# EAGLE schematic oresat-backplane (EAGLE 9.1.3)

## Sheet 1 of 20: Slot 1
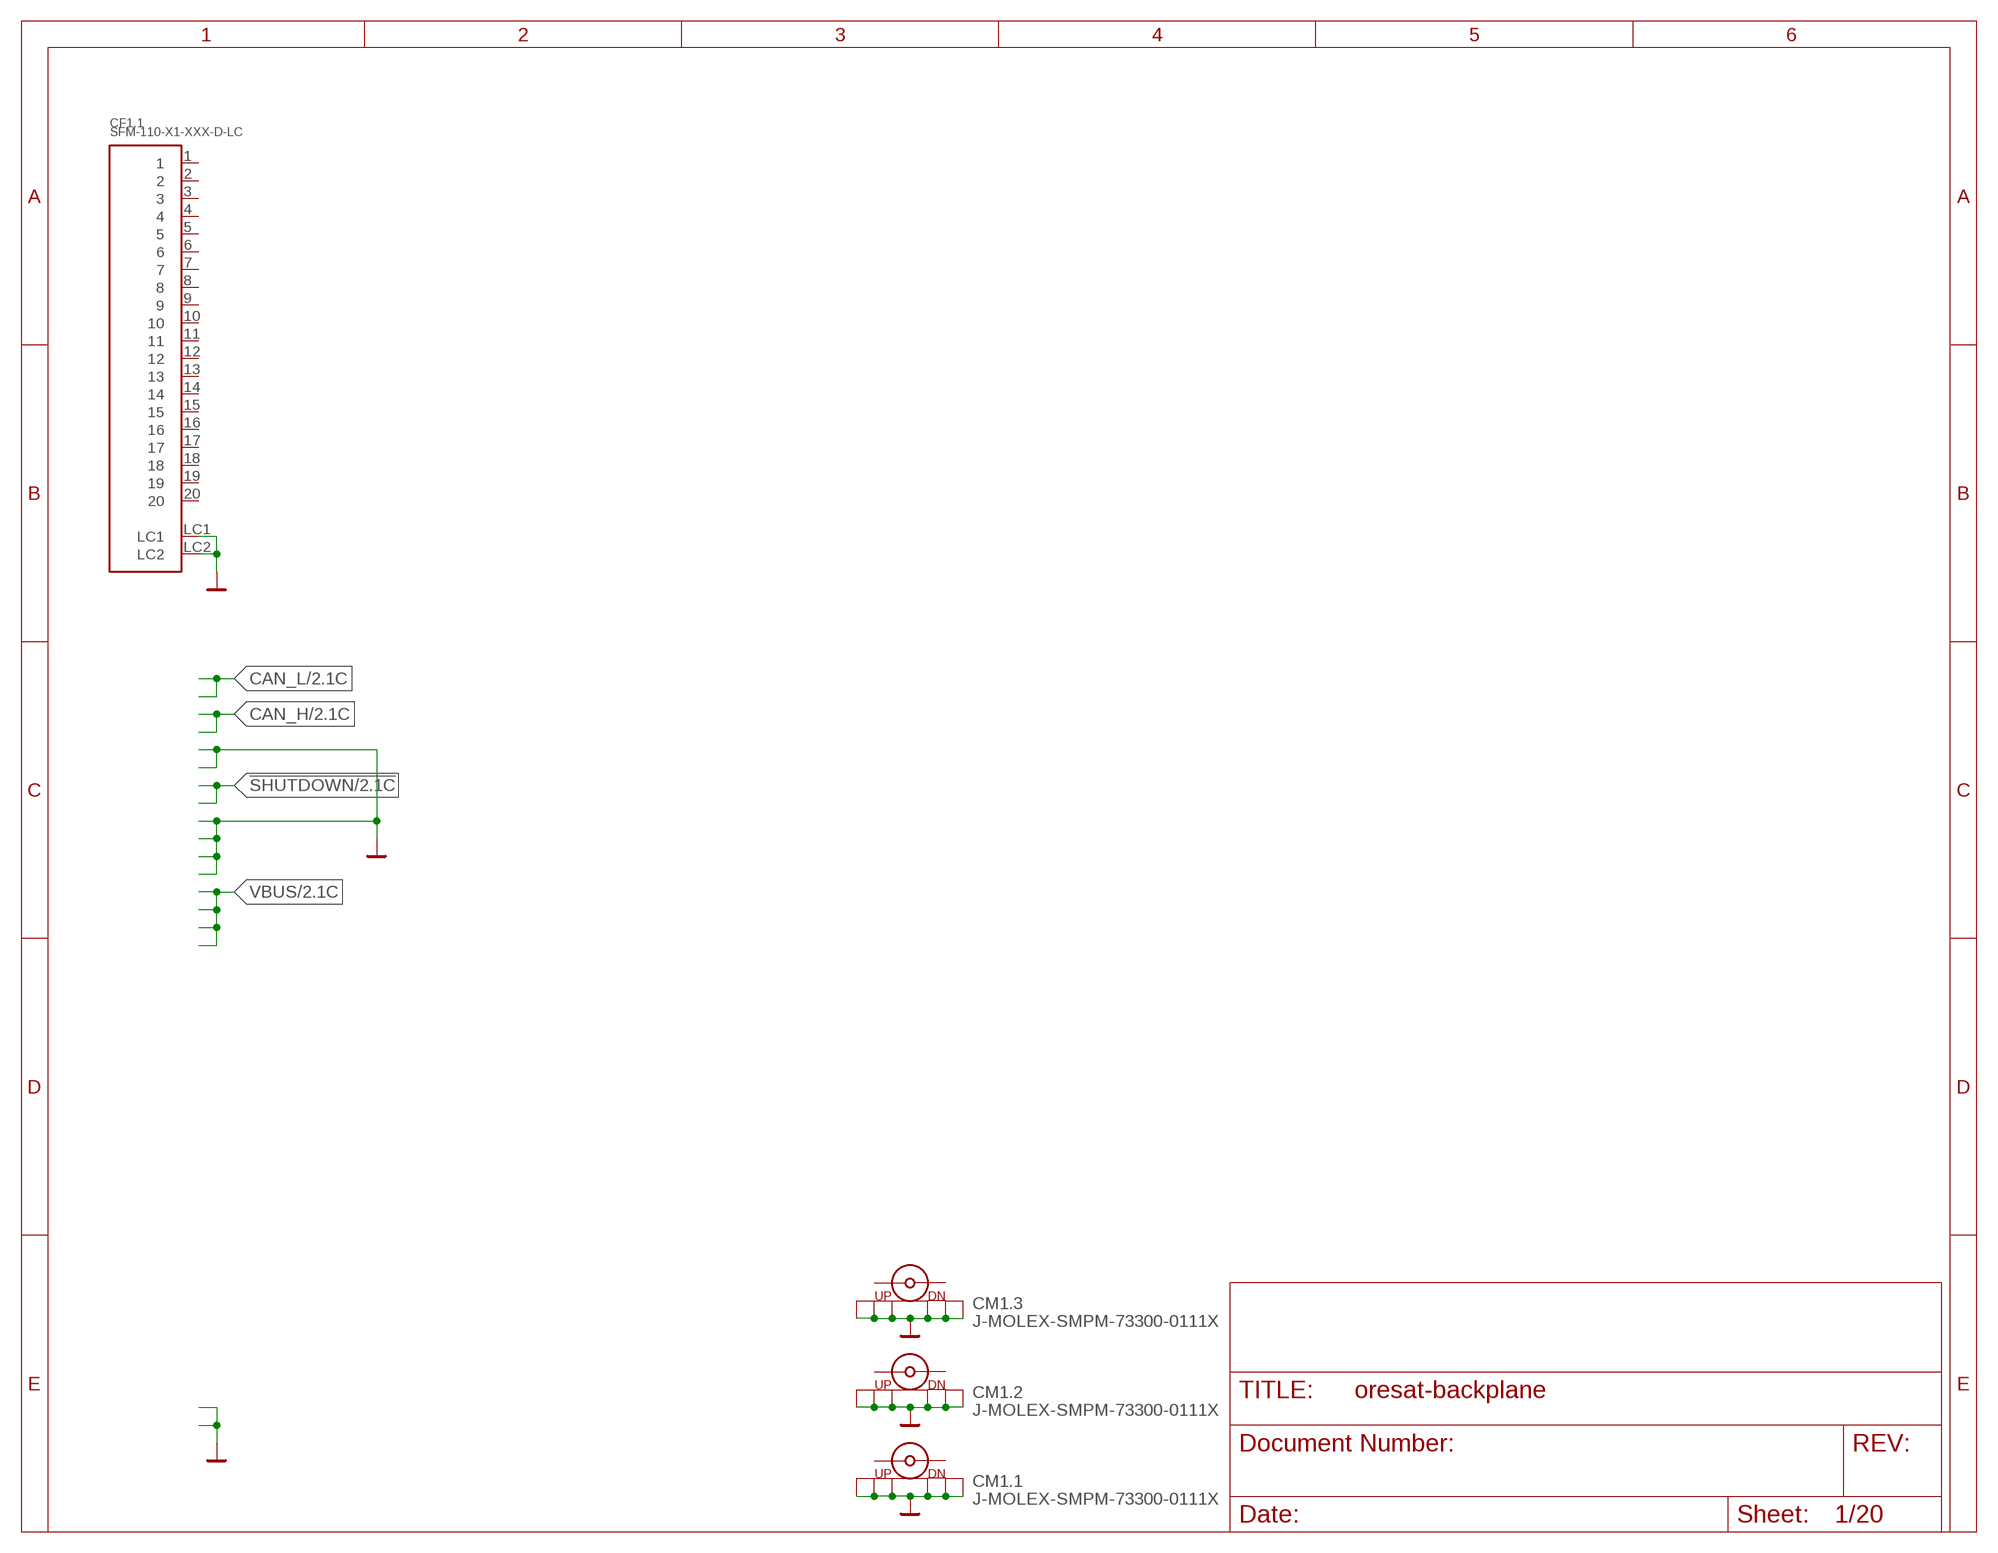
[diagram p0: schematic, sheet 1]

### Parts
CF1.1  SFM-110-X1-XXX-D-LC  [SFM-110-X1-XXX-D-LC]
CM1.1  J-MOLEX-SMPM-73300-0111X  [J-MOLEX-SMPM-73300-0111X]
CM1.2  J-MOLEX-SMPM-73300-0111X  [J-MOLEX-SMPM-73300-0111X]
CM1.3  J-MOLEX-SMPM-73300-0111X  [J-MOLEX-SMPM-73300-0111X]

### Nets
GND: CF1.1.LC1 CF1.1.LC2 CM1.1.P$1(SHIELD) CM1.1.P$2(SHIELD1) CM1.1.P$3(SHIELD2) CM1.1.P$4(SHIELD3) CM1.1.P$5(SHIELD5) CM1.1.P$6(SHIELD4) CM1.2.P$1(SHIELD) CM1.2.P$2(SHIELD1) CM1.2.P$3(SHIELD2) CM1.2.P$4(SHIELD3) CM1.2.P$5(SHIELD5) CM1.2.P$6(SHIELD4) CM1.3.P$1(SHIELD) CM1.3.P$2(SHIELD1) CM1.3.P$3(SHIELD2) CM1.3.P$4(SHIELD3) CM1.3.P$5(SHIELD5) CM1.3.P$6(SHIELD4) ; also sheet 2,3,4,5,6,7,8,9,10,11,12,13,14,15,16,17,18,19,20
Unconnected: CF1.1.1 CF1.1.2 CF1.1.3 CF1.1.4 CF1.1.5 CF1.1.6 CF1.1.7 CF1.1.8 CF1.1.9 CF1.1.10 CF1.1.11 CF1.1.12 CF1.1.13 CF1.1.14 CF1.1.15 CF1.1.16 CF1.1.17 CF1.1.18 CF1.1.19 CF1.1.20 CM1.1.RF-DOWN CM1.1.RF-UP CM1.2.RF-DOWN CM1.2.RF-UP CM1.3.RF-DOWN CM1.3.RF-UP

## Sheet 2 of 20: Slot 2
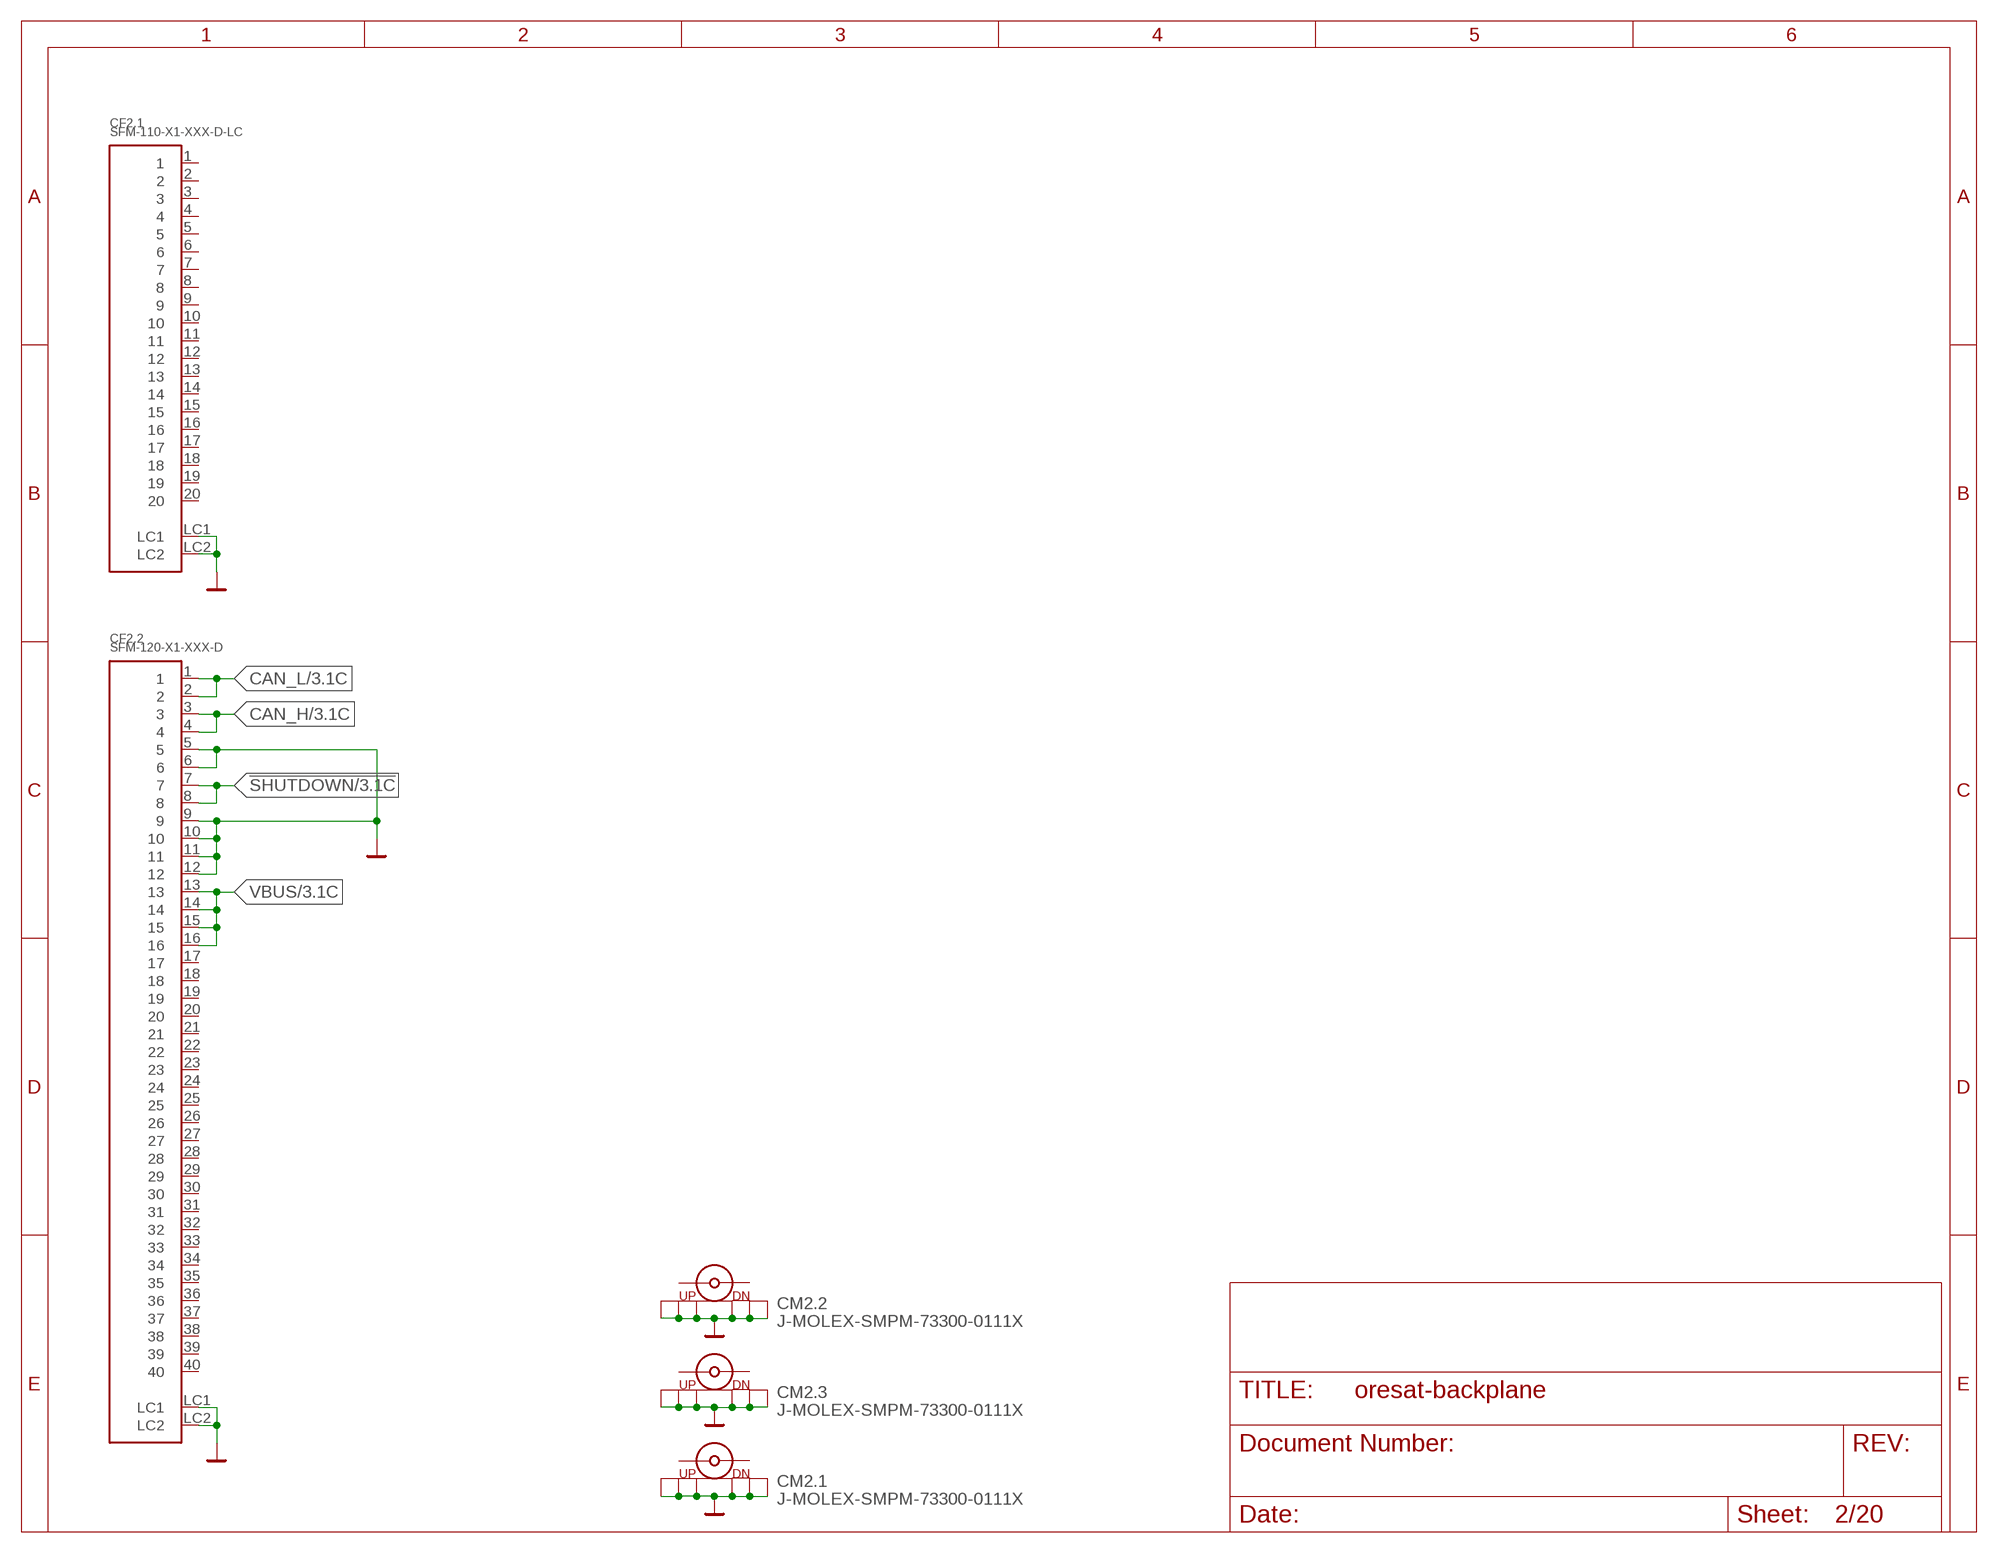
[diagram p1: schematic, sheet 2]

### Parts
CF2.1  SFM-110-X1-XXX-D-LC  [SFM-110-X1-XXX-D-LC]
CF2.2  SFM-120-X1-XXX-D  [SFM-120-X1-XXX-D]
CM2.1  J-MOLEX-SMPM-73300-0111X  [J-MOLEX-SMPM-73300-0111X]
CM2.2  J-MOLEX-SMPM-73300-0111X  [J-MOLEX-SMPM-73300-0111X]
CM2.3  J-MOLEX-SMPM-73300-0111X  [J-MOLEX-SMPM-73300-0111X]

### Nets
!SHUTDOWN: CF2.2.7 CF2.2.8 ; also sheet 1,3,4,5,6,7,8,9,10,11,12,13,14,15,16,17,18,19,20
CAN_H: CF2.2.3 CF2.2.4 ; also sheet 1,3,4,5,6,7,8,9,10,11,12,13,14,15,16,17,18,19,20
CAN_L: CF2.2.1 CF2.2.2 ; also sheet 1,3,4,5,6,7,8,9,10,11,12,13,14,15,16,17,18,19,20
GND: CF2.1.LC1 CF2.1.LC2 CF2.2.5 CF2.2.6 CF2.2.9 CF2.2.10 CF2.2.11 CF2.2.12 CF2.2.LC1 CF2.2.LC2 CM2.1.P$1(SHIELD) CM2.1.P$2(SHIELD1) CM2.1.P$3(SHIELD2) CM2.1.P$4(SHIELD3) CM2.1.P$5(SHIELD5) CM2.1.P$6(SHIELD4) CM2.2.P$1(SHIELD) CM2.2.P$2(SHIELD1) CM2.2.P$3(SHIELD2) CM2.2.P$4(SHIELD3) CM2.2.P$5(SHIELD5) CM2.2.P$6(SHIELD4) CM2.3.P$1(SHIELD) CM2.3.P$2(SHIELD1) CM2.3.P$3(SHIELD2) CM2.3.P$4(SHIELD3) CM2.3.P$5(SHIELD5) CM2.3.P$6(SHIELD4) ; also sheet 1,3,4,5,6,7,8,9,10,11,12,13,14,15,16,17,18,19,20
VBUS: CF2.2.13 CF2.2.14 CF2.2.15 CF2.2.16 ; also sheet 1,3,4,5,6,7,8,9,10,11,12,13,14,15,16,17,18,19,20
Unconnected: CF2.1.1 CF2.1.2 CF2.1.3 CF2.1.4 CF2.1.5 CF2.1.6 CF2.1.7 CF2.1.8 CF2.1.9 CF2.1.10 CF2.1.11 CF2.1.12 CF2.1.13 CF2.1.14 CF2.1.15 CF2.1.16 CF2.1.17 CF2.1.18 CF2.1.19 CF2.1.20 CF2.2.17 CF2.2.18 CF2.2.19 CF2.2.20 CF2.2.21 CF2.2.22 CF2.2.23 CF2.2.24 CF2.2.25 CF2.2.26 CF2.2.27 CF2.2.28 CF2.2.29 CF2.2.30 CF2.2.31 CF2.2.32 CF2.2.33 CF2.2.34 CF2.2.35 CF2.2.36 CF2.2.37 CF2.2.38 CF2.2.39 CF2.2.40 CM2.1.RF-DOWN CM2.1.RF-UP CM2.2.RF-DOWN CM2.2.RF-UP CM2.3.RF-DOWN CM2.3.RF-UP

## Sheet 3 of 20: Slot 3
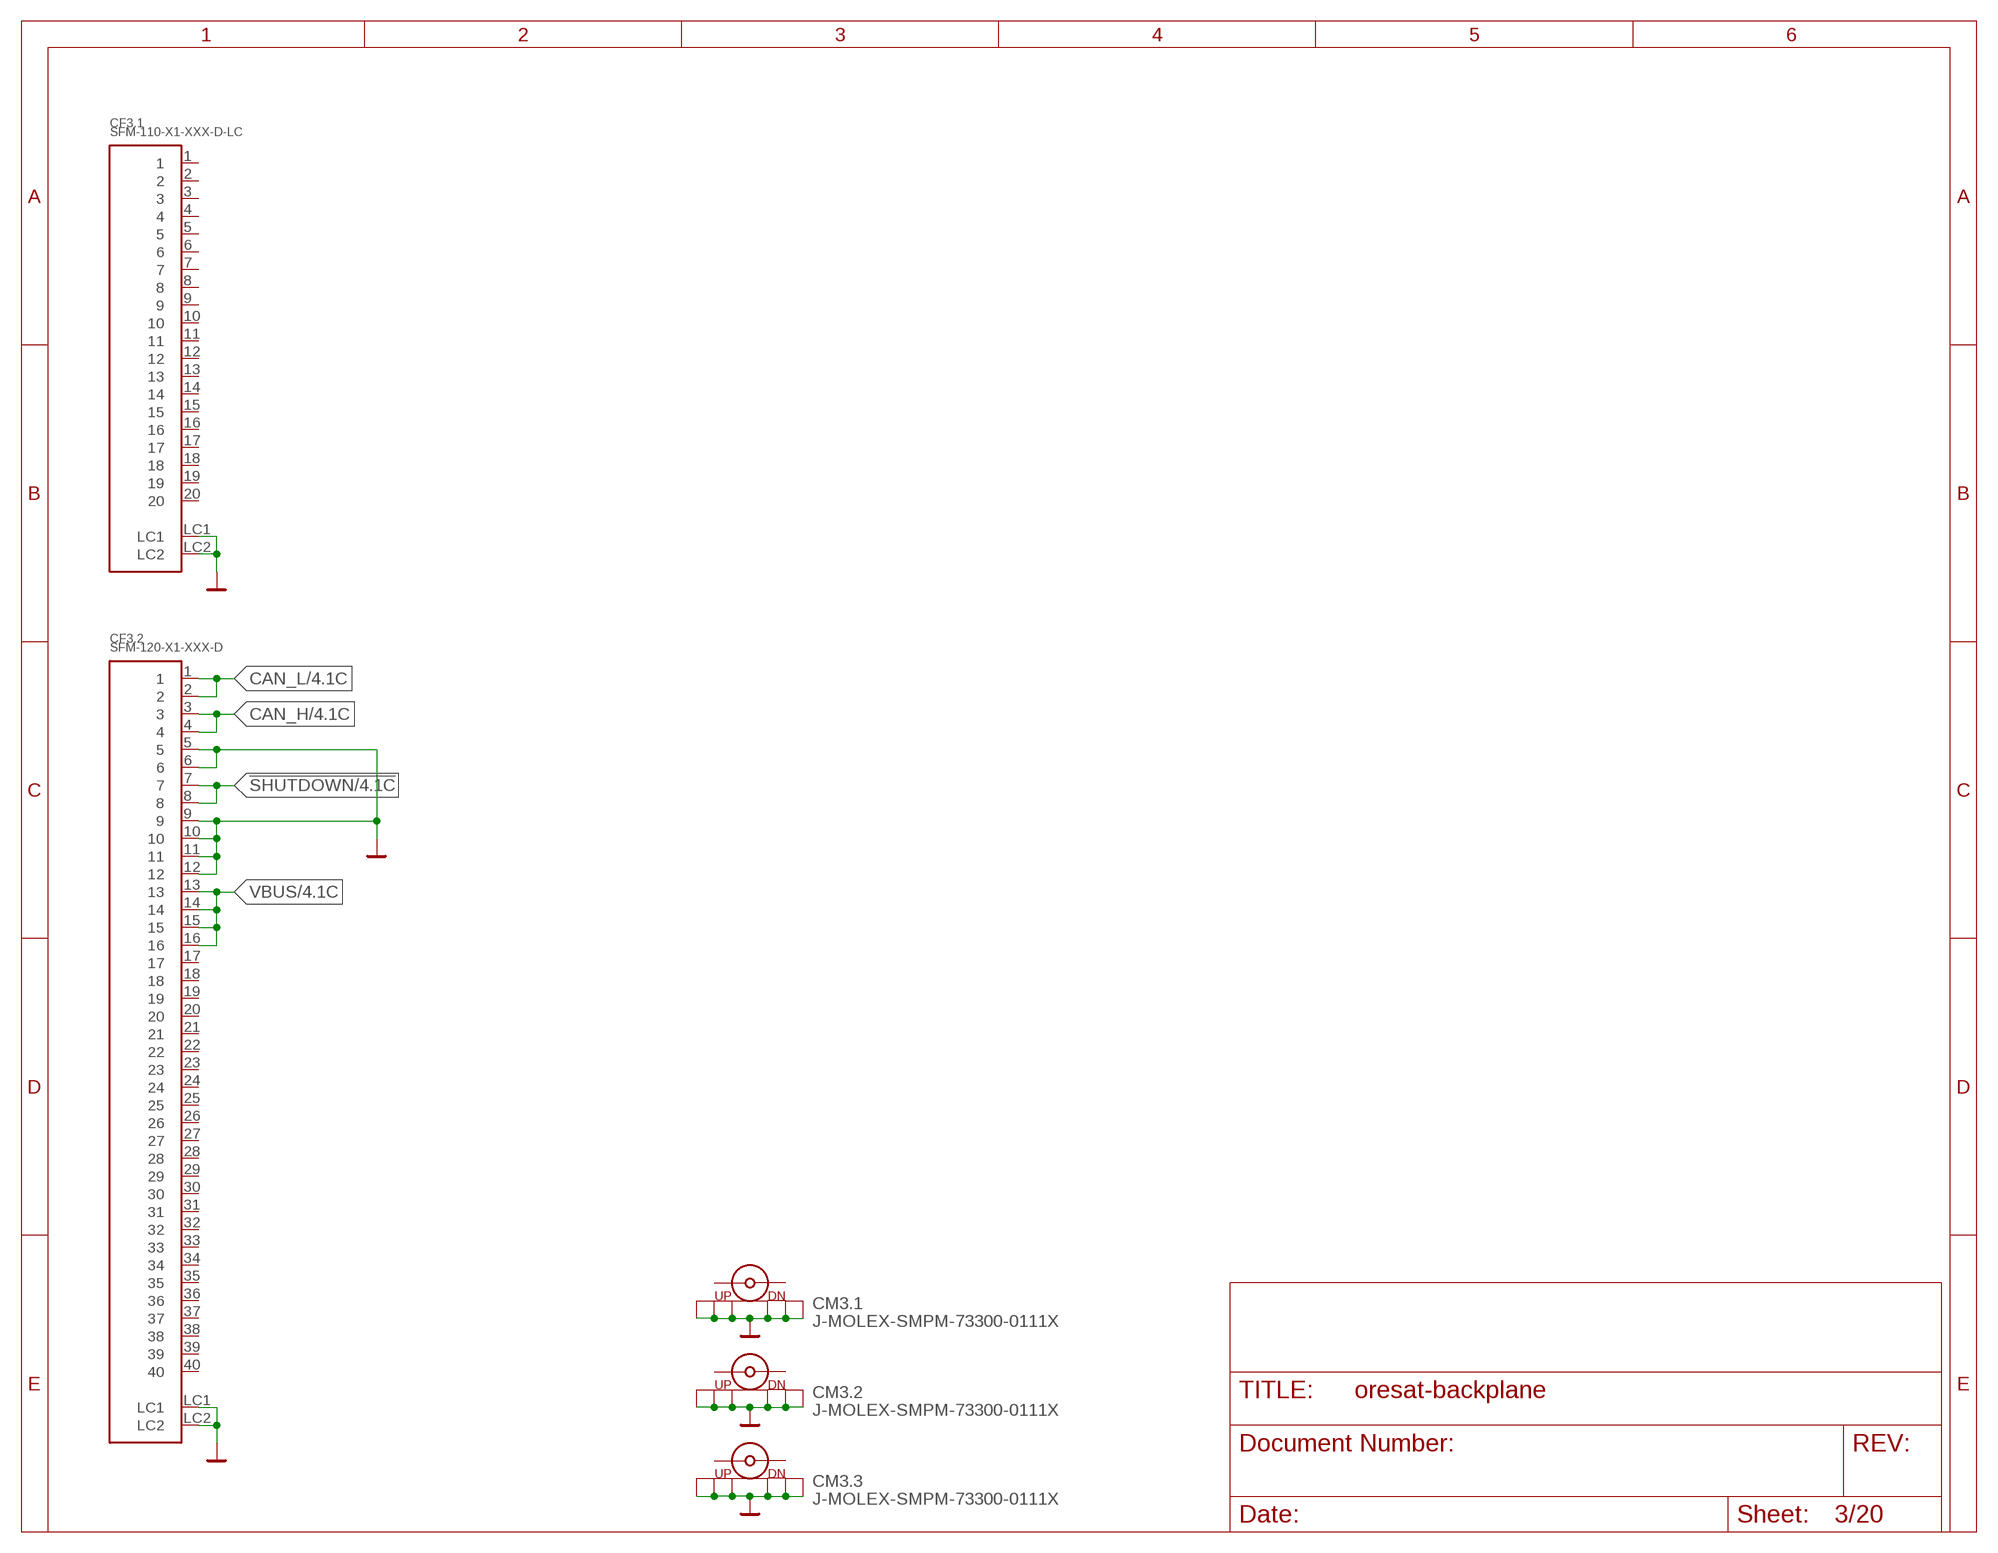
[diagram p2: schematic, sheet 3]

### Parts
CF3.1  SFM-110-X1-XXX-D-LC  [SFM-110-X1-XXX-D-LC]
CF3.2  SFM-120-X1-XXX-D  [SFM-120-X1-XXX-D]
CM3.1  J-MOLEX-SMPM-73300-0111X  [J-MOLEX-SMPM-73300-0111X]
CM3.2  J-MOLEX-SMPM-73300-0111X  [J-MOLEX-SMPM-73300-0111X]
CM3.3  J-MOLEX-SMPM-73300-0111X  [J-MOLEX-SMPM-73300-0111X]

### Nets
!SHUTDOWN: CF3.2.7 CF3.2.8 ; also sheet 1,2,4,5,6,7,8,9,10,11,12,13,14,15,16,17,18,19,20
CAN_H: CF3.2.3 CF3.2.4 ; also sheet 1,2,4,5,6,7,8,9,10,11,12,13,14,15,16,17,18,19,20
CAN_L: CF3.2.1 CF3.2.2 ; also sheet 1,2,4,5,6,7,8,9,10,11,12,13,14,15,16,17,18,19,20
GND: CF3.1.LC1 CF3.1.LC2 CF3.2.5 CF3.2.6 CF3.2.9 CF3.2.10 CF3.2.11 CF3.2.12 CF3.2.LC1 CF3.2.LC2 CM3.1.P$1(SHIELD) CM3.1.P$2(SHIELD1) CM3.1.P$3(SHIELD2) CM3.1.P$4(SHIELD3) CM3.1.P$5(SHIELD5) CM3.1.P$6(SHIELD4) CM3.2.P$1(SHIELD) CM3.2.P$2(SHIELD1) CM3.2.P$3(SHIELD2) CM3.2.P$4(SHIELD3) CM3.2.P$5(SHIELD5) CM3.2.P$6(SHIELD4) CM3.3.P$1(SHIELD) CM3.3.P$2(SHIELD1) CM3.3.P$3(SHIELD2) CM3.3.P$4(SHIELD3) CM3.3.P$5(SHIELD5) CM3.3.P$6(SHIELD4) ; also sheet 1,2,4,5,6,7,8,9,10,11,12,13,14,15,16,17,18,19,20
VBUS: CF3.2.13 CF3.2.14 CF3.2.15 CF3.2.16 ; also sheet 1,2,4,5,6,7,8,9,10,11,12,13,14,15,16,17,18,19,20
Unconnected: CF3.1.1 CF3.1.2 CF3.1.3 CF3.1.4 CF3.1.5 CF3.1.6 CF3.1.7 CF3.1.8 CF3.1.9 CF3.1.10 CF3.1.11 CF3.1.12 CF3.1.13 CF3.1.14 CF3.1.15 CF3.1.16 CF3.1.17 CF3.1.18 CF3.1.19 CF3.1.20 CF3.2.17 CF3.2.18 CF3.2.19 CF3.2.20 CF3.2.21 CF3.2.22 CF3.2.23 CF3.2.24 CF3.2.25 CF3.2.26 CF3.2.27 CF3.2.28 CF3.2.29 CF3.2.30 CF3.2.31 CF3.2.32 CF3.2.33 CF3.2.34 CF3.2.35 CF3.2.36 CF3.2.37 CF3.2.38 CF3.2.39 CF3.2.40 CM3.1.RF-DOWN CM3.1.RF-UP CM3.2.RF-DOWN CM3.2.RF-UP CM3.3.RF-DOWN CM3.3.RF-UP

## Sheet 4 of 20: Slot 4
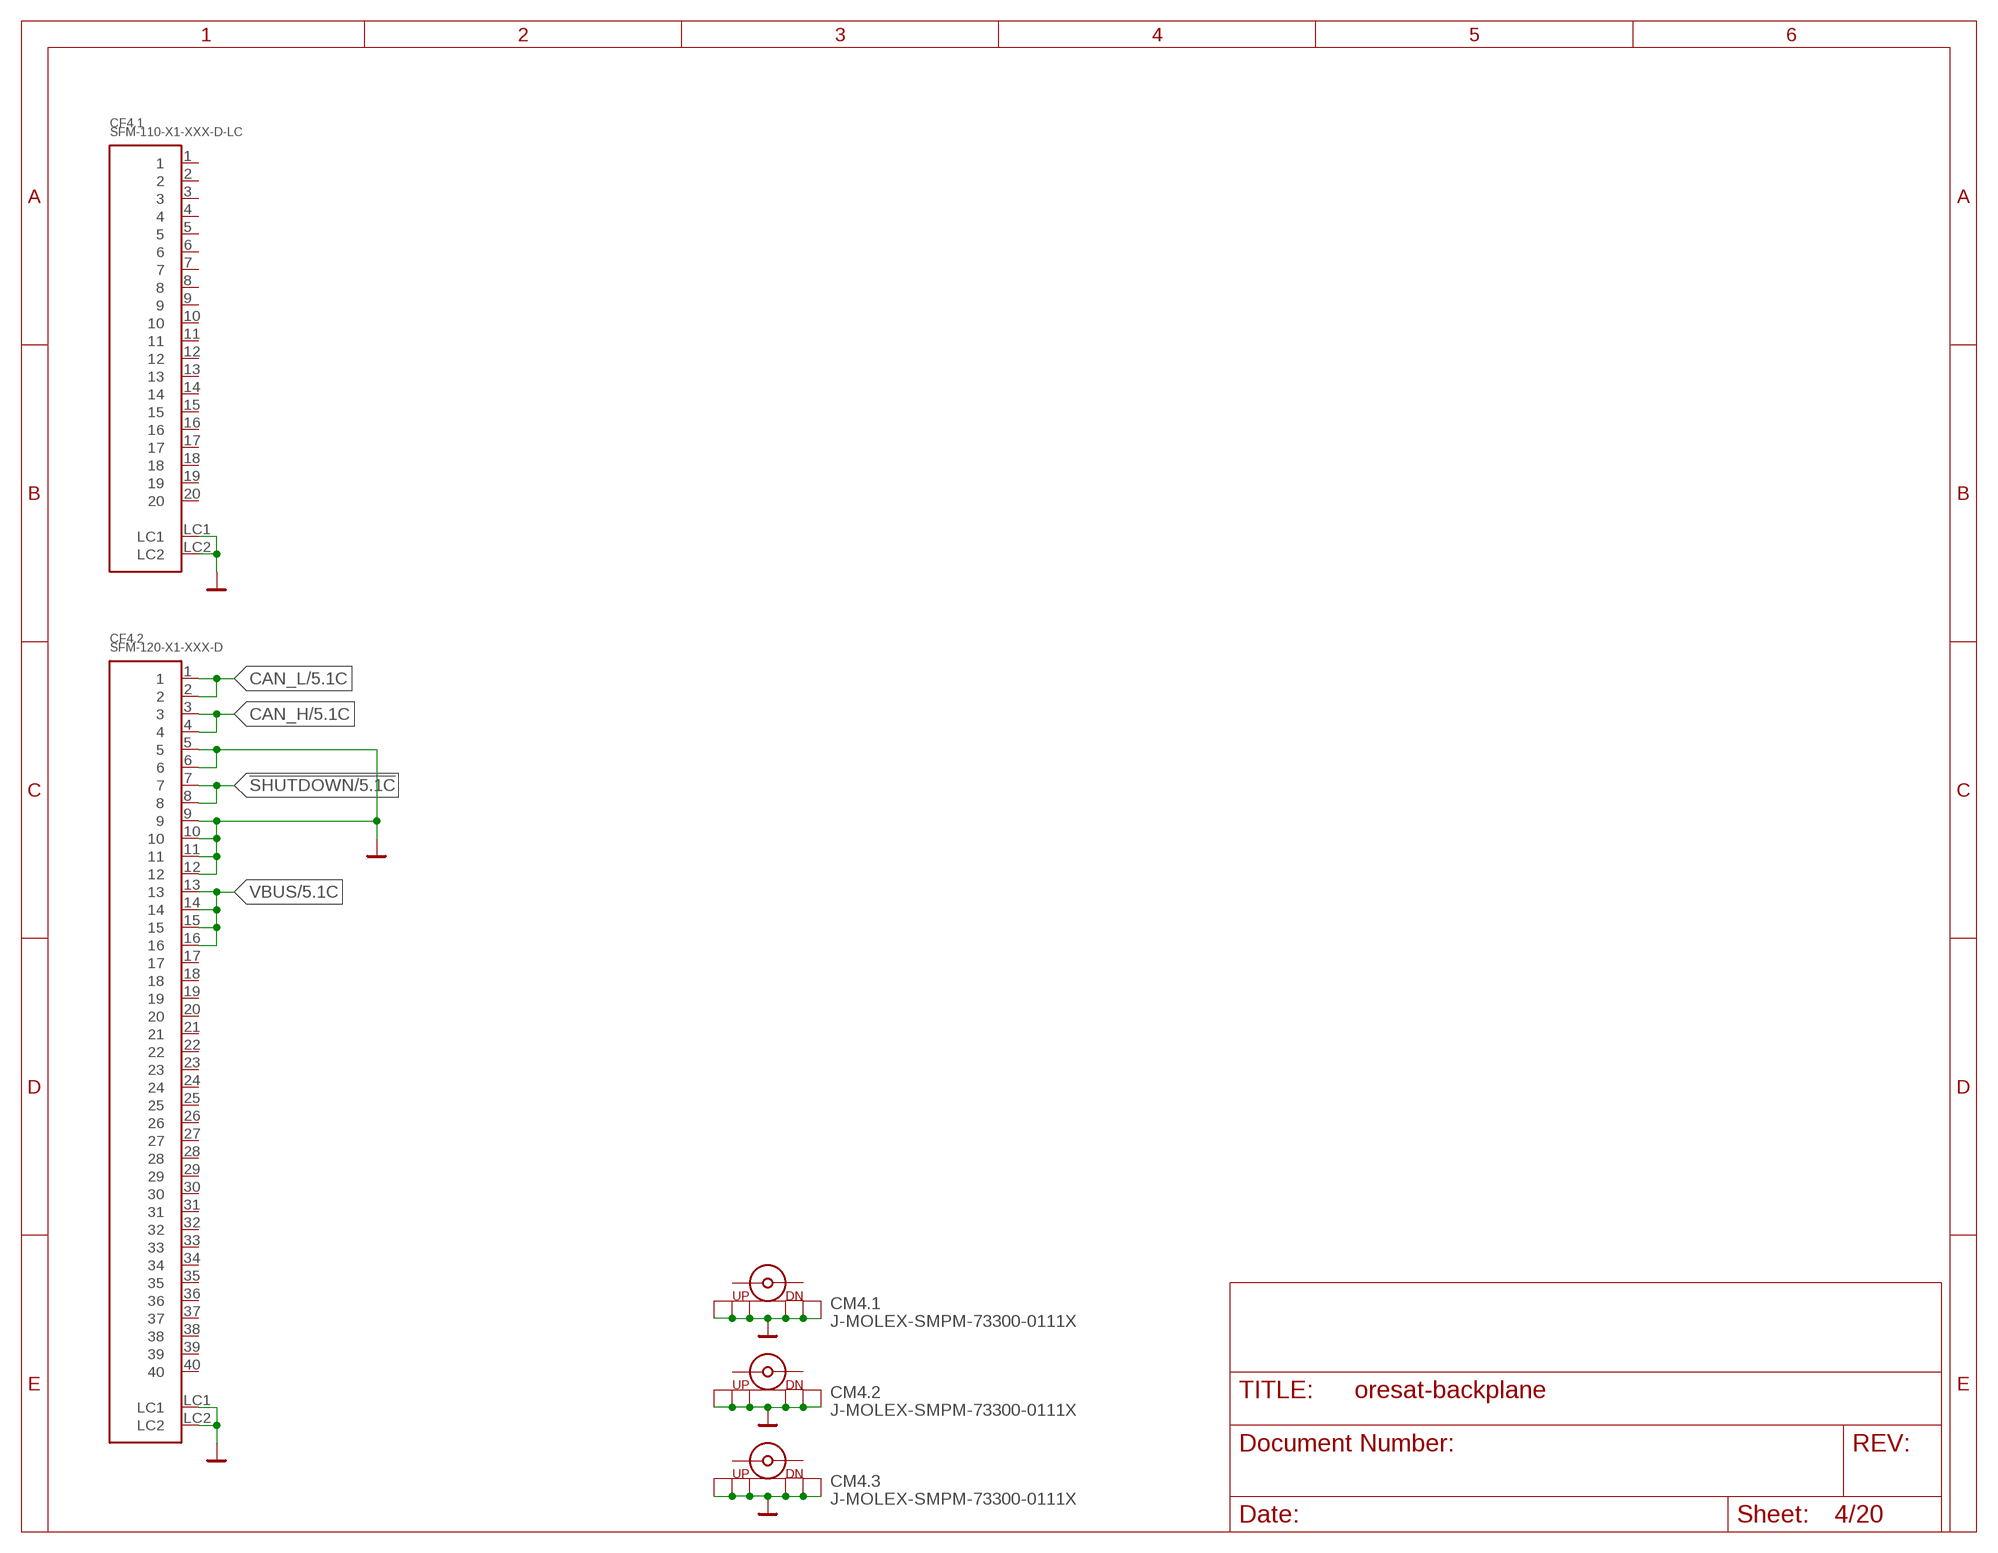
[diagram p3: schematic, sheet 4]

### Parts
CF4.1  SFM-110-X1-XXX-D-LC  [SFM-110-X1-XXX-D-LC]
CF4.2  SFM-120-X1-XXX-D  [SFM-120-X1-XXX-D]
CM4.1  J-MOLEX-SMPM-73300-0111X  [J-MOLEX-SMPM-73300-0111X]
CM4.2  J-MOLEX-SMPM-73300-0111X  [J-MOLEX-SMPM-73300-0111X]
CM4.3  J-MOLEX-SMPM-73300-0111X  [J-MOLEX-SMPM-73300-0111X]

### Nets
!SHUTDOWN: CF4.2.7 CF4.2.8 ; also sheet 1,2,3,5,6,7,8,9,10,11,12,13,14,15,16,17,18,19,20
CAN_H: CF4.2.3 CF4.2.4 ; also sheet 1,2,3,5,6,7,8,9,10,11,12,13,14,15,16,17,18,19,20
CAN_L: CF4.2.1 CF4.2.2 ; also sheet 1,2,3,5,6,7,8,9,10,11,12,13,14,15,16,17,18,19,20
GND: CF4.1.LC1 CF4.1.LC2 CF4.2.5 CF4.2.6 CF4.2.9 CF4.2.10 CF4.2.11 CF4.2.12 CF4.2.LC1 CF4.2.LC2 CM4.1.P$1(SHIELD) CM4.1.P$2(SHIELD1) CM4.1.P$3(SHIELD2) CM4.1.P$4(SHIELD3) CM4.1.P$5(SHIELD5) CM4.1.P$6(SHIELD4) CM4.2.P$1(SHIELD) CM4.2.P$2(SHIELD1) CM4.2.P$3(SHIELD2) CM4.2.P$4(SHIELD3) CM4.2.P$5(SHIELD5) CM4.2.P$6(SHIELD4) CM4.3.P$1(SHIELD) CM4.3.P$2(SHIELD1) CM4.3.P$3(SHIELD2) CM4.3.P$4(SHIELD3) CM4.3.P$5(SHIELD5) CM4.3.P$6(SHIELD4) ; also sheet 1,2,3,5,6,7,8,9,10,11,12,13,14,15,16,17,18,19,20
VBUS: CF4.2.13 CF4.2.14 CF4.2.15 CF4.2.16 ; also sheet 1,2,3,5,6,7,8,9,10,11,12,13,14,15,16,17,18,19,20
Unconnected: CF4.1.1 CF4.1.2 CF4.1.3 CF4.1.4 CF4.1.5 CF4.1.6 CF4.1.7 CF4.1.8 CF4.1.9 CF4.1.10 CF4.1.11 CF4.1.12 CF4.1.13 CF4.1.14 CF4.1.15 CF4.1.16 CF4.1.17 CF4.1.18 CF4.1.19 CF4.1.20 CF4.2.17 CF4.2.18 CF4.2.19 CF4.2.20 CF4.2.21 CF4.2.22 CF4.2.23 CF4.2.24 CF4.2.25 CF4.2.26 CF4.2.27 CF4.2.28 CF4.2.29 CF4.2.30 CF4.2.31 CF4.2.32 CF4.2.33 CF4.2.34 CF4.2.35 CF4.2.36 CF4.2.37 CF4.2.38 CF4.2.39 CF4.2.40 CM4.1.RF-DOWN CM4.1.RF-UP CM4.2.RF-DOWN CM4.2.RF-UP CM4.3.RF-DOWN CM4.3.RF-UP

## Sheet 5 of 20: Slot 5
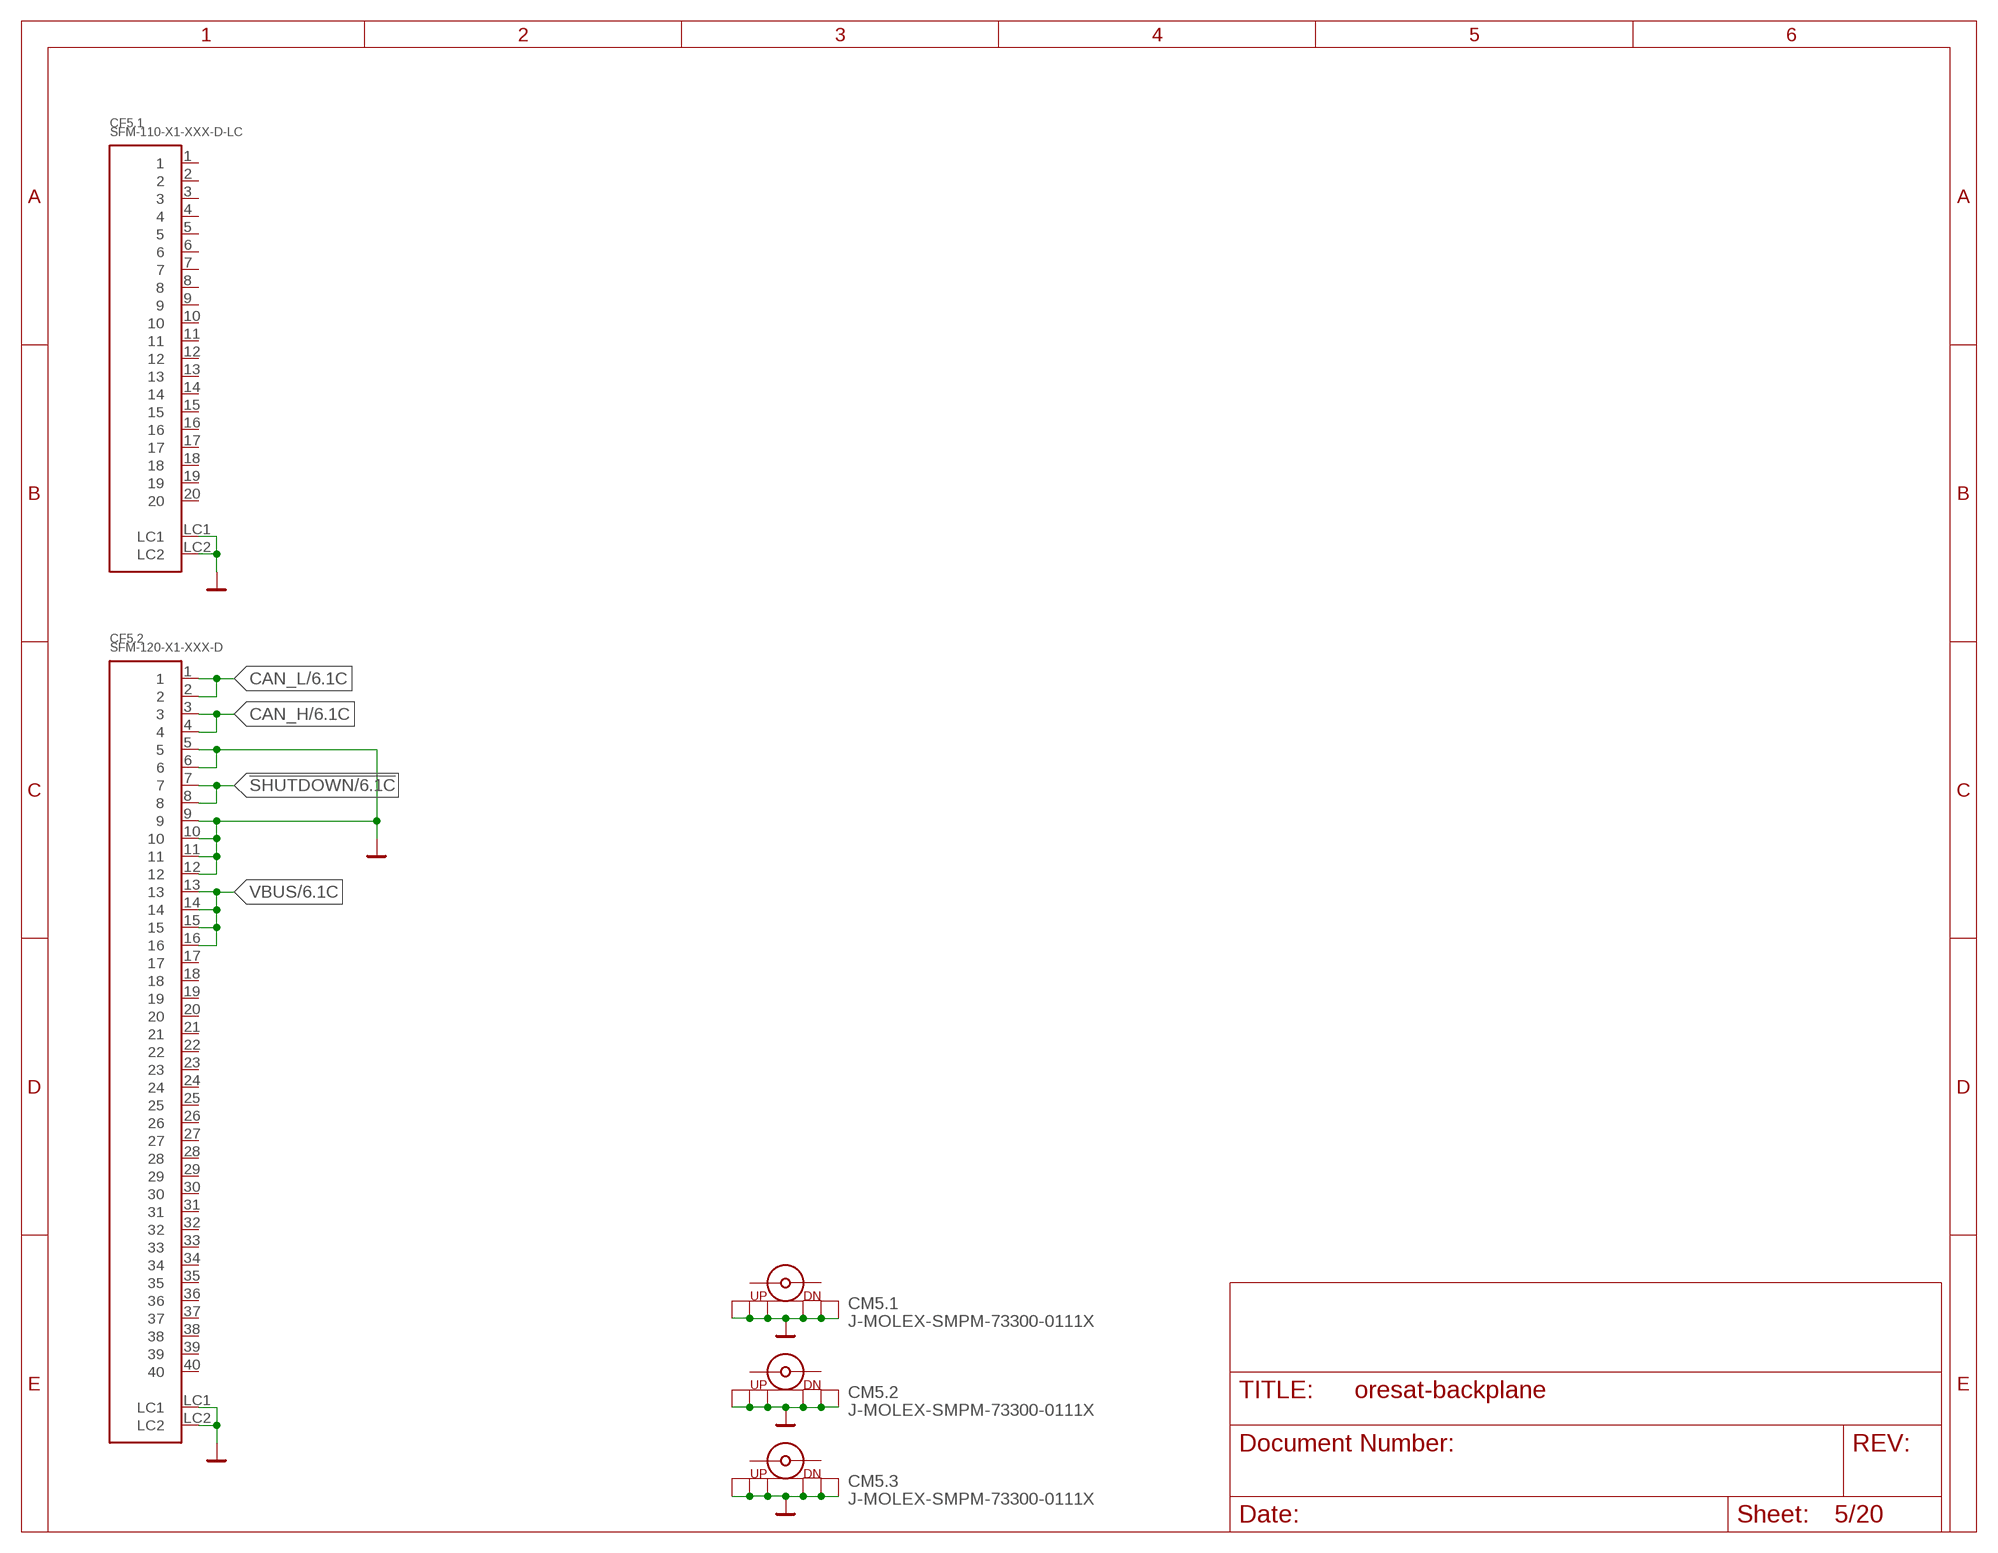
[diagram p4: schematic, sheet 5]

### Parts
CF5.1  SFM-110-X1-XXX-D-LC  [SFM-110-X1-XXX-D-LC]
CF5.2  SFM-120-X1-XXX-D  [SFM-120-X1-XXX-D]
CM5.1  J-MOLEX-SMPM-73300-0111X  [J-MOLEX-SMPM-73300-0111X]
CM5.2  J-MOLEX-SMPM-73300-0111X  [J-MOLEX-SMPM-73300-0111X]
CM5.3  J-MOLEX-SMPM-73300-0111X  [J-MOLEX-SMPM-73300-0111X]

### Nets
!SHUTDOWN: CF5.2.7 CF5.2.8 ; also sheet 1,2,3,4,6,7,8,9,10,11,12,13,14,15,16,17,18,19,20
CAN_H: CF5.2.3 CF5.2.4 ; also sheet 1,2,3,4,6,7,8,9,10,11,12,13,14,15,16,17,18,19,20
CAN_L: CF5.2.1 CF5.2.2 ; also sheet 1,2,3,4,6,7,8,9,10,11,12,13,14,15,16,17,18,19,20
GND: CF5.1.LC1 CF5.1.LC2 CF5.2.5 CF5.2.6 CF5.2.9 CF5.2.10 CF5.2.11 CF5.2.12 CF5.2.LC1 CF5.2.LC2 CM5.1.P$1(SHIELD) CM5.1.P$2(SHIELD1) CM5.1.P$3(SHIELD2) CM5.1.P$4(SHIELD3) CM5.1.P$5(SHIELD5) CM5.1.P$6(SHIELD4) CM5.2.P$1(SHIELD) CM5.2.P$2(SHIELD1) CM5.2.P$3(SHIELD2) CM5.2.P$4(SHIELD3) CM5.2.P$5(SHIELD5) CM5.2.P$6(SHIELD4) CM5.3.P$1(SHIELD) CM5.3.P$2(SHIELD1) CM5.3.P$3(SHIELD2) CM5.3.P$4(SHIELD3) CM5.3.P$5(SHIELD5) CM5.3.P$6(SHIELD4) ; also sheet 1,2,3,4,6,7,8,9,10,11,12,13,14,15,16,17,18,19,20
VBUS: CF5.2.13 CF5.2.14 CF5.2.15 CF5.2.16 ; also sheet 1,2,3,4,6,7,8,9,10,11,12,13,14,15,16,17,18,19,20
Unconnected: CF5.1.1 CF5.1.2 CF5.1.3 CF5.1.4 CF5.1.5 CF5.1.6 CF5.1.7 CF5.1.8 CF5.1.9 CF5.1.10 CF5.1.11 CF5.1.12 CF5.1.13 CF5.1.14 CF5.1.15 CF5.1.16 CF5.1.17 CF5.1.18 CF5.1.19 CF5.1.20 CF5.2.17 CF5.2.18 CF5.2.19 CF5.2.20 CF5.2.21 CF5.2.22 CF5.2.23 CF5.2.24 CF5.2.25 CF5.2.26 CF5.2.27 CF5.2.28 CF5.2.29 CF5.2.30 CF5.2.31 CF5.2.32 CF5.2.33 CF5.2.34 CF5.2.35 CF5.2.36 CF5.2.37 CF5.2.38 CF5.2.39 CF5.2.40 CM5.1.RF-DOWN CM5.1.RF-UP CM5.2.RF-DOWN CM5.2.RF-UP CM5.3.RF-DOWN CM5.3.RF-UP

## Sheet 6 of 20: Slot 6
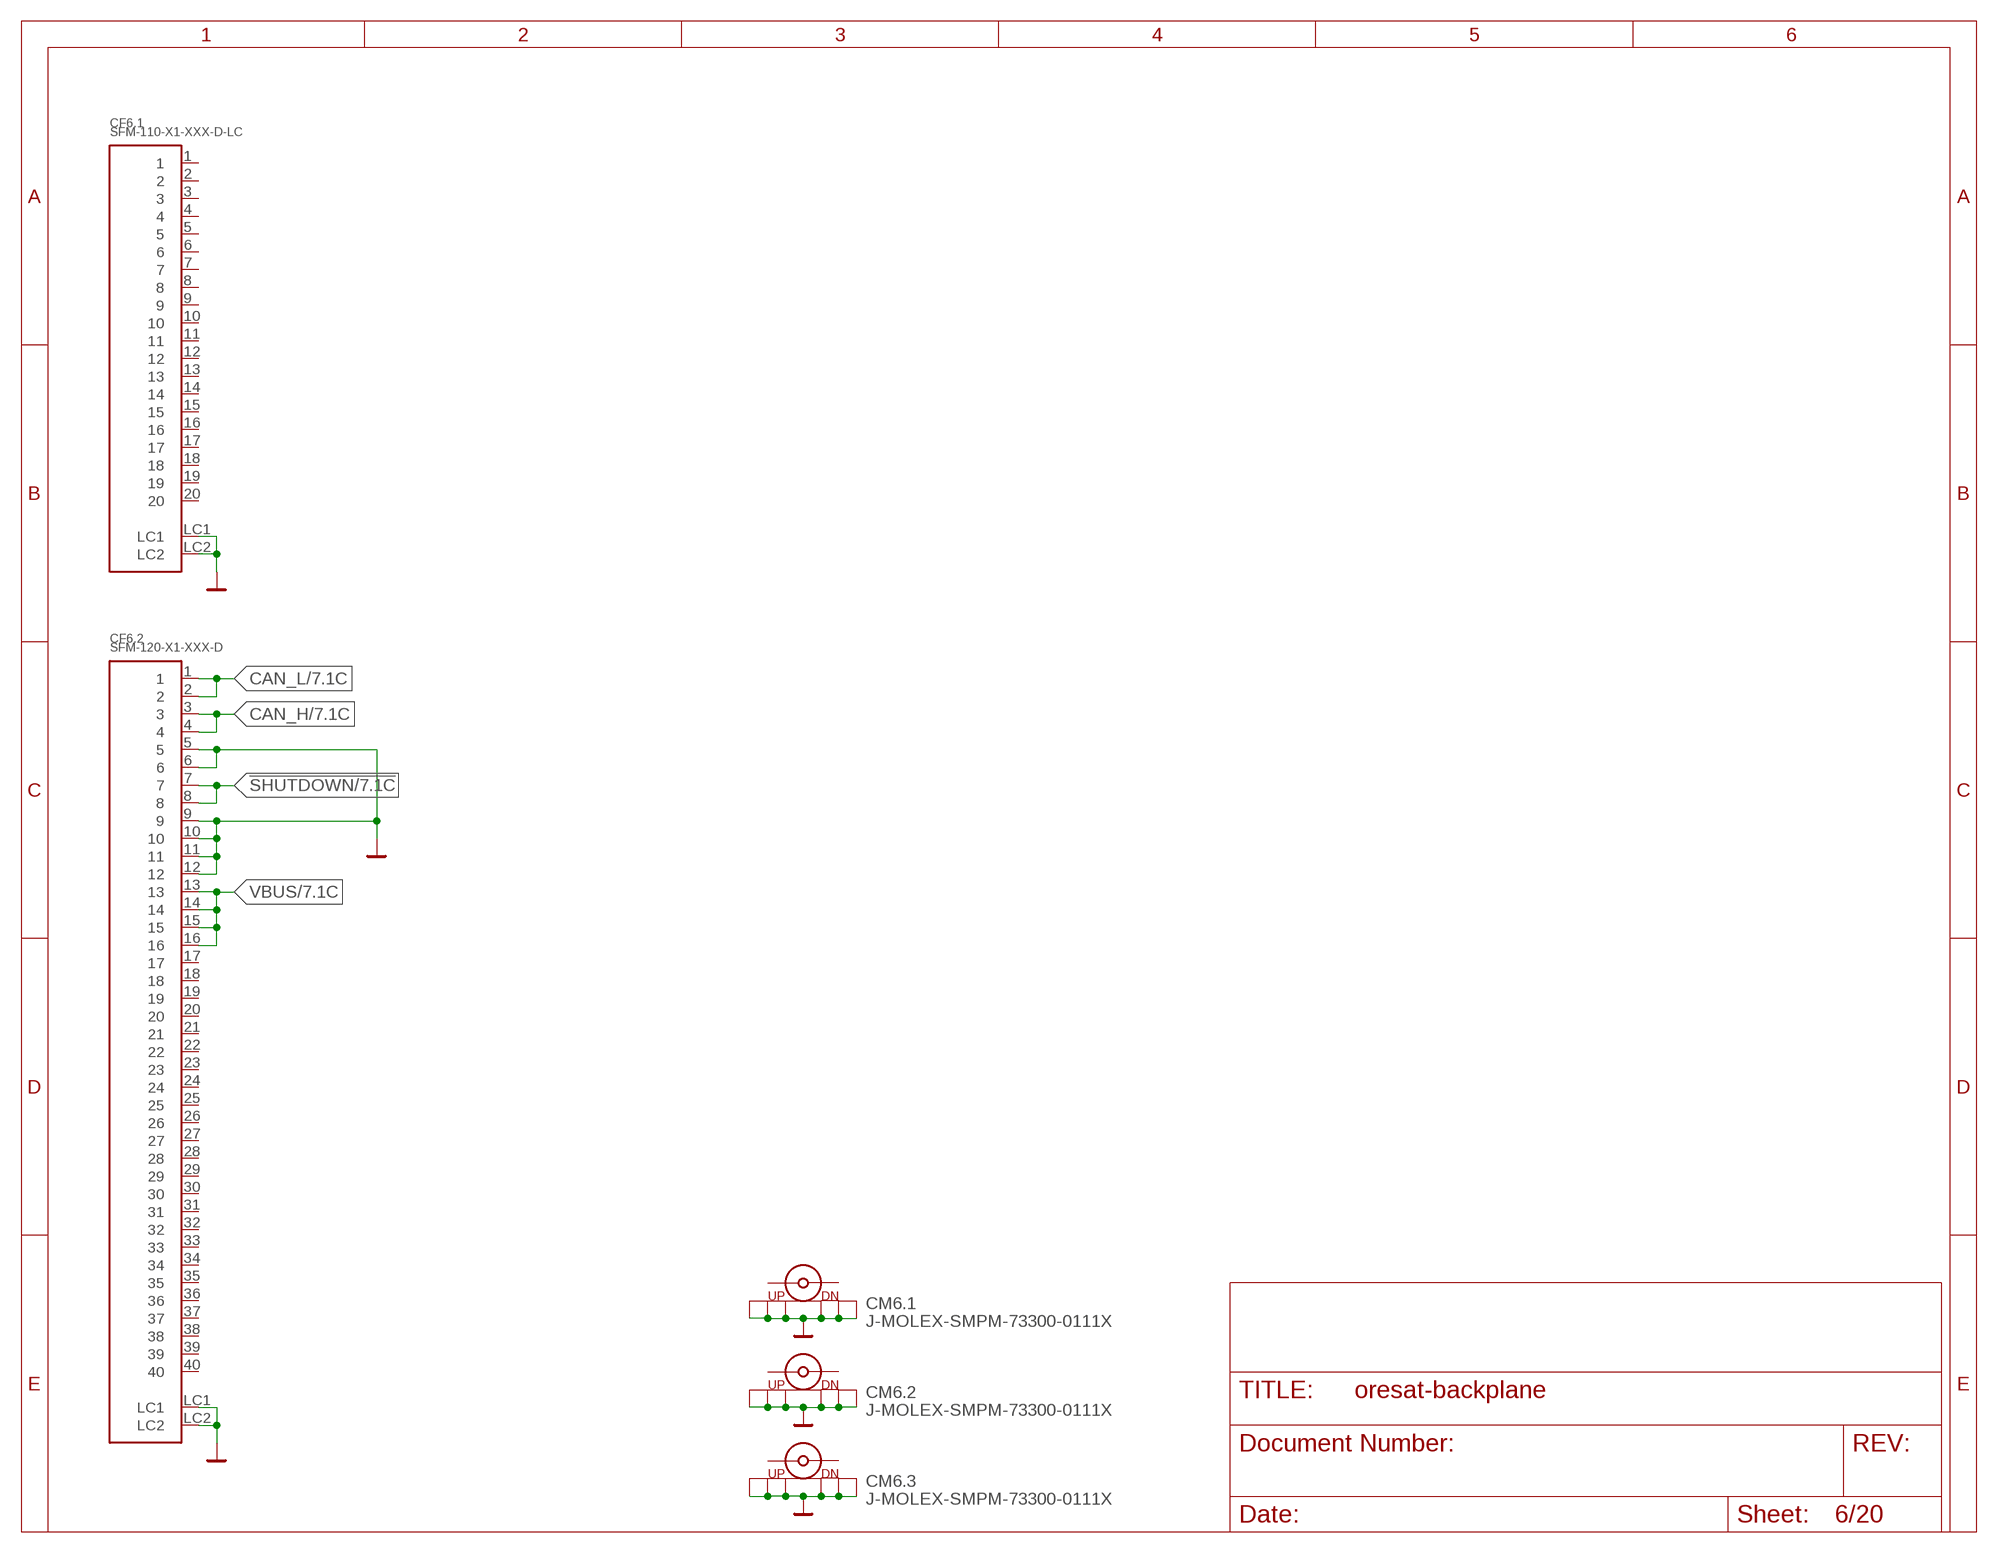
[diagram p5: schematic, sheet 6]

### Parts
CF6.1  SFM-110-X1-XXX-D-LC  [SFM-110-X1-XXX-D-LC]
CF6.2  SFM-120-X1-XXX-D  [SFM-120-X1-XXX-D]
CM6.1  J-MOLEX-SMPM-73300-0111X  [J-MOLEX-SMPM-73300-0111X]
CM6.2  J-MOLEX-SMPM-73300-0111X  [J-MOLEX-SMPM-73300-0111X]
CM6.3  J-MOLEX-SMPM-73300-0111X  [J-MOLEX-SMPM-73300-0111X]

### Nets
!SHUTDOWN: CF6.2.7 CF6.2.8 ; also sheet 1,2,3,4,5,7,8,9,10,11,12,13,14,15,16,17,18,19,20
CAN_H: CF6.2.3 CF6.2.4 ; also sheet 1,2,3,4,5,7,8,9,10,11,12,13,14,15,16,17,18,19,20
CAN_L: CF6.2.1 CF6.2.2 ; also sheet 1,2,3,4,5,7,8,9,10,11,12,13,14,15,16,17,18,19,20
GND: CF6.1.LC1 CF6.1.LC2 CF6.2.5 CF6.2.6 CF6.2.9 CF6.2.10 CF6.2.11 CF6.2.12 CF6.2.LC1 CF6.2.LC2 CM6.1.P$1(SHIELD) CM6.1.P$2(SHIELD1) CM6.1.P$3(SHIELD2) CM6.1.P$4(SHIELD3) CM6.1.P$5(SHIELD5) CM6.1.P$6(SHIELD4) CM6.2.P$1(SHIELD) CM6.2.P$2(SHIELD1) CM6.2.P$3(SHIELD2) CM6.2.P$4(SHIELD3) CM6.2.P$5(SHIELD5) CM6.2.P$6(SHIELD4) CM6.3.P$1(SHIELD) CM6.3.P$2(SHIELD1) CM6.3.P$3(SHIELD2) CM6.3.P$4(SHIELD3) CM6.3.P$5(SHIELD5) CM6.3.P$6(SHIELD4) ; also sheet 1,2,3,4,5,7,8,9,10,11,12,13,14,15,16,17,18,19,20
VBUS: CF6.2.13 CF6.2.14 CF6.2.15 CF6.2.16 ; also sheet 1,2,3,4,5,7,8,9,10,11,12,13,14,15,16,17,18,19,20
Unconnected: CF6.1.1 CF6.1.2 CF6.1.3 CF6.1.4 CF6.1.5 CF6.1.6 CF6.1.7 CF6.1.8 CF6.1.9 CF6.1.10 CF6.1.11 CF6.1.12 CF6.1.13 CF6.1.14 CF6.1.15 CF6.1.16 CF6.1.17 CF6.1.18 CF6.1.19 CF6.1.20 CF6.2.17 CF6.2.18 CF6.2.19 CF6.2.20 CF6.2.21 CF6.2.22 CF6.2.23 CF6.2.24 CF6.2.25 CF6.2.26 CF6.2.27 CF6.2.28 CF6.2.29 CF6.2.30 CF6.2.31 CF6.2.32 CF6.2.33 CF6.2.34 CF6.2.35 CF6.2.36 CF6.2.37 CF6.2.38 CF6.2.39 CF6.2.40 CM6.1.RF-DOWN CM6.1.RF-UP CM6.2.RF-DOWN CM6.2.RF-UP CM6.3.RF-DOWN CM6.3.RF-UP

## Sheet 7 of 20: Slot 7
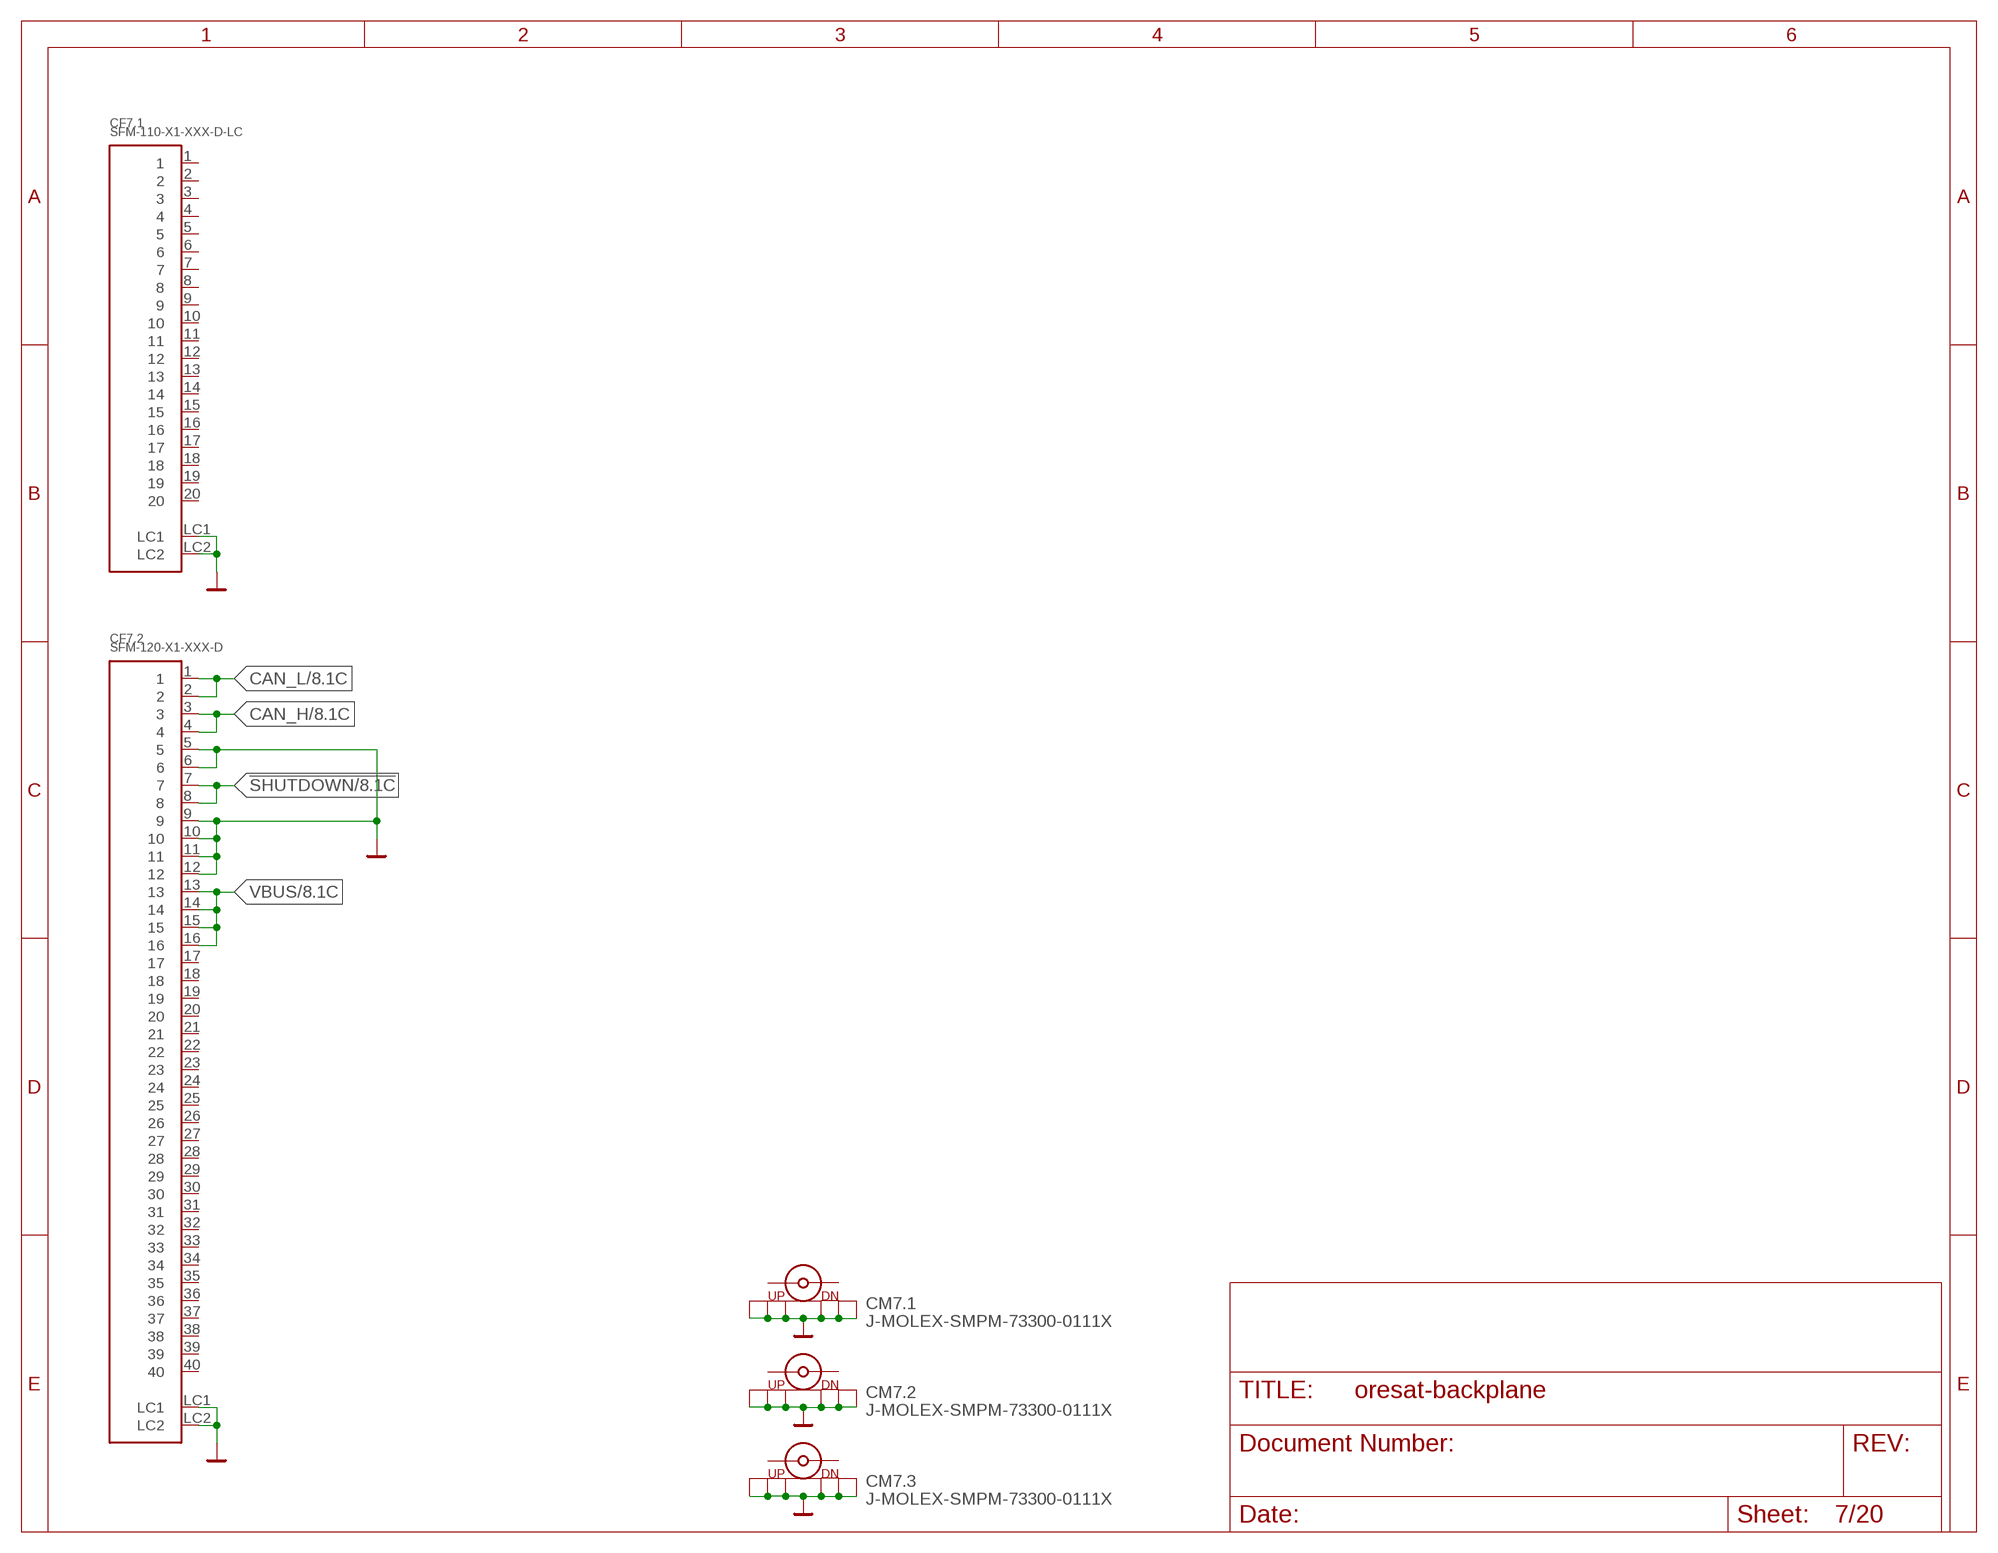
[diagram p6: schematic, sheet 7]

### Parts
CF7.1  SFM-110-X1-XXX-D-LC  [SFM-110-X1-XXX-D-LC]
CF7.2  SFM-120-X1-XXX-D  [SFM-120-X1-XXX-D]
CM7.1  J-MOLEX-SMPM-73300-0111X  [J-MOLEX-SMPM-73300-0111X]
CM7.2  J-MOLEX-SMPM-73300-0111X  [J-MOLEX-SMPM-73300-0111X]
CM7.3  J-MOLEX-SMPM-73300-0111X  [J-MOLEX-SMPM-73300-0111X]

### Nets
!SHUTDOWN: CF7.2.7 CF7.2.8 ; also sheet 1,2,3,4,5,6,8,9,10,11,12,13,14,15,16,17,18,19,20
CAN_H: CF7.2.3 CF7.2.4 ; also sheet 1,2,3,4,5,6,8,9,10,11,12,13,14,15,16,17,18,19,20
CAN_L: CF7.2.1 CF7.2.2 ; also sheet 1,2,3,4,5,6,8,9,10,11,12,13,14,15,16,17,18,19,20
GND: CF7.1.LC1 CF7.1.LC2 CF7.2.5 CF7.2.6 CF7.2.9 CF7.2.10 CF7.2.11 CF7.2.12 CF7.2.LC1 CF7.2.LC2 CM7.1.P$1(SHIELD) CM7.1.P$2(SHIELD1) CM7.1.P$3(SHIELD2) CM7.1.P$4(SHIELD3) CM7.1.P$5(SHIELD5) CM7.1.P$6(SHIELD4) CM7.2.P$1(SHIELD) CM7.2.P$2(SHIELD1) CM7.2.P$3(SHIELD2) CM7.2.P$4(SHIELD3) CM7.2.P$5(SHIELD5) CM7.2.P$6(SHIELD4) CM7.3.P$1(SHIELD) CM7.3.P$2(SHIELD1) CM7.3.P$3(SHIELD2) CM7.3.P$4(SHIELD3) CM7.3.P$5(SHIELD5) CM7.3.P$6(SHIELD4) ; also sheet 1,2,3,4,5,6,8,9,10,11,12,13,14,15,16,17,18,19,20
VBUS: CF7.2.13 CF7.2.14 CF7.2.15 CF7.2.16 ; also sheet 1,2,3,4,5,6,8,9,10,11,12,13,14,15,16,17,18,19,20
Unconnected: CF7.1.1 CF7.1.2 CF7.1.3 CF7.1.4 CF7.1.5 CF7.1.6 CF7.1.7 CF7.1.8 CF7.1.9 CF7.1.10 CF7.1.11 CF7.1.12 CF7.1.13 CF7.1.14 CF7.1.15 CF7.1.16 CF7.1.17 CF7.1.18 CF7.1.19 CF7.1.20 CF7.2.17 CF7.2.18 CF7.2.19 CF7.2.20 CF7.2.21 CF7.2.22 CF7.2.23 CF7.2.24 CF7.2.25 CF7.2.26 CF7.2.27 CF7.2.28 CF7.2.29 CF7.2.30 CF7.2.31 CF7.2.32 CF7.2.33 CF7.2.34 CF7.2.35 CF7.2.36 CF7.2.37 CF7.2.38 CF7.2.39 CF7.2.40 CM7.1.RF-DOWN CM7.1.RF-UP CM7.2.RF-DOWN CM7.2.RF-UP CM7.3.RF-DOWN CM7.3.RF-UP

## Sheet 8 of 20: Slot 8
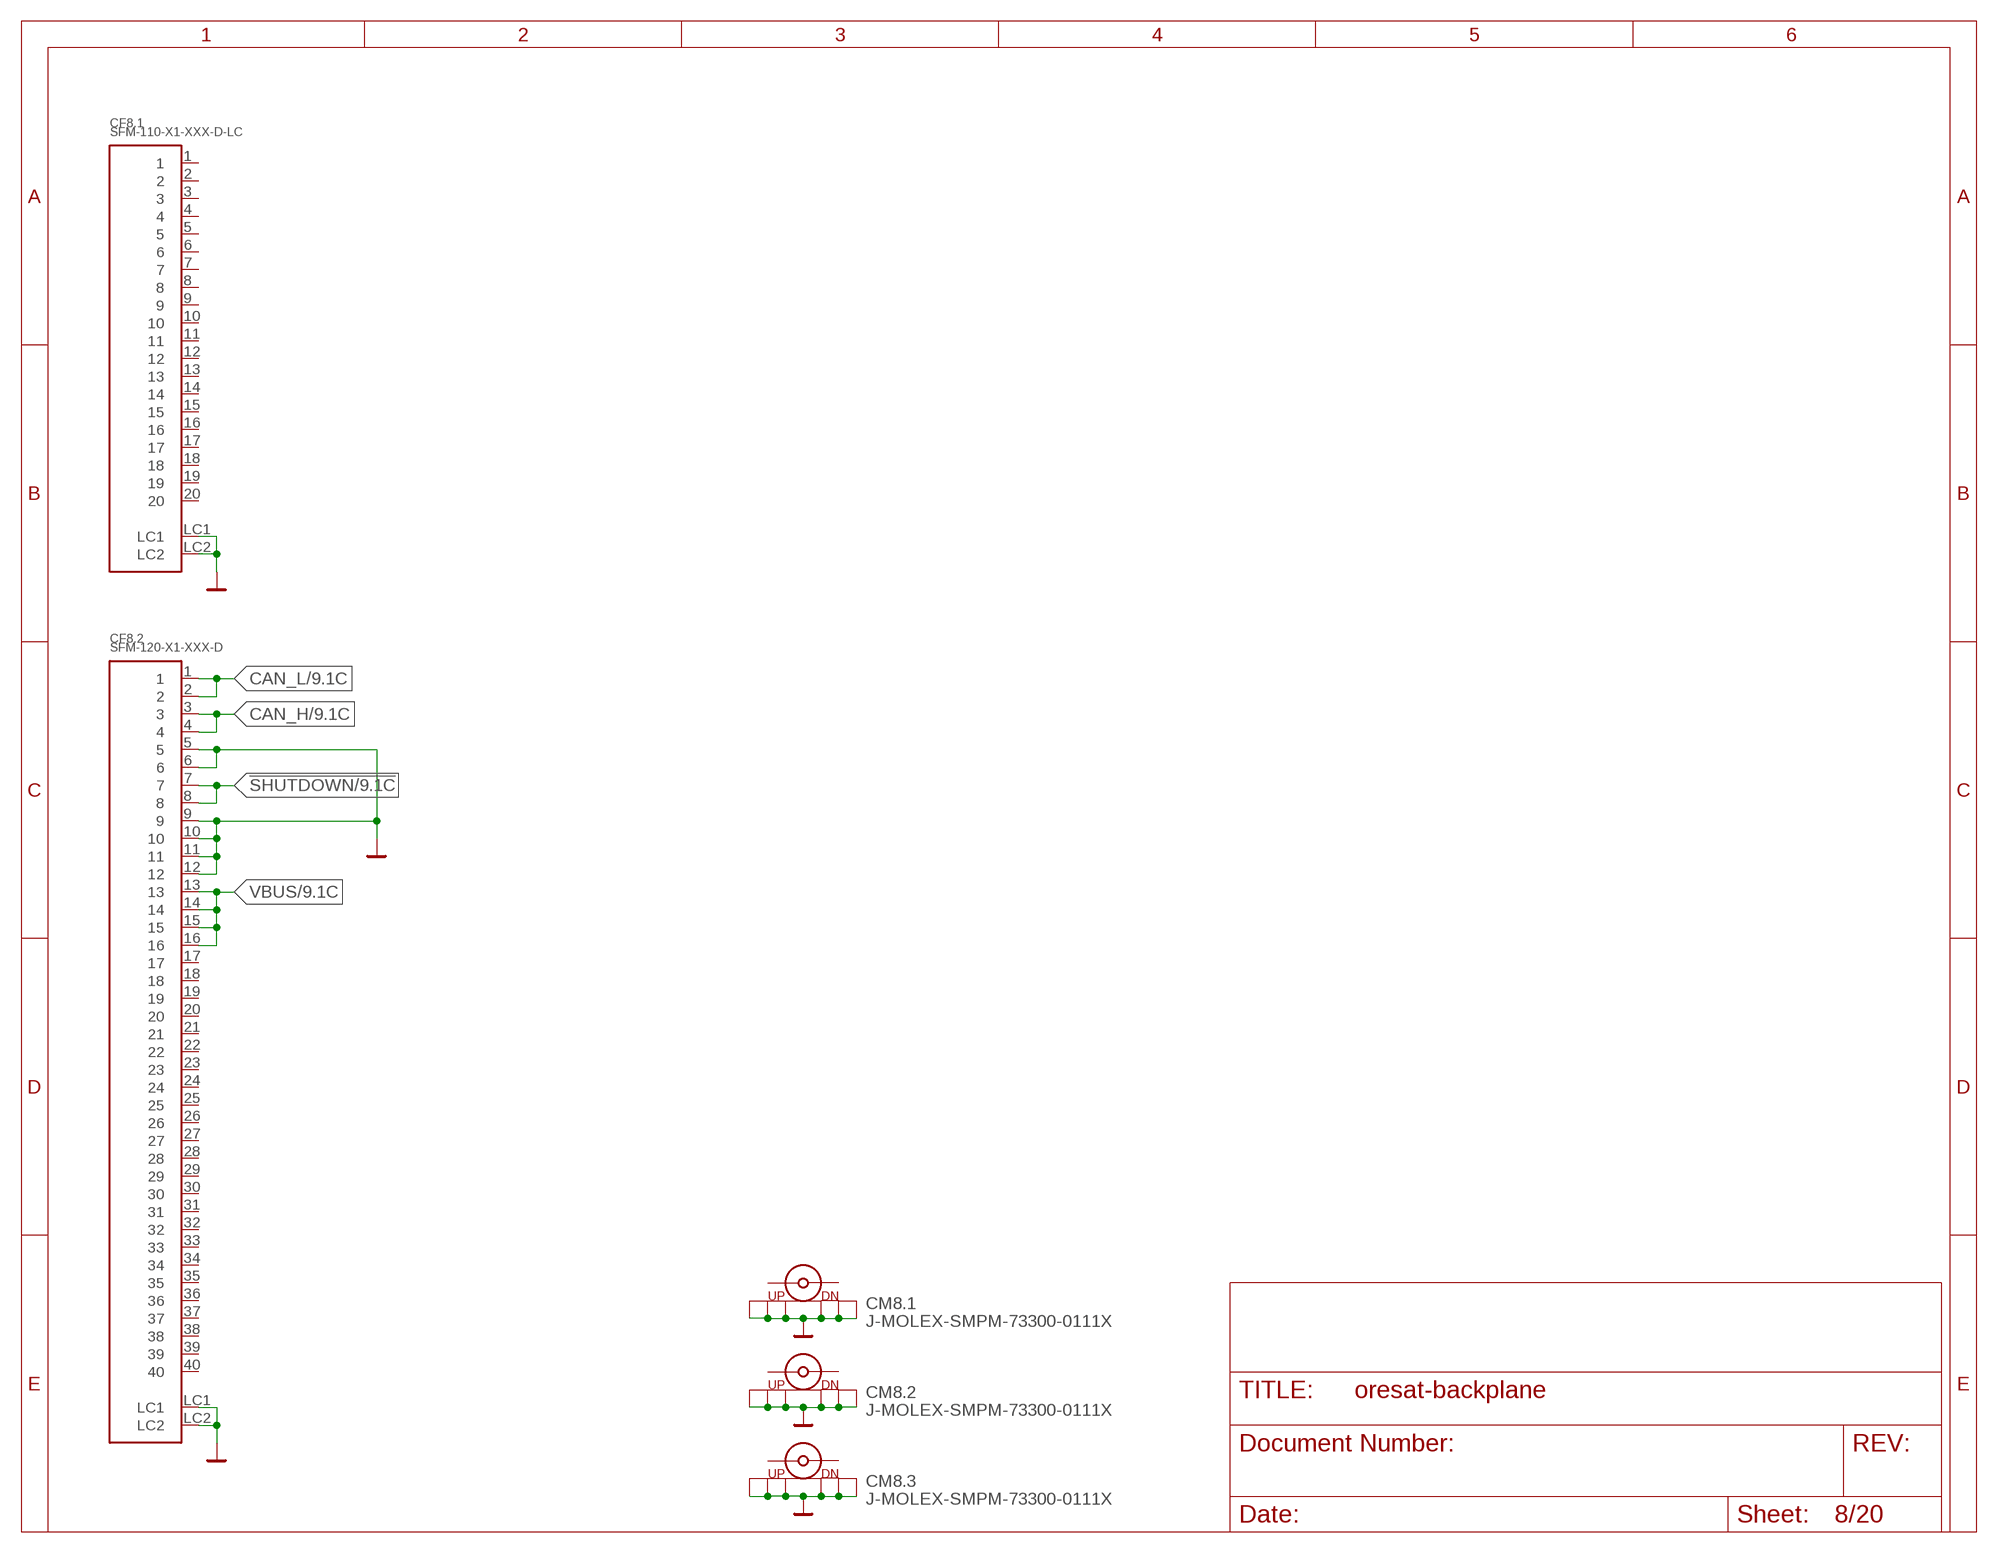
[diagram p7: schematic, sheet 8]

### Parts
CF8.1  SFM-110-X1-XXX-D-LC  [SFM-110-X1-XXX-D-LC]
CF8.2  SFM-120-X1-XXX-D  [SFM-120-X1-XXX-D]
CM8.1  J-MOLEX-SMPM-73300-0111X  [J-MOLEX-SMPM-73300-0111X]
CM8.2  J-MOLEX-SMPM-73300-0111X  [J-MOLEX-SMPM-73300-0111X]
CM8.3  J-MOLEX-SMPM-73300-0111X  [J-MOLEX-SMPM-73300-0111X]

### Nets
!SHUTDOWN: CF8.2.7 CF8.2.8 ; also sheet 1,2,3,4,5,6,7,9,10,11,12,13,14,15,16,17,18,19,20
CAN_H: CF8.2.3 CF8.2.4 ; also sheet 1,2,3,4,5,6,7,9,10,11,12,13,14,15,16,17,18,19,20
CAN_L: CF8.2.1 CF8.2.2 ; also sheet 1,2,3,4,5,6,7,9,10,11,12,13,14,15,16,17,18,19,20
GND: CF8.1.LC1 CF8.1.LC2 CF8.2.5 CF8.2.6 CF8.2.9 CF8.2.10 CF8.2.11 CF8.2.12 CF8.2.LC1 CF8.2.LC2 CM8.1.P$1(SHIELD) CM8.1.P$2(SHIELD1) CM8.1.P$3(SHIELD2) CM8.1.P$4(SHIELD3) CM8.1.P$5(SHIELD5) CM8.1.P$6(SHIELD4) CM8.2.P$1(SHIELD) CM8.2.P$2(SHIELD1) CM8.2.P$3(SHIELD2) CM8.2.P$4(SHIELD3) CM8.2.P$5(SHIELD5) CM8.2.P$6(SHIELD4) CM8.3.P$1(SHIELD) CM8.3.P$2(SHIELD1) CM8.3.P$3(SHIELD2) CM8.3.P$4(SHIELD3) CM8.3.P$5(SHIELD5) CM8.3.P$6(SHIELD4) ; also sheet 1,2,3,4,5,6,7,9,10,11,12,13,14,15,16,17,18,19,20
VBUS: CF8.2.13 CF8.2.14 CF8.2.15 CF8.2.16 ; also sheet 1,2,3,4,5,6,7,9,10,11,12,13,14,15,16,17,18,19,20
Unconnected: CF8.1.1 CF8.1.2 CF8.1.3 CF8.1.4 CF8.1.5 CF8.1.6 CF8.1.7 CF8.1.8 CF8.1.9 CF8.1.10 CF8.1.11 CF8.1.12 CF8.1.13 CF8.1.14 CF8.1.15 CF8.1.16 CF8.1.17 CF8.1.18 CF8.1.19 CF8.1.20 CF8.2.17 CF8.2.18 CF8.2.19 CF8.2.20 CF8.2.21 CF8.2.22 CF8.2.23 CF8.2.24 CF8.2.25 CF8.2.26 CF8.2.27 CF8.2.28 CF8.2.29 CF8.2.30 CF8.2.31 CF8.2.32 CF8.2.33 CF8.2.34 CF8.2.35 CF8.2.36 CF8.2.37 CF8.2.38 CF8.2.39 CF8.2.40 CM8.1.RF-DOWN CM8.1.RF-UP CM8.2.RF-DOWN CM8.2.RF-UP CM8.3.RF-DOWN CM8.3.RF-UP

## Sheet 9 of 20: Slot 9
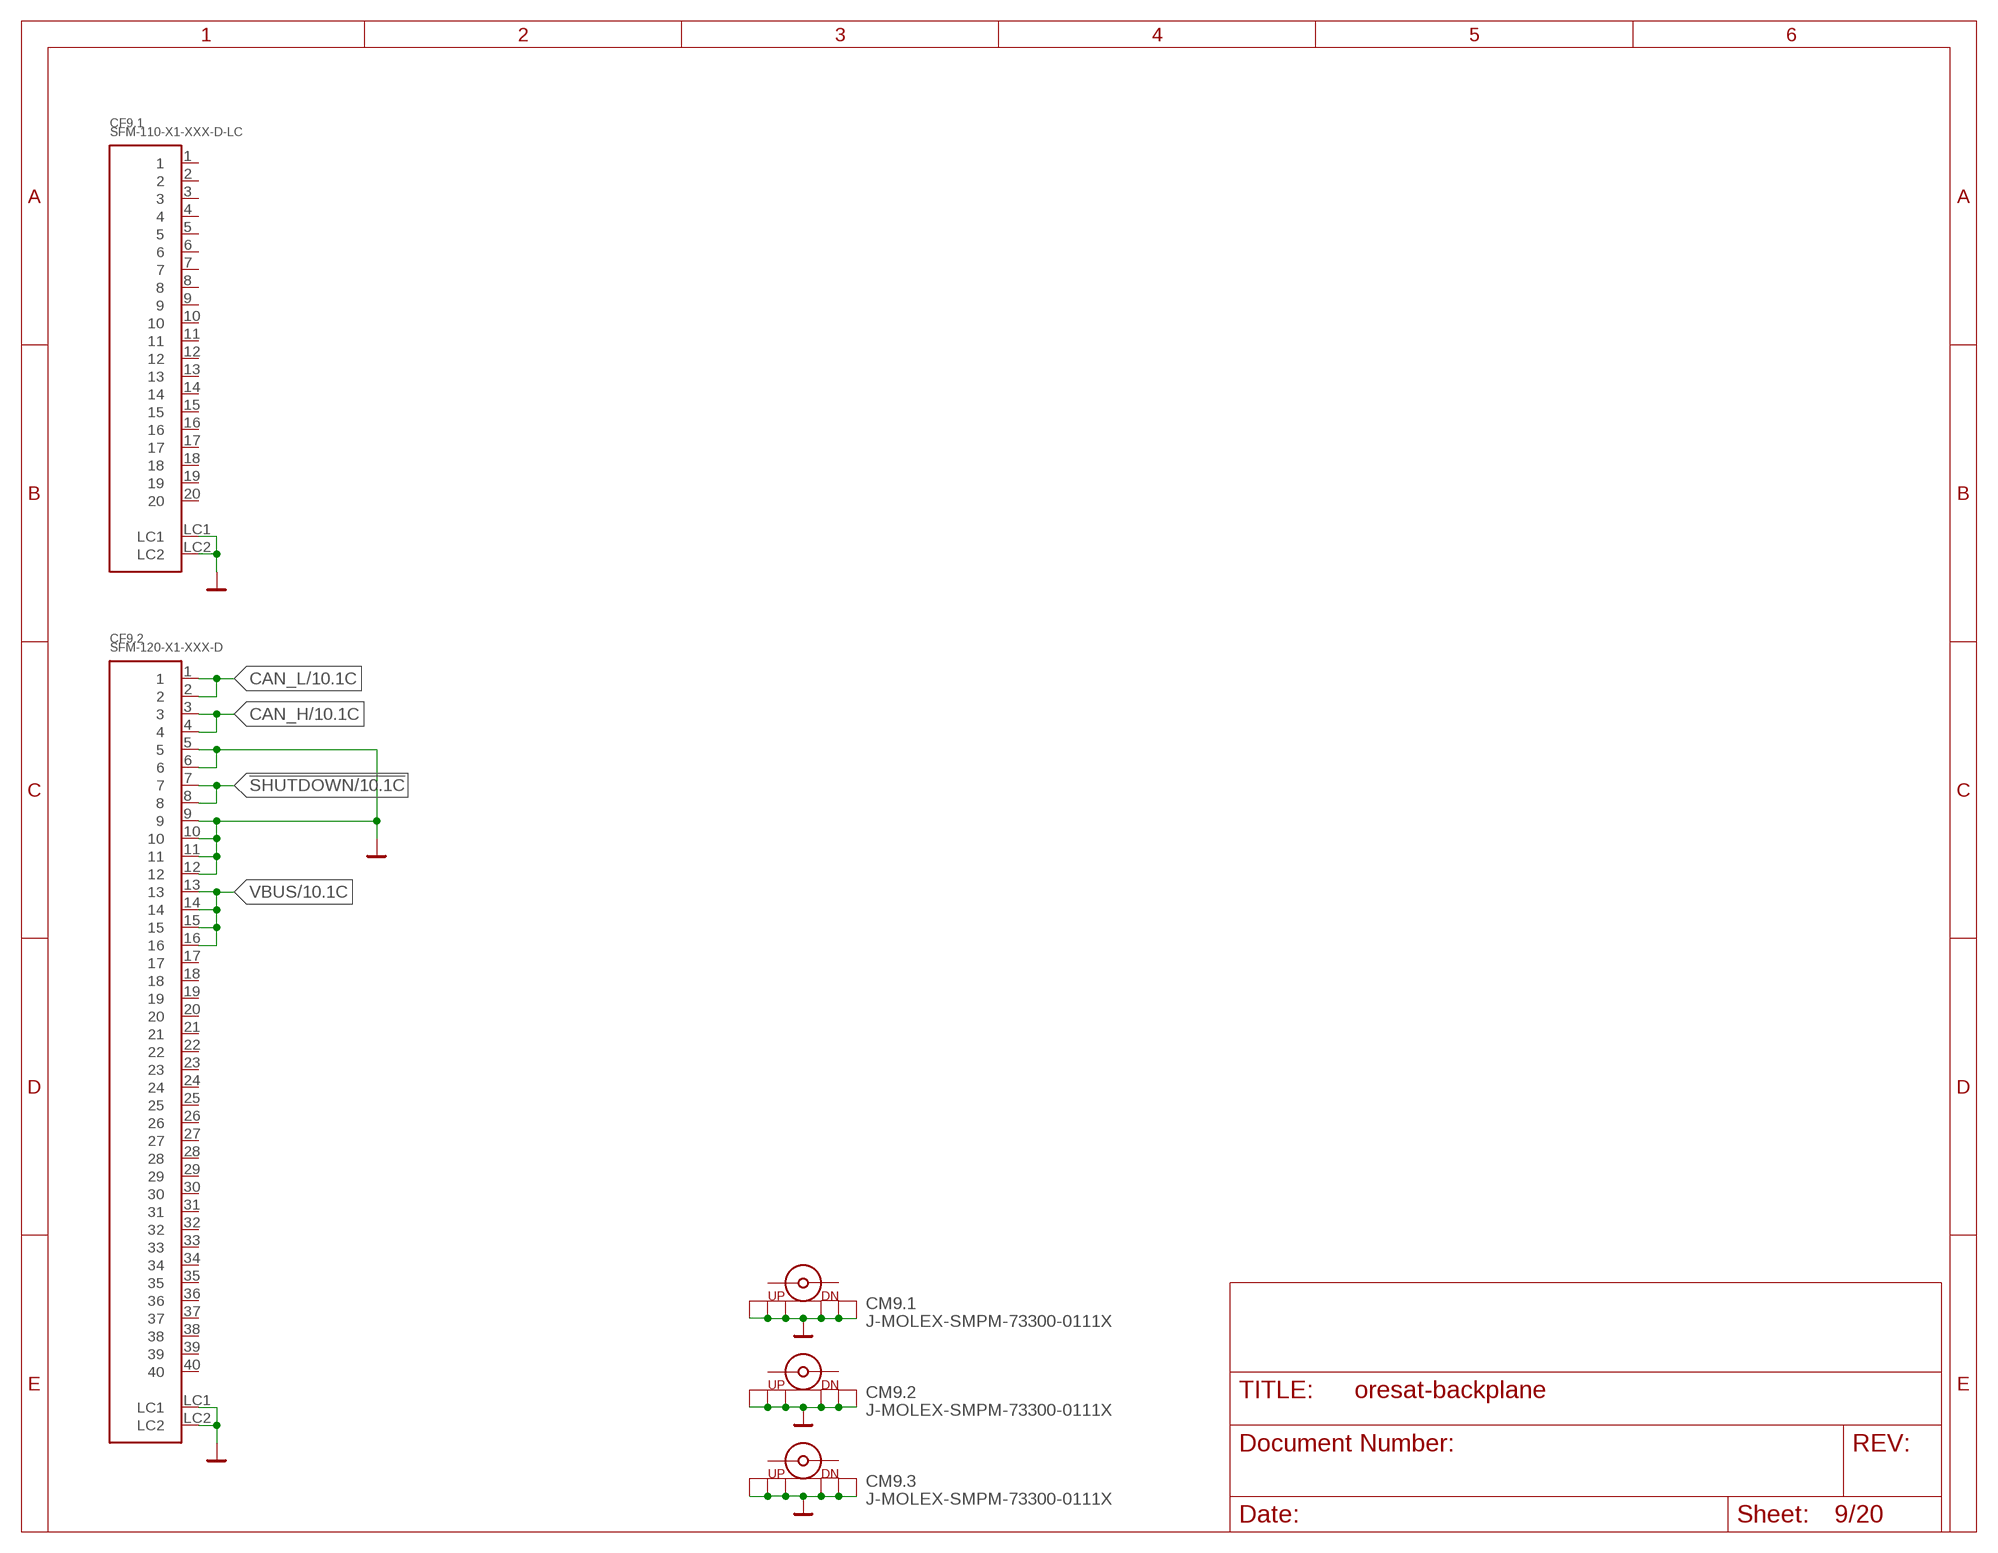
[diagram p8: schematic, sheet 9]

### Parts
CF9.1  SFM-110-X1-XXX-D-LC  [SFM-110-X1-XXX-D-LC]
CF9.2  SFM-120-X1-XXX-D  [SFM-120-X1-XXX-D]
CM9.1  J-MOLEX-SMPM-73300-0111X  [J-MOLEX-SMPM-73300-0111X]
CM9.2  J-MOLEX-SMPM-73300-0111X  [J-MOLEX-SMPM-73300-0111X]
CM9.3  J-MOLEX-SMPM-73300-0111X  [J-MOLEX-SMPM-73300-0111X]

### Nets
!SHUTDOWN: CF9.2.7 CF9.2.8 ; also sheet 1,2,3,4,5,6,7,8,10,11,12,13,14,15,16,17,18,19,20
CAN_H: CF9.2.3 CF9.2.4 ; also sheet 1,2,3,4,5,6,7,8,10,11,12,13,14,15,16,17,18,19,20
CAN_L: CF9.2.1 CF9.2.2 ; also sheet 1,2,3,4,5,6,7,8,10,11,12,13,14,15,16,17,18,19,20
GND: CF9.1.LC1 CF9.1.LC2 CF9.2.5 CF9.2.6 CF9.2.9 CF9.2.10 CF9.2.11 CF9.2.12 CF9.2.LC1 CF9.2.LC2 CM9.1.P$1(SHIELD) CM9.1.P$2(SHIELD1) CM9.1.P$3(SHIELD2) CM9.1.P$4(SHIELD3) CM9.1.P$5(SHIELD5) CM9.1.P$6(SHIELD4) CM9.2.P$1(SHIELD) CM9.2.P$2(SHIELD1) CM9.2.P$3(SHIELD2) CM9.2.P$4(SHIELD3) CM9.2.P$5(SHIELD5) CM9.2.P$6(SHIELD4) CM9.3.P$1(SHIELD) CM9.3.P$2(SHIELD1) CM9.3.P$3(SHIELD2) CM9.3.P$4(SHIELD3) CM9.3.P$5(SHIELD5) CM9.3.P$6(SHIELD4) ; also sheet 1,2,3,4,5,6,7,8,10,11,12,13,14,15,16,17,18,19,20
VBUS: CF9.2.13 CF9.2.14 CF9.2.15 CF9.2.16 ; also sheet 1,2,3,4,5,6,7,8,10,11,12,13,14,15,16,17,18,19,20
Unconnected: CF9.1.1 CF9.1.2 CF9.1.3 CF9.1.4 CF9.1.5 CF9.1.6 CF9.1.7 CF9.1.8 CF9.1.9 CF9.1.10 CF9.1.11 CF9.1.12 CF9.1.13 CF9.1.14 CF9.1.15 CF9.1.16 CF9.1.17 CF9.1.18 CF9.1.19 CF9.1.20 CF9.2.17 CF9.2.18 CF9.2.19 CF9.2.20 CF9.2.21 CF9.2.22 CF9.2.23 CF9.2.24 CF9.2.25 CF9.2.26 CF9.2.27 CF9.2.28 CF9.2.29 CF9.2.30 CF9.2.31 CF9.2.32 CF9.2.33 CF9.2.34 CF9.2.35 CF9.2.36 CF9.2.37 CF9.2.38 CF9.2.39 CF9.2.40 CM9.1.RF-DOWN CM9.1.RF-UP CM9.2.RF-DOWN CM9.2.RF-UP CM9.3.RF-DOWN CM9.3.RF-UP

## Sheet 10 of 20: Slot 10
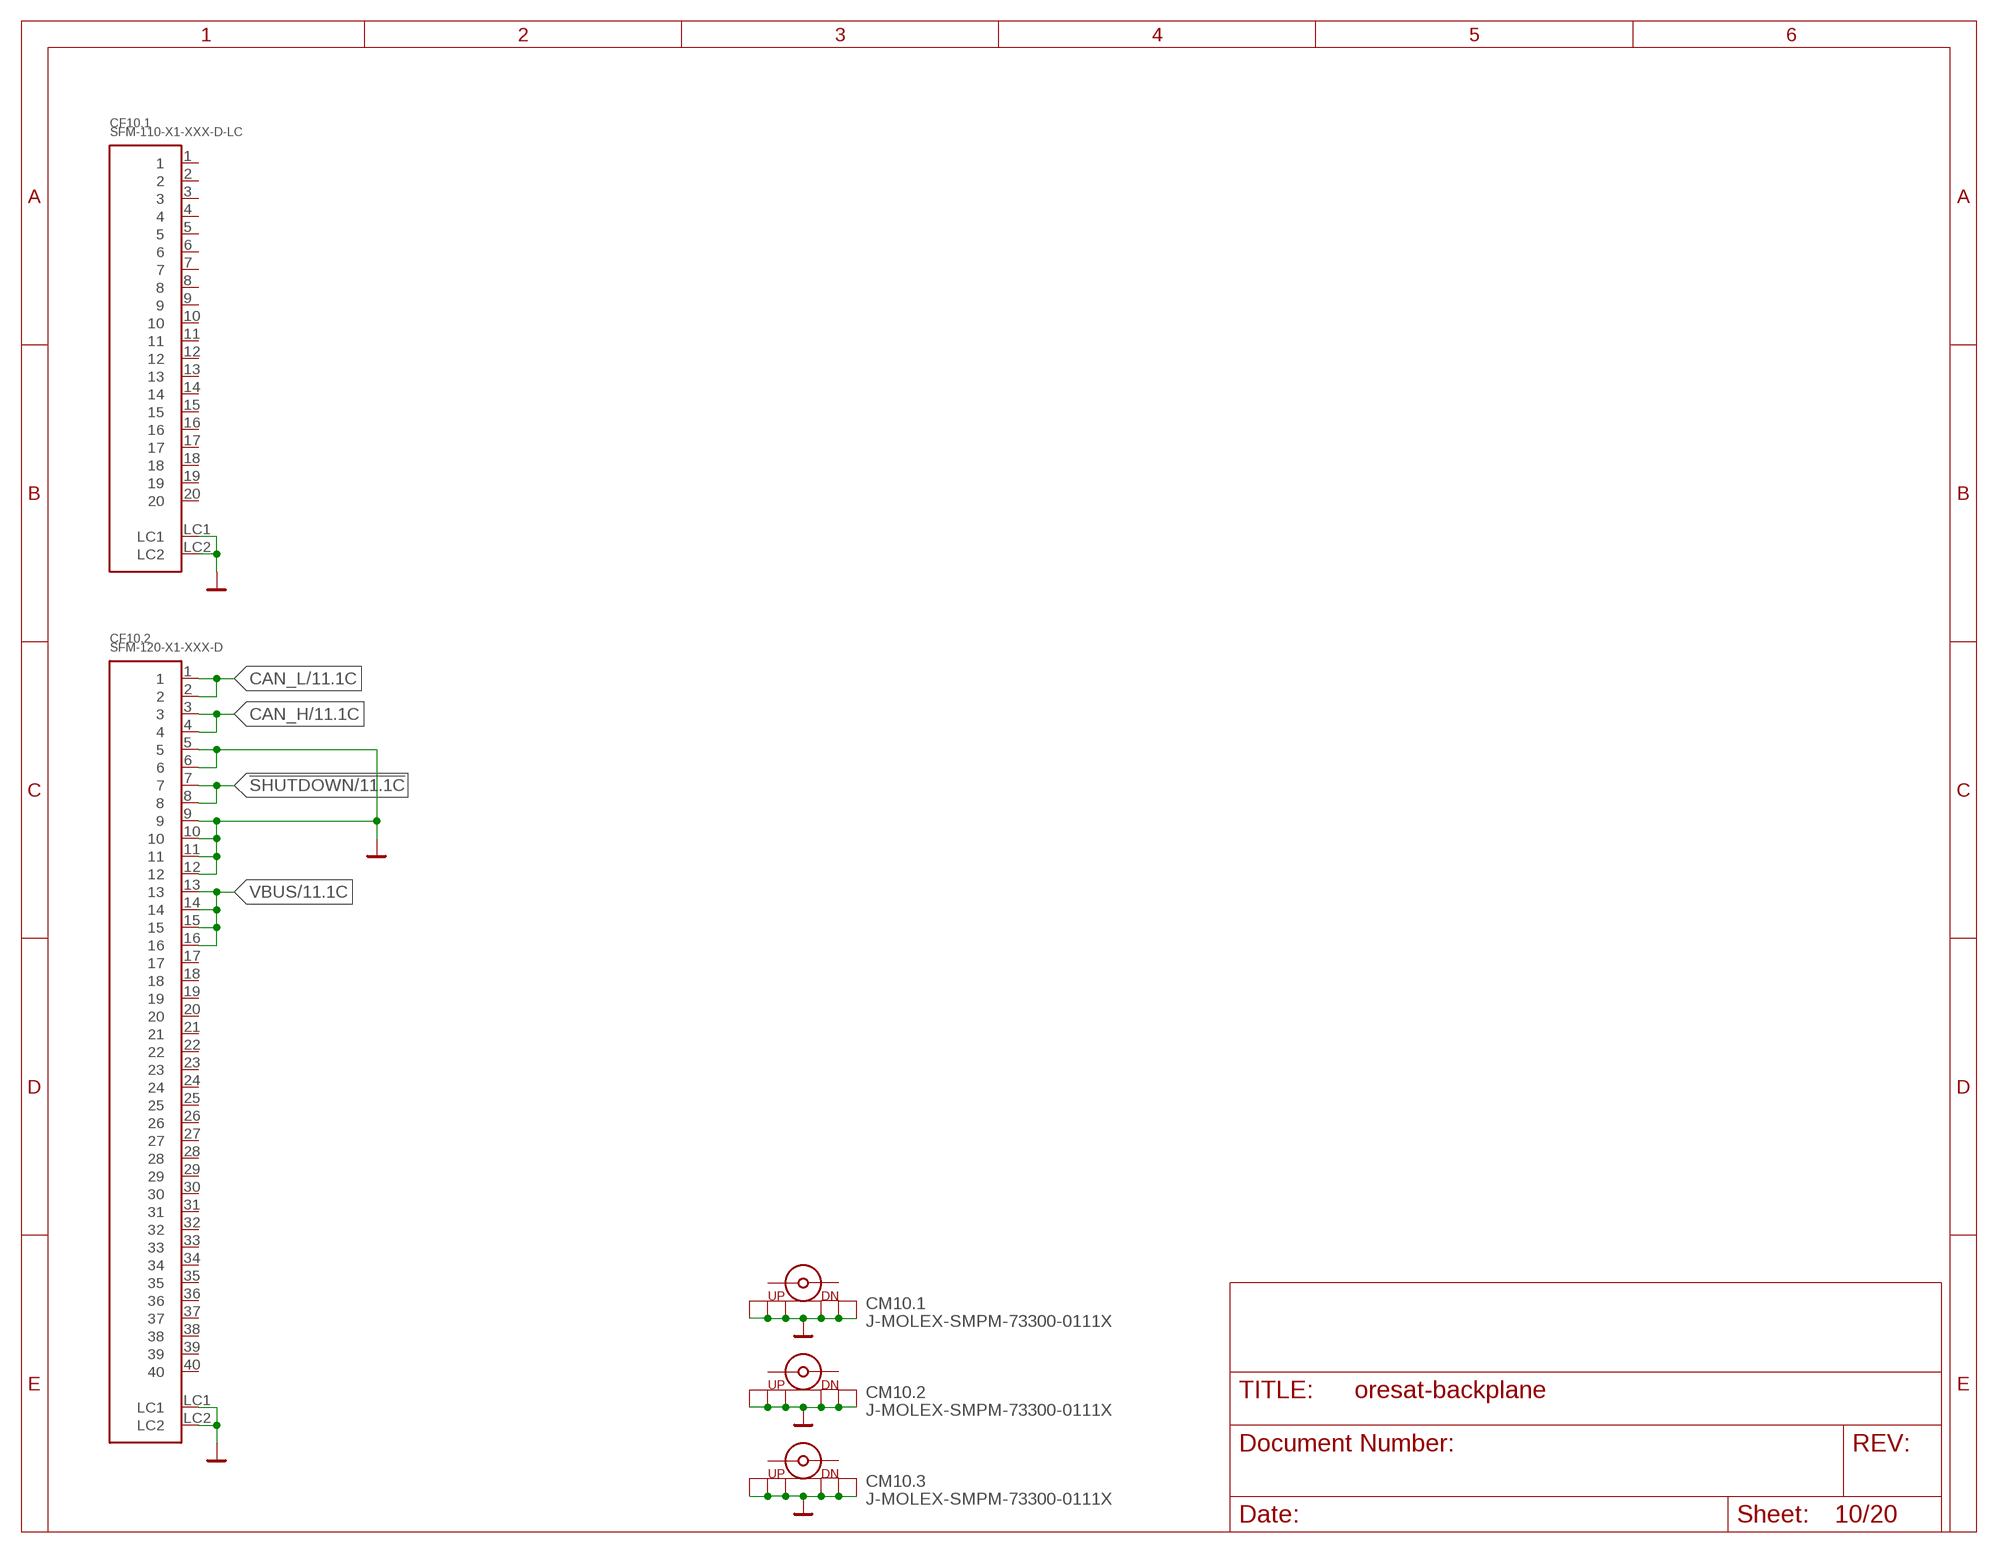
[diagram p9: schematic, sheet 10]

### Parts
CF10.1  SFM-110-X1-XXX-D-LC  [SFM-110-X1-XXX-D-LC]
CF10.2  SFM-120-X1-XXX-D  [SFM-120-X1-XXX-D]
CM10.1  J-MOLEX-SMPM-73300-0111X  [J-MOLEX-SMPM-73300-0111X]
CM10.2  J-MOLEX-SMPM-73300-0111X  [J-MOLEX-SMPM-73300-0111X]
CM10.3  J-MOLEX-SMPM-73300-0111X  [J-MOLEX-SMPM-73300-0111X]

### Nets
!SHUTDOWN: CF10.2.7 CF10.2.8 ; also sheet 1,2,3,4,5,6,7,8,9,11,12,13,14,15,16,17,18,19,20
CAN_H: CF10.2.3 CF10.2.4 ; also sheet 1,2,3,4,5,6,7,8,9,11,12,13,14,15,16,17,18,19,20
CAN_L: CF10.2.1 CF10.2.2 ; also sheet 1,2,3,4,5,6,7,8,9,11,12,13,14,15,16,17,18,19,20
GND: CF10.1.LC1 CF10.1.LC2 CF10.2.5 CF10.2.6 CF10.2.9 CF10.2.10 CF10.2.11 CF10.2.12 CF10.2.LC1 CF10.2.LC2 CM10.1.P$1(SHIELD) CM10.1.P$2(SHIELD1) CM10.1.P$3(SHIELD2) CM10.1.P$4(SHIELD3) CM10.1.P$5(SHIELD5) CM10.1.P$6(SHIELD4) CM10.2.P$1(SHIELD) CM10.2.P$2(SHIELD1) CM10.2.P$3(SHIELD2) CM10.2.P$4(SHIELD3) CM10.2.P$5(SHIELD5) CM10.2.P$6(SHIELD4) CM10.3.P$1(SHIELD) CM10.3.P$2(SHIELD1) CM10.3.P$3(SHIELD2) CM10.3.P$4(SHIELD3) CM10.3.P$5(SHIELD5) CM10.3.P$6(SHIELD4) ; also sheet 1,2,3,4,5,6,7,8,9,11,12,13,14,15,16,17,18,19,20
VBUS: CF10.2.13 CF10.2.14 CF10.2.15 CF10.2.16 ; also sheet 1,2,3,4,5,6,7,8,9,11,12,13,14,15,16,17,18,19,20
Unconnected: CF10.1.1 CF10.1.2 CF10.1.3 CF10.1.4 CF10.1.5 CF10.1.6 CF10.1.7 CF10.1.8 CF10.1.9 CF10.1.10 CF10.1.11 CF10.1.12 CF10.1.13 CF10.1.14 CF10.1.15 CF10.1.16 CF10.1.17 CF10.1.18 CF10.1.19 CF10.1.20 CF10.2.17 CF10.2.18 CF10.2.19 CF10.2.20 CF10.2.21 CF10.2.22 CF10.2.23 CF10.2.24 CF10.2.25 CF10.2.26 CF10.2.27 CF10.2.28 CF10.2.29 CF10.2.30 CF10.2.31 CF10.2.32 CF10.2.33 CF10.2.34 CF10.2.35 CF10.2.36 CF10.2.37 CF10.2.38 CF10.2.39 CF10.2.40 CM10.1.RF-DOWN CM10.1.RF-UP CM10.2.RF-DOWN CM10.2.RF-UP CM10.3.RF-DOWN CM10.3.RF-UP

## Sheet 11 of 20: Slot 11
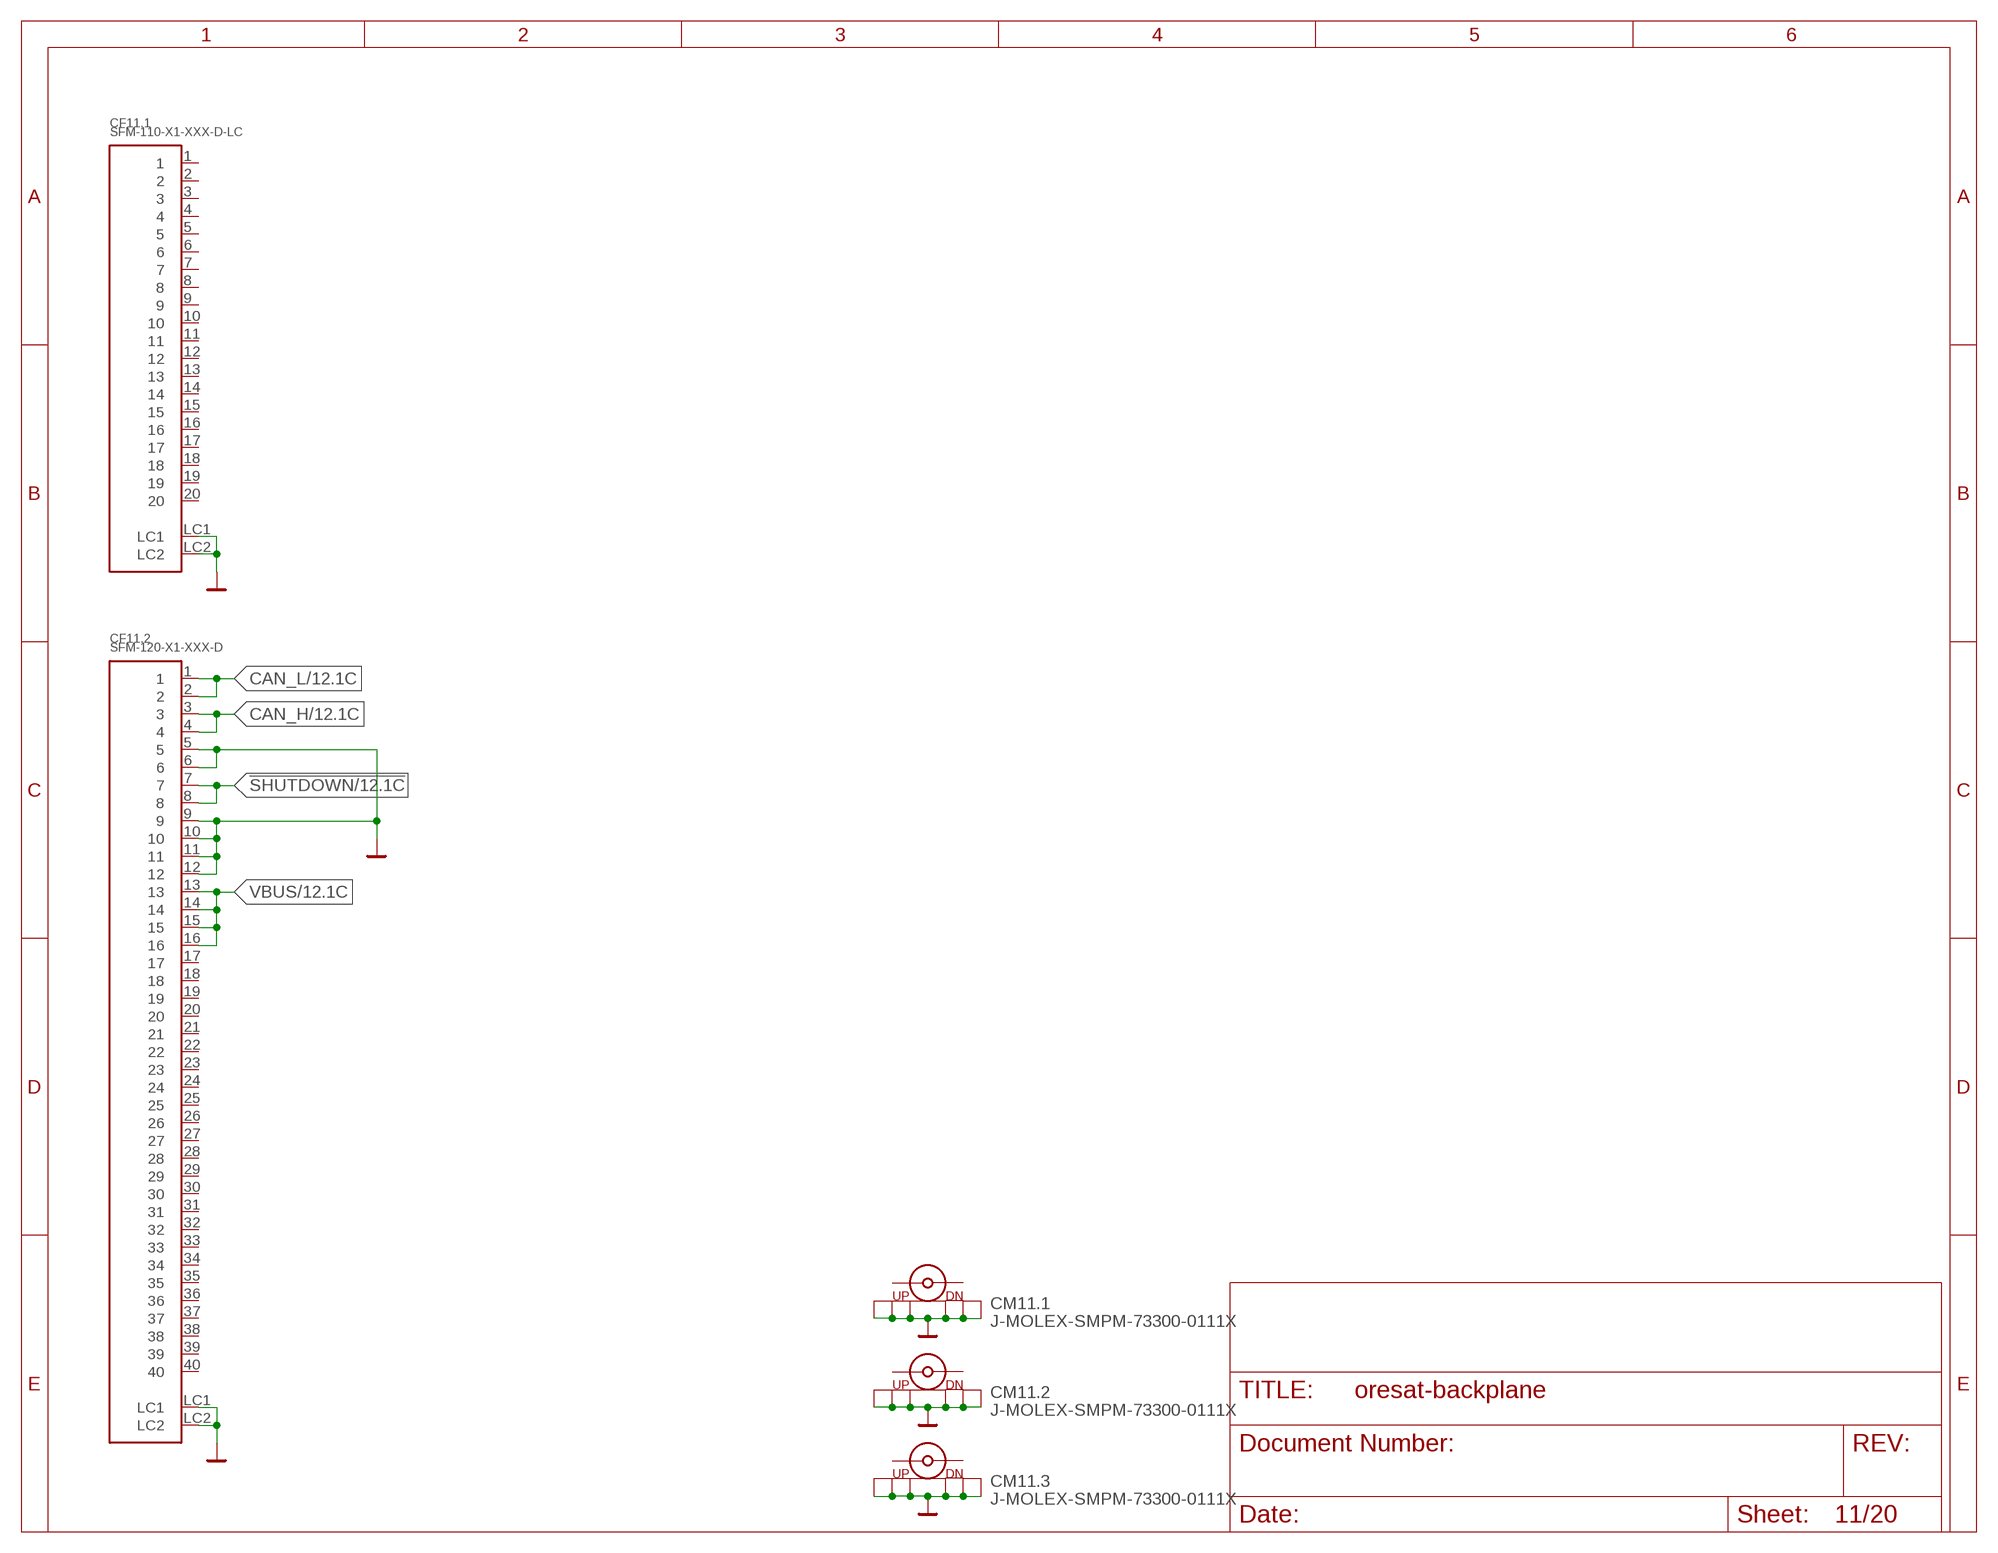
[diagram p10: schematic, sheet 11]

### Parts
CF11.1  SFM-110-X1-XXX-D-LC  [SFM-110-X1-XXX-D-LC]
CF11.2  SFM-120-X1-XXX-D  [SFM-120-X1-XXX-D]
CM11.1  J-MOLEX-SMPM-73300-0111X  [J-MOLEX-SMPM-73300-0111X]
CM11.2  J-MOLEX-SMPM-73300-0111X  [J-MOLEX-SMPM-73300-0111X]
CM11.3  J-MOLEX-SMPM-73300-0111X  [J-MOLEX-SMPM-73300-0111X]

### Nets
!SHUTDOWN: CF11.2.7 CF11.2.8 ; also sheet 1,2,3,4,5,6,7,8,9,10,12,13,14,15,16,17,18,19,20
CAN_H: CF11.2.3 CF11.2.4 ; also sheet 1,2,3,4,5,6,7,8,9,10,12,13,14,15,16,17,18,19,20
CAN_L: CF11.2.1 CF11.2.2 ; also sheet 1,2,3,4,5,6,7,8,9,10,12,13,14,15,16,17,18,19,20
GND: CF11.1.LC1 CF11.1.LC2 CF11.2.5 CF11.2.6 CF11.2.9 CF11.2.10 CF11.2.11 CF11.2.12 CF11.2.LC1 CF11.2.LC2 CM11.1.P$1(SHIELD) CM11.1.P$2(SHIELD1) CM11.1.P$3(SHIELD2) CM11.1.P$4(SHIELD3) CM11.1.P$5(SHIELD5) CM11.1.P$6(SHIELD4) CM11.2.P$1(SHIELD) CM11.2.P$2(SHIELD1) CM11.2.P$3(SHIELD2) CM11.2.P$4(SHIELD3) CM11.2.P$5(SHIELD5) CM11.2.P$6(SHIELD4) CM11.3.P$1(SHIELD) CM11.3.P$2(SHIELD1) CM11.3.P$3(SHIELD2) CM11.3.P$4(SHIELD3) CM11.3.P$5(SHIELD5) CM11.3.P$6(SHIELD4) ; also sheet 1,2,3,4,5,6,7,8,9,10,12,13,14,15,16,17,18,19,20
VBUS: CF11.2.13 CF11.2.14 CF11.2.15 CF11.2.16 ; also sheet 1,2,3,4,5,6,7,8,9,10,12,13,14,15,16,17,18,19,20
Unconnected: CF11.1.1 CF11.1.2 CF11.1.3 CF11.1.4 CF11.1.5 CF11.1.6 CF11.1.7 CF11.1.8 CF11.1.9 CF11.1.10 CF11.1.11 CF11.1.12 CF11.1.13 CF11.1.14 CF11.1.15 CF11.1.16 CF11.1.17 CF11.1.18 CF11.1.19 CF11.1.20 CF11.2.17 CF11.2.18 CF11.2.19 CF11.2.20 CF11.2.21 CF11.2.22 CF11.2.23 CF11.2.24 CF11.2.25 CF11.2.26 CF11.2.27 CF11.2.28 CF11.2.29 CF11.2.30 CF11.2.31 CF11.2.32 CF11.2.33 CF11.2.34 CF11.2.35 CF11.2.36 CF11.2.37 CF11.2.38 CF11.2.39 CF11.2.40 CM11.1.RF-DOWN CM11.1.RF-UP CM11.2.RF-DOWN CM11.2.RF-UP CM11.3.RF-DOWN CM11.3.RF-UP

## Sheet 12 of 20: Slot 12
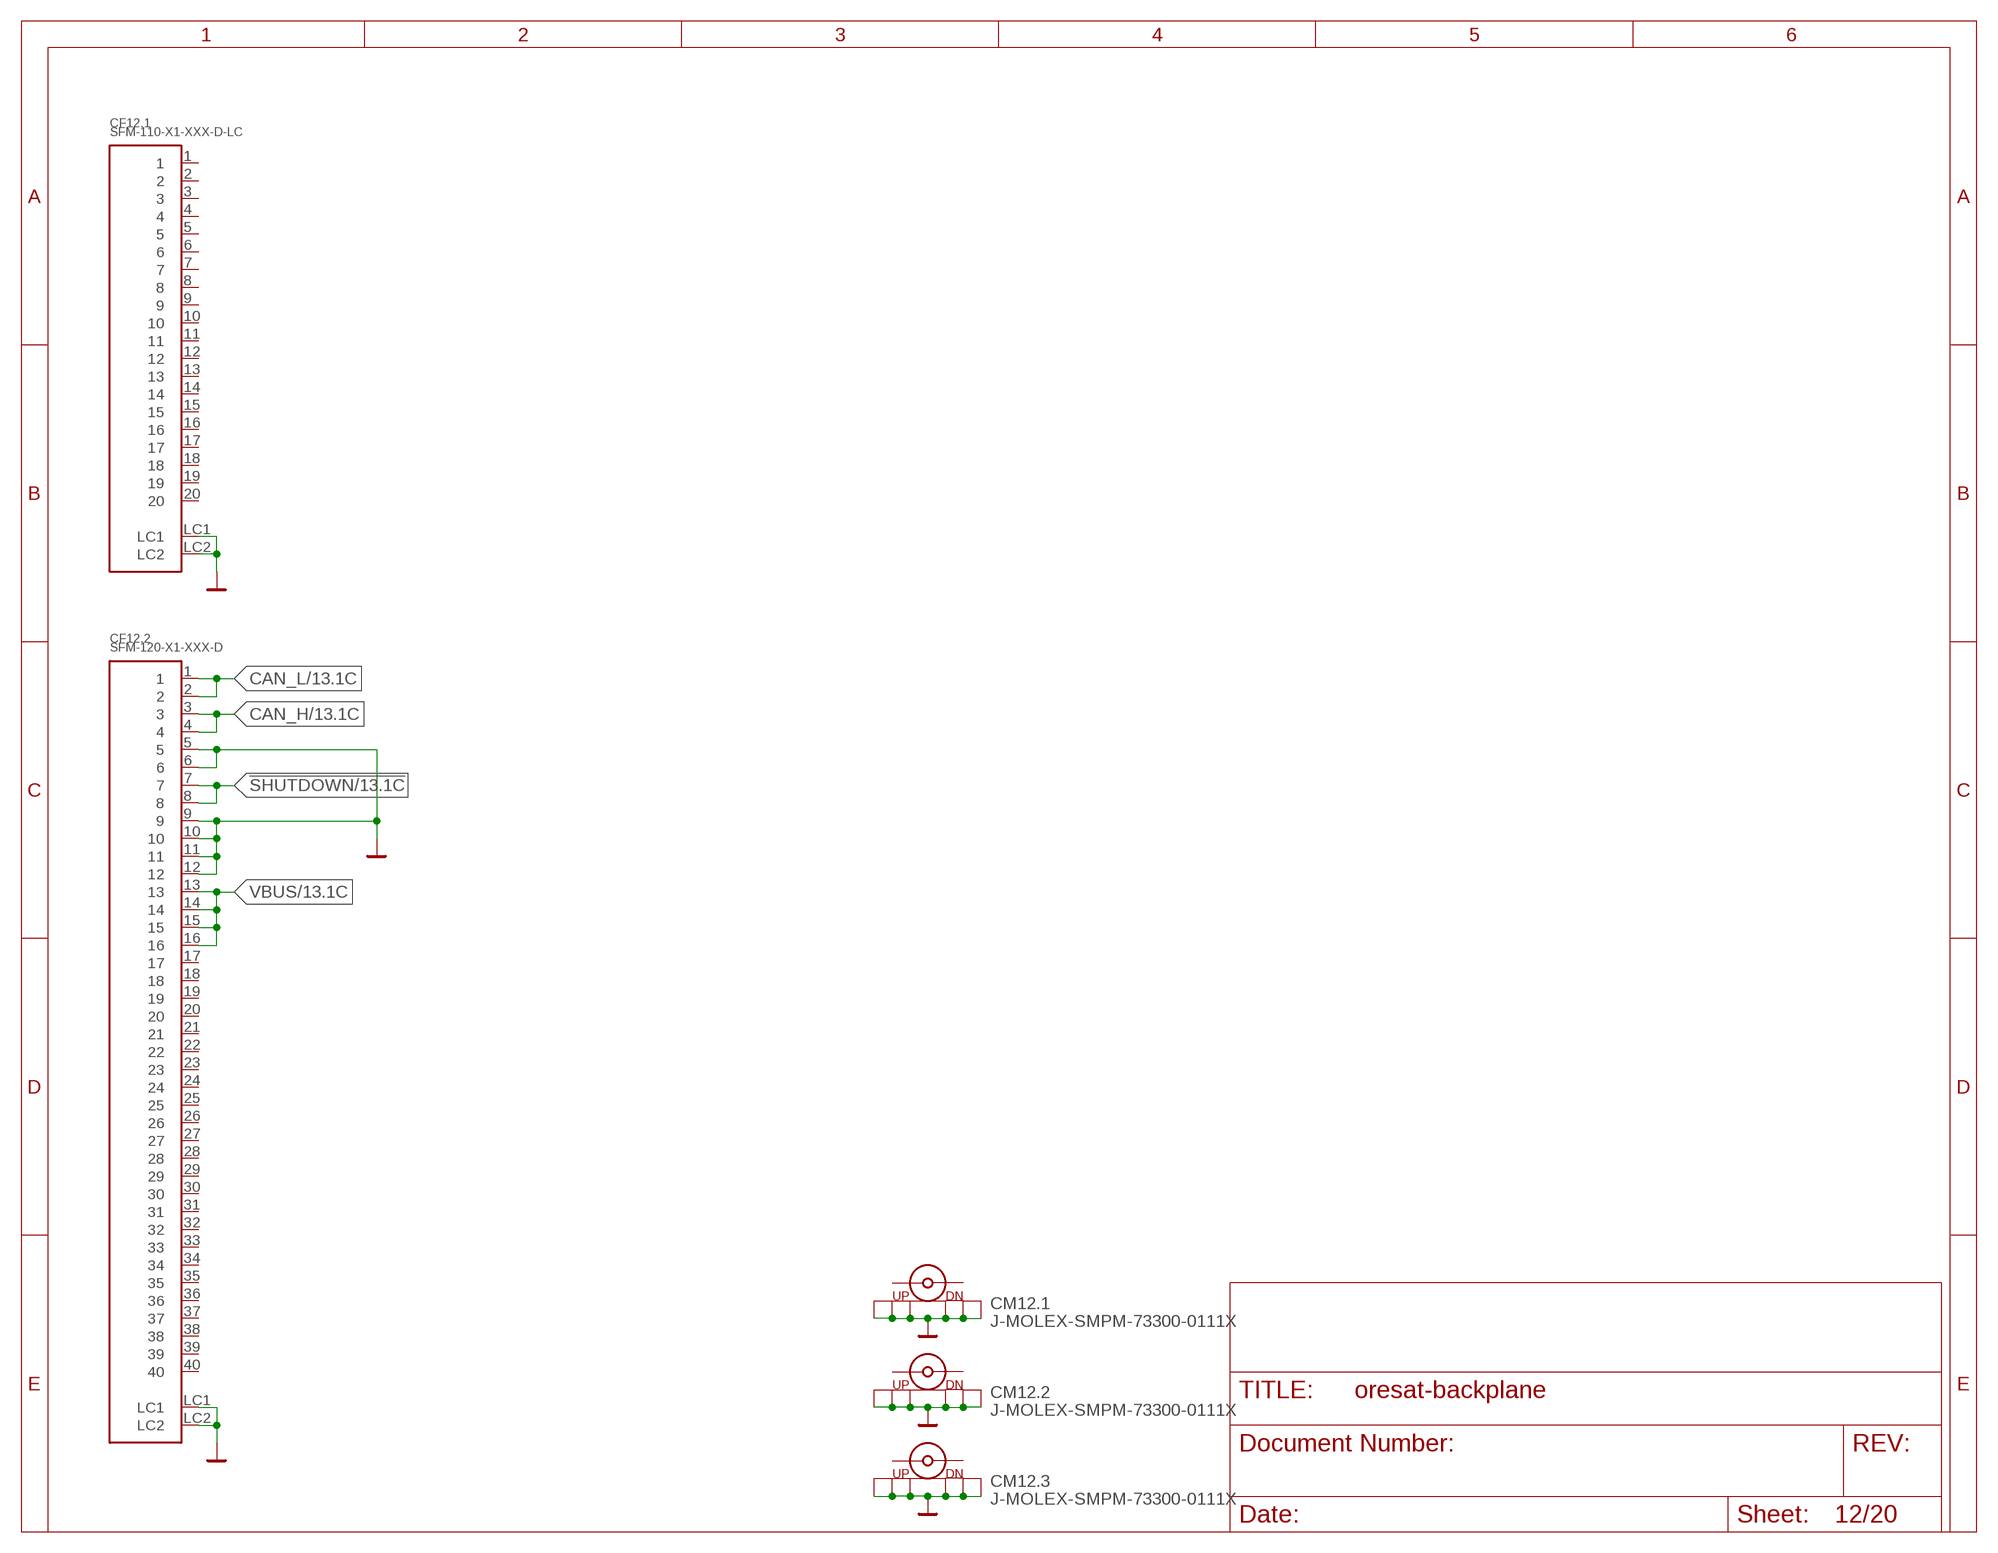
[diagram p11: schematic, sheet 12]

### Parts
CF12.1  SFM-110-X1-XXX-D-LC  [SFM-110-X1-XXX-D-LC]
CF12.2  SFM-120-X1-XXX-D  [SFM-120-X1-XXX-D]
CM12.1  J-MOLEX-SMPM-73300-0111X  [J-MOLEX-SMPM-73300-0111X]
CM12.2  J-MOLEX-SMPM-73300-0111X  [J-MOLEX-SMPM-73300-0111X]
CM12.3  J-MOLEX-SMPM-73300-0111X  [J-MOLEX-SMPM-73300-0111X]

### Nets
!SHUTDOWN: CF12.2.7 CF12.2.8 ; also sheet 1,2,3,4,5,6,7,8,9,10,11,13,14,15,16,17,18,19,20
CAN_H: CF12.2.3 CF12.2.4 ; also sheet 1,2,3,4,5,6,7,8,9,10,11,13,14,15,16,17,18,19,20
CAN_L: CF12.2.1 CF12.2.2 ; also sheet 1,2,3,4,5,6,7,8,9,10,11,13,14,15,16,17,18,19,20
GND: CF12.1.LC1 CF12.1.LC2 CF12.2.5 CF12.2.6 CF12.2.9 CF12.2.10 CF12.2.11 CF12.2.12 CF12.2.LC1 CF12.2.LC2 CM12.1.P$1(SHIELD) CM12.1.P$2(SHIELD1) CM12.1.P$3(SHIELD2) CM12.1.P$4(SHIELD3) CM12.1.P$5(SHIELD5) CM12.1.P$6(SHIELD4) CM12.2.P$1(SHIELD) CM12.2.P$2(SHIELD1) CM12.2.P$3(SHIELD2) CM12.2.P$4(SHIELD3) CM12.2.P$5(SHIELD5) CM12.2.P$6(SHIELD4) CM12.3.P$1(SHIELD) CM12.3.P$2(SHIELD1) CM12.3.P$3(SHIELD2) CM12.3.P$4(SHIELD3) CM12.3.P$5(SHIELD5) CM12.3.P$6(SHIELD4) ; also sheet 1,2,3,4,5,6,7,8,9,10,11,13,14,15,16,17,18,19,20
VBUS: CF12.2.13 CF12.2.14 CF12.2.15 CF12.2.16 ; also sheet 1,2,3,4,5,6,7,8,9,10,11,13,14,15,16,17,18,19,20
Unconnected: CF12.1.1 CF12.1.2 CF12.1.3 CF12.1.4 CF12.1.5 CF12.1.6 CF12.1.7 CF12.1.8 CF12.1.9 CF12.1.10 CF12.1.11 CF12.1.12 CF12.1.13 CF12.1.14 CF12.1.15 CF12.1.16 CF12.1.17 CF12.1.18 CF12.1.19 CF12.1.20 CF12.2.17 CF12.2.18 CF12.2.19 CF12.2.20 CF12.2.21 CF12.2.22 CF12.2.23 CF12.2.24 CF12.2.25 CF12.2.26 CF12.2.27 CF12.2.28 CF12.2.29 CF12.2.30 CF12.2.31 CF12.2.32 CF12.2.33 CF12.2.34 CF12.2.35 CF12.2.36 CF12.2.37 CF12.2.38 CF12.2.39 CF12.2.40 CM12.1.RF-DOWN CM12.1.RF-UP CM12.2.RF-DOWN CM12.2.RF-UP CM12.3.RF-DOWN CM12.3.RF-UP

## Sheet 13 of 20: Slot 13
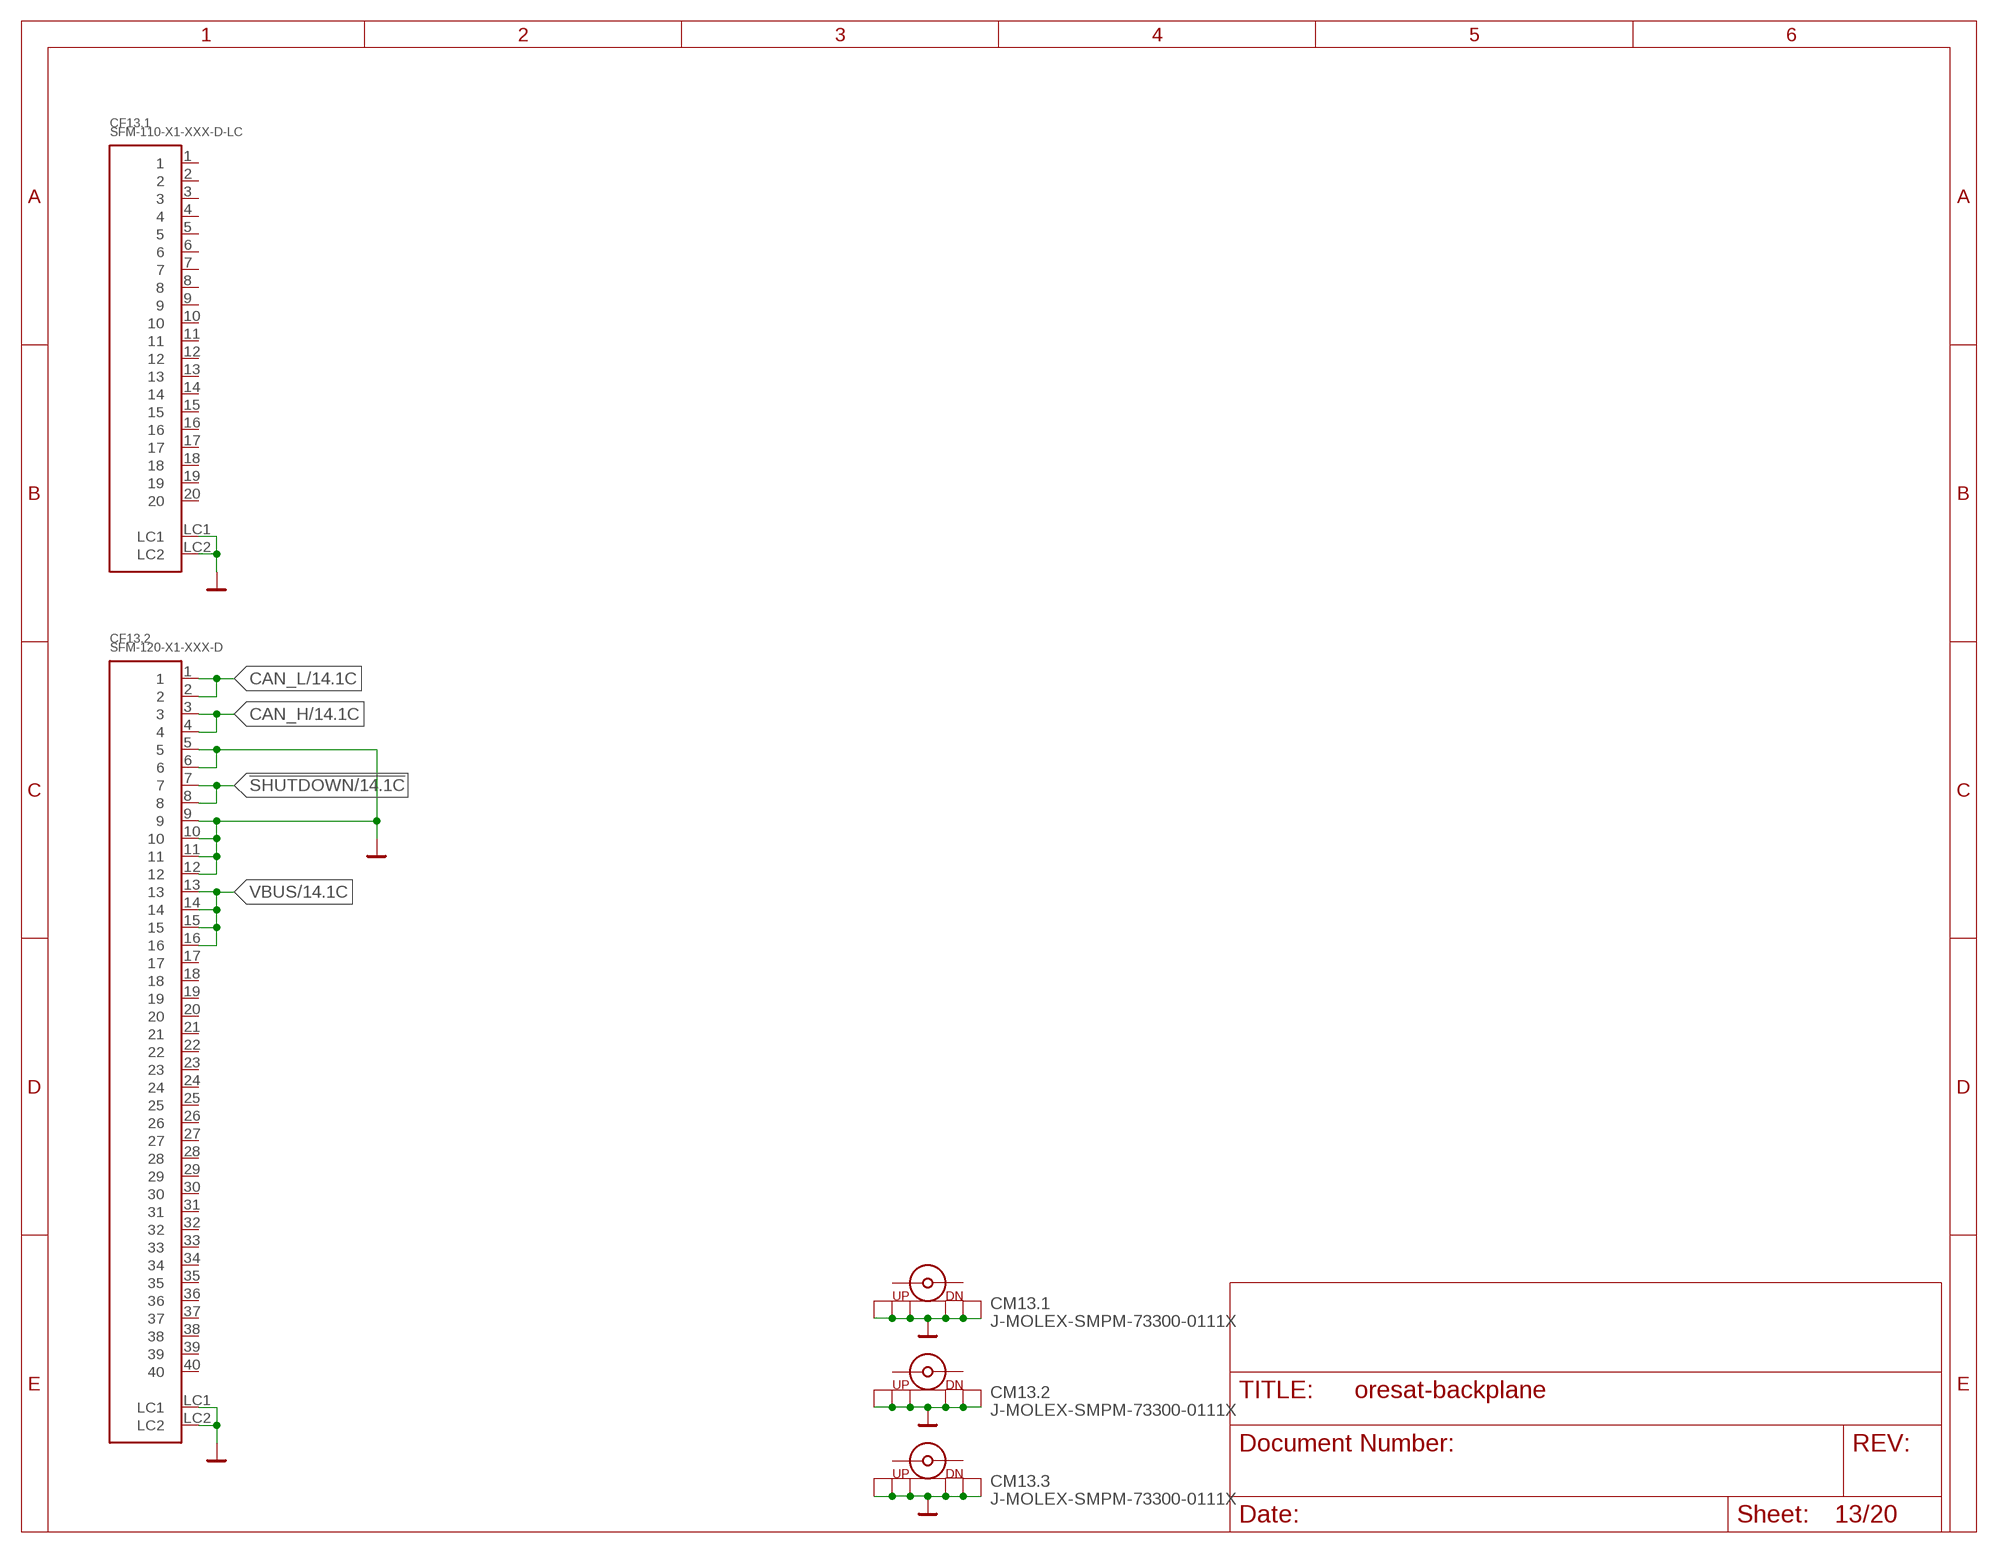
[diagram p12: schematic, sheet 13]

### Parts
CF13.1  SFM-110-X1-XXX-D-LC  [SFM-110-X1-XXX-D-LC]
CF13.2  SFM-120-X1-XXX-D  [SFM-120-X1-XXX-D]
CM13.1  J-MOLEX-SMPM-73300-0111X  [J-MOLEX-SMPM-73300-0111X]
CM13.2  J-MOLEX-SMPM-73300-0111X  [J-MOLEX-SMPM-73300-0111X]
CM13.3  J-MOLEX-SMPM-73300-0111X  [J-MOLEX-SMPM-73300-0111X]

### Nets
!SHUTDOWN: CF13.2.7 CF13.2.8 ; also sheet 1,2,3,4,5,6,7,8,9,10,11,12,14,15,16,17,18,19,20
CAN_H: CF13.2.3 CF13.2.4 ; also sheet 1,2,3,4,5,6,7,8,9,10,11,12,14,15,16,17,18,19,20
CAN_L: CF13.2.1 CF13.2.2 ; also sheet 1,2,3,4,5,6,7,8,9,10,11,12,14,15,16,17,18,19,20
GND: CF13.1.LC1 CF13.1.LC2 CF13.2.5 CF13.2.6 CF13.2.9 CF13.2.10 CF13.2.11 CF13.2.12 CF13.2.LC1 CF13.2.LC2 CM13.1.P$1(SHIELD) CM13.1.P$2(SHIELD1) CM13.1.P$3(SHIELD2) CM13.1.P$4(SHIELD3) CM13.1.P$5(SHIELD5) CM13.1.P$6(SHIELD4) CM13.2.P$1(SHIELD) CM13.2.P$2(SHIELD1) CM13.2.P$3(SHIELD2) CM13.2.P$4(SHIELD3) CM13.2.P$5(SHIELD5) CM13.2.P$6(SHIELD4) CM13.3.P$1(SHIELD) CM13.3.P$2(SHIELD1) CM13.3.P$3(SHIELD2) CM13.3.P$4(SHIELD3) CM13.3.P$5(SHIELD5) CM13.3.P$6(SHIELD4) ; also sheet 1,2,3,4,5,6,7,8,9,10,11,12,14,15,16,17,18,19,20
VBUS: CF13.2.13 CF13.2.14 CF13.2.15 CF13.2.16 ; also sheet 1,2,3,4,5,6,7,8,9,10,11,12,14,15,16,17,18,19,20
Unconnected: CF13.1.1 CF13.1.2 CF13.1.3 CF13.1.4 CF13.1.5 CF13.1.6 CF13.1.7 CF13.1.8 CF13.1.9 CF13.1.10 CF13.1.11 CF13.1.12 CF13.1.13 CF13.1.14 CF13.1.15 CF13.1.16 CF13.1.17 CF13.1.18 CF13.1.19 CF13.1.20 CF13.2.17 CF13.2.18 CF13.2.19 CF13.2.20 CF13.2.21 CF13.2.22 CF13.2.23 CF13.2.24 CF13.2.25 CF13.2.26 CF13.2.27 CF13.2.28 CF13.2.29 CF13.2.30 CF13.2.31 CF13.2.32 CF13.2.33 CF13.2.34 CF13.2.35 CF13.2.36 CF13.2.37 CF13.2.38 CF13.2.39 CF13.2.40 CM13.1.RF-DOWN CM13.1.RF-UP CM13.2.RF-DOWN CM13.2.RF-UP CM13.3.RF-DOWN CM13.3.RF-UP

## Sheet 14 of 20: Slot 14
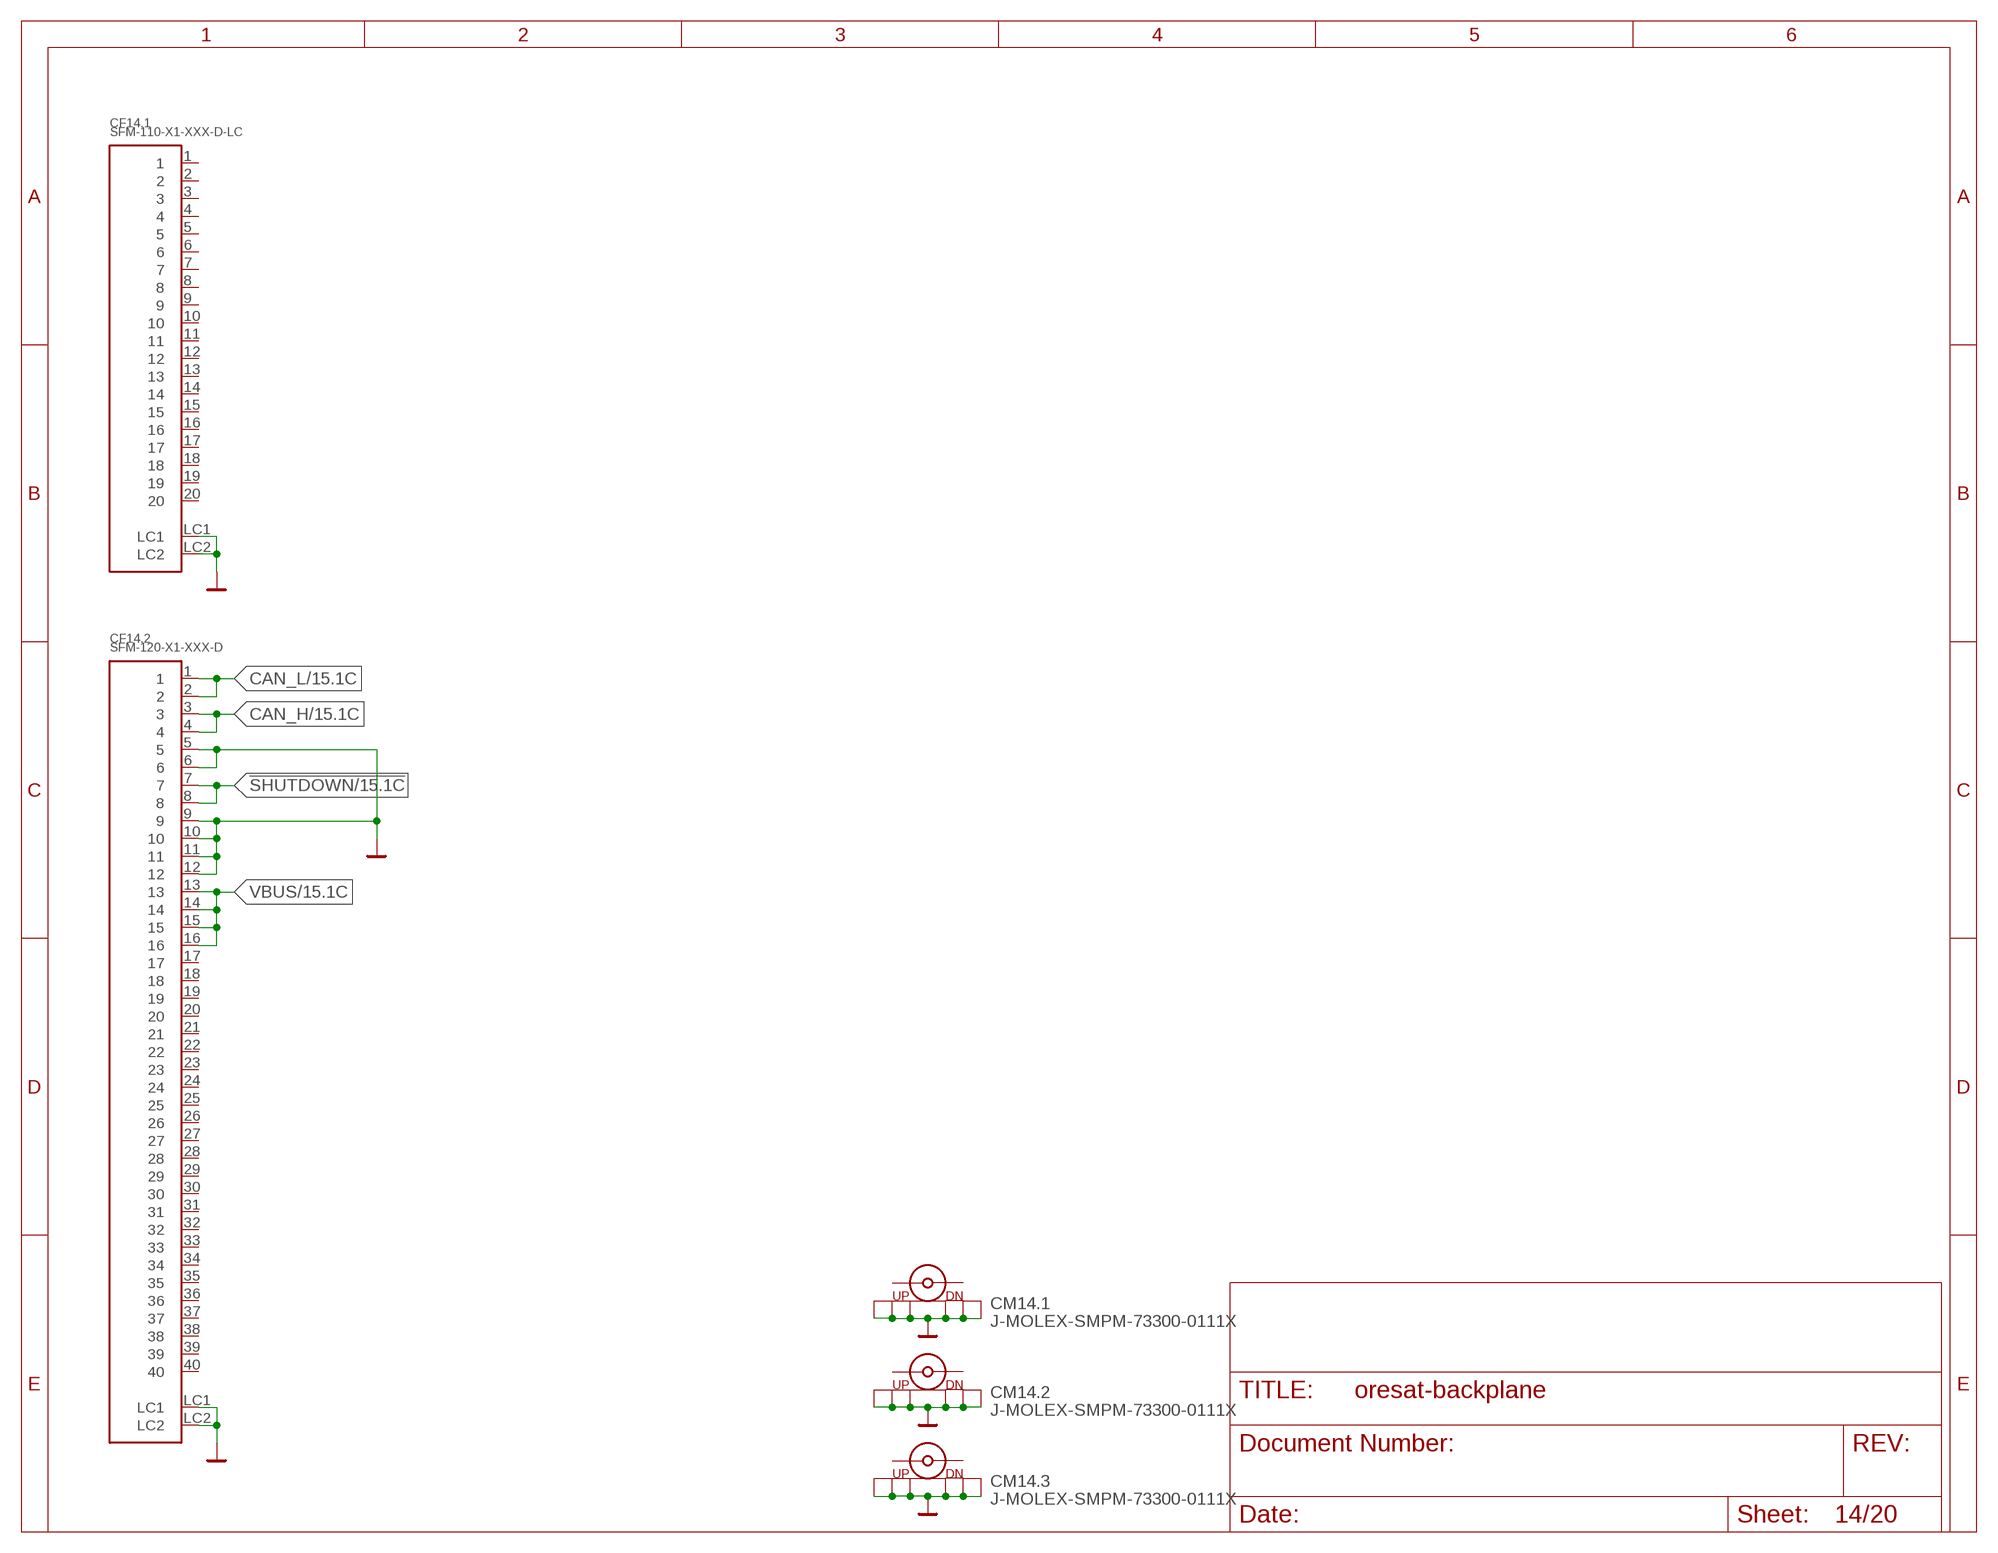
[diagram p13: schematic, sheet 14]

### Parts
CF14.1  SFM-110-X1-XXX-D-LC  [SFM-110-X1-XXX-D-LC]
CF14.2  SFM-120-X1-XXX-D  [SFM-120-X1-XXX-D]
CM14.1  J-MOLEX-SMPM-73300-0111X  [J-MOLEX-SMPM-73300-0111X]
CM14.2  J-MOLEX-SMPM-73300-0111X  [J-MOLEX-SMPM-73300-0111X]
CM14.3  J-MOLEX-SMPM-73300-0111X  [J-MOLEX-SMPM-73300-0111X]

### Nets
!SHUTDOWN: CF14.2.7 CF14.2.8 ; also sheet 1,2,3,4,5,6,7,8,9,10,11,12,13,15,16,17,18,19,20
CAN_H: CF14.2.3 CF14.2.4 ; also sheet 1,2,3,4,5,6,7,8,9,10,11,12,13,15,16,17,18,19,20
CAN_L: CF14.2.1 CF14.2.2 ; also sheet 1,2,3,4,5,6,7,8,9,10,11,12,13,15,16,17,18,19,20
GND: CF14.1.LC1 CF14.1.LC2 CF14.2.5 CF14.2.6 CF14.2.9 CF14.2.10 CF14.2.11 CF14.2.12 CF14.2.LC1 CF14.2.LC2 CM14.1.P$1(SHIELD) CM14.1.P$2(SHIELD1) CM14.1.P$3(SHIELD2) CM14.1.P$4(SHIELD3) CM14.1.P$5(SHIELD5) CM14.1.P$6(SHIELD4) CM14.2.P$1(SHIELD) CM14.2.P$2(SHIELD1) CM14.2.P$3(SHIELD2) CM14.2.P$4(SHIELD3) CM14.2.P$5(SHIELD5) CM14.2.P$6(SHIELD4) CM14.3.P$1(SHIELD) CM14.3.P$2(SHIELD1) CM14.3.P$3(SHIELD2) CM14.3.P$4(SHIELD3) CM14.3.P$5(SHIELD5) CM14.3.P$6(SHIELD4) ; also sheet 1,2,3,4,5,6,7,8,9,10,11,12,13,15,16,17,18,19,20
VBUS: CF14.2.13 CF14.2.14 CF14.2.15 CF14.2.16 ; also sheet 1,2,3,4,5,6,7,8,9,10,11,12,13,15,16,17,18,19,20
Unconnected: CF14.1.1 CF14.1.2 CF14.1.3 CF14.1.4 CF14.1.5 CF14.1.6 CF14.1.7 CF14.1.8 CF14.1.9 CF14.1.10 CF14.1.11 CF14.1.12 CF14.1.13 CF14.1.14 CF14.1.15 CF14.1.16 CF14.1.17 CF14.1.18 CF14.1.19 CF14.1.20 CF14.2.17 CF14.2.18 CF14.2.19 CF14.2.20 CF14.2.21 CF14.2.22 CF14.2.23 CF14.2.24 CF14.2.25 CF14.2.26 CF14.2.27 CF14.2.28 CF14.2.29 CF14.2.30 CF14.2.31 CF14.2.32 CF14.2.33 CF14.2.34 CF14.2.35 CF14.2.36 CF14.2.37 CF14.2.38 CF14.2.39 CF14.2.40 CM14.1.RF-DOWN CM14.1.RF-UP CM14.2.RF-DOWN CM14.2.RF-UP CM14.3.RF-DOWN CM14.3.RF-UP

## Sheet 15 of 20: Slot 15
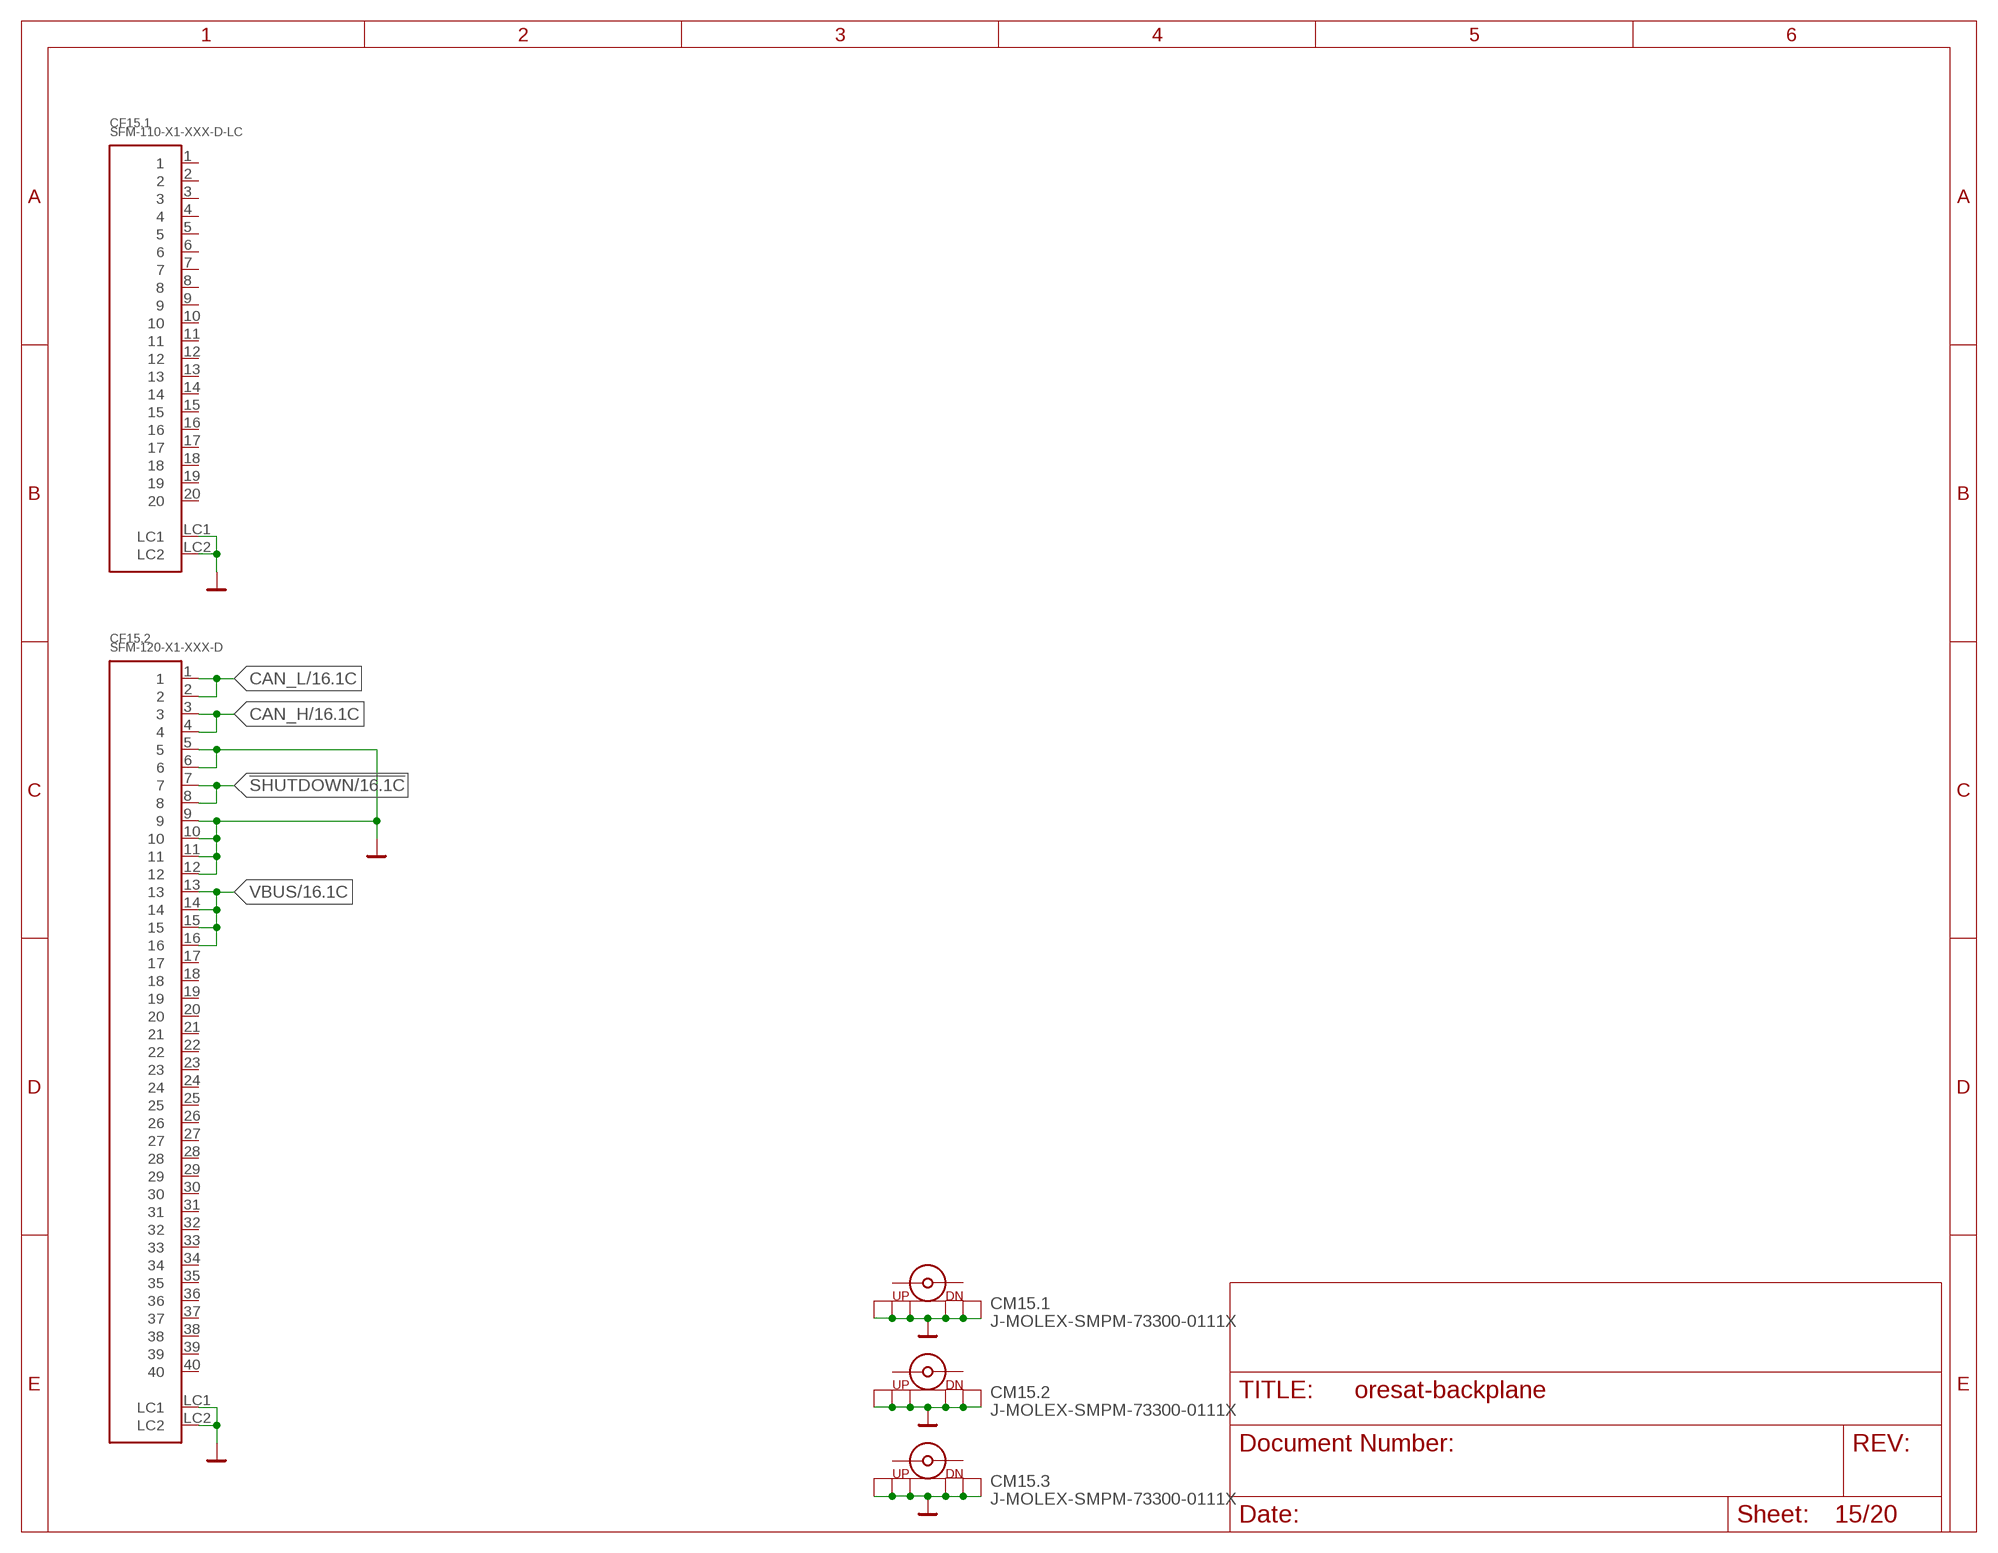
[diagram p14: schematic, sheet 15]

### Parts
CF15.1  SFM-110-X1-XXX-D-LC  [SFM-110-X1-XXX-D-LC]
CF15.2  SFM-120-X1-XXX-D  [SFM-120-X1-XXX-D]
CM15.1  J-MOLEX-SMPM-73300-0111X  [J-MOLEX-SMPM-73300-0111X]
CM15.2  J-MOLEX-SMPM-73300-0111X  [J-MOLEX-SMPM-73300-0111X]
CM15.3  J-MOLEX-SMPM-73300-0111X  [J-MOLEX-SMPM-73300-0111X]

### Nets
!SHUTDOWN: CF15.2.7 CF15.2.8 ; also sheet 1,2,3,4,5,6,7,8,9,10,11,12,13,14,16,17,18,19,20
CAN_H: CF15.2.3 CF15.2.4 ; also sheet 1,2,3,4,5,6,7,8,9,10,11,12,13,14,16,17,18,19,20
CAN_L: CF15.2.1 CF15.2.2 ; also sheet 1,2,3,4,5,6,7,8,9,10,11,12,13,14,16,17,18,19,20
GND: CF15.1.LC1 CF15.1.LC2 CF15.2.5 CF15.2.6 CF15.2.9 CF15.2.10 CF15.2.11 CF15.2.12 CF15.2.LC1 CF15.2.LC2 CM15.1.P$1(SHIELD) CM15.1.P$2(SHIELD1) CM15.1.P$3(SHIELD2) CM15.1.P$4(SHIELD3) CM15.1.P$5(SHIELD5) CM15.1.P$6(SHIELD4) CM15.2.P$1(SHIELD) CM15.2.P$2(SHIELD1) CM15.2.P$3(SHIELD2) CM15.2.P$4(SHIELD3) CM15.2.P$5(SHIELD5) CM15.2.P$6(SHIELD4) CM15.3.P$1(SHIELD) CM15.3.P$2(SHIELD1) CM15.3.P$3(SHIELD2) CM15.3.P$4(SHIELD3) CM15.3.P$5(SHIELD5) CM15.3.P$6(SHIELD4) ; also sheet 1,2,3,4,5,6,7,8,9,10,11,12,13,14,16,17,18,19,20
VBUS: CF15.2.13 CF15.2.14 CF15.2.15 CF15.2.16 ; also sheet 1,2,3,4,5,6,7,8,9,10,11,12,13,14,16,17,18,19,20
Unconnected: CF15.1.1 CF15.1.2 CF15.1.3 CF15.1.4 CF15.1.5 CF15.1.6 CF15.1.7 CF15.1.8 CF15.1.9 CF15.1.10 CF15.1.11 CF15.1.12 CF15.1.13 CF15.1.14 CF15.1.15 CF15.1.16 CF15.1.17 CF15.1.18 CF15.1.19 CF15.1.20 CF15.2.17 CF15.2.18 CF15.2.19 CF15.2.20 CF15.2.21 CF15.2.22 CF15.2.23 CF15.2.24 CF15.2.25 CF15.2.26 CF15.2.27 CF15.2.28 CF15.2.29 CF15.2.30 CF15.2.31 CF15.2.32 CF15.2.33 CF15.2.34 CF15.2.35 CF15.2.36 CF15.2.37 CF15.2.38 CF15.2.39 CF15.2.40 CM15.1.RF-DOWN CM15.1.RF-UP CM15.2.RF-DOWN CM15.2.RF-UP CM15.3.RF-DOWN CM15.3.RF-UP

## Sheet 16 of 20: Slot 16
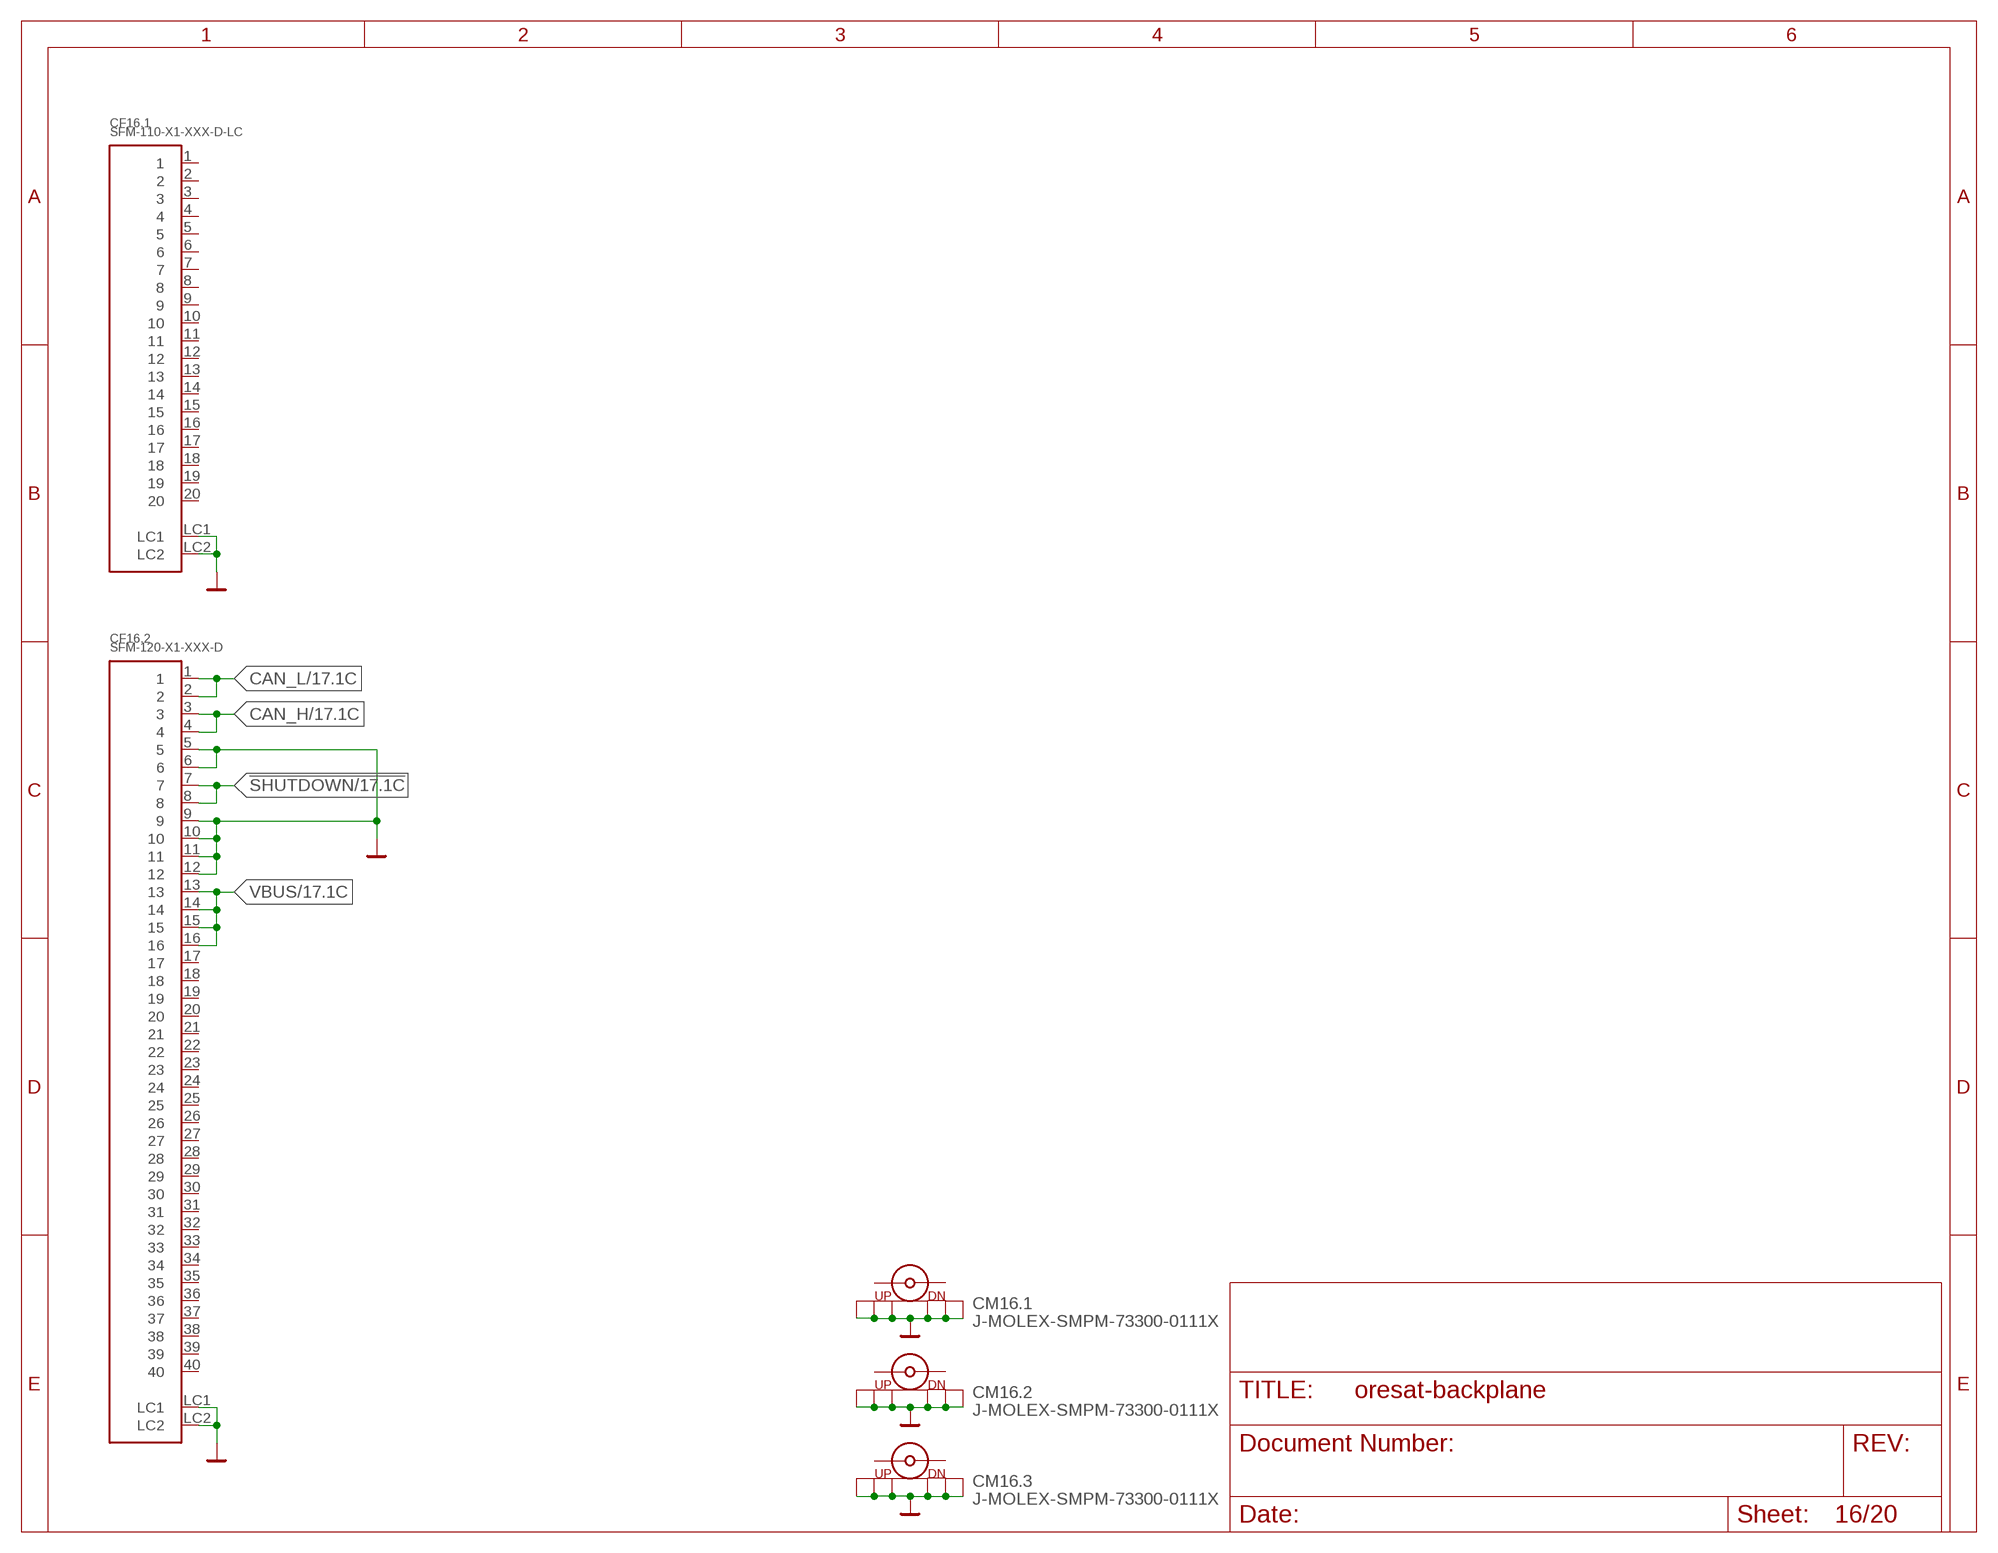
[diagram p15: schematic, sheet 16]

### Parts
CF16.1  SFM-110-X1-XXX-D-LC  [SFM-110-X1-XXX-D-LC]
CF16.2  SFM-120-X1-XXX-D  [SFM-120-X1-XXX-D]
CM16.1  J-MOLEX-SMPM-73300-0111X  [J-MOLEX-SMPM-73300-0111X]
CM16.2  J-MOLEX-SMPM-73300-0111X  [J-MOLEX-SMPM-73300-0111X]
CM16.3  J-MOLEX-SMPM-73300-0111X  [J-MOLEX-SMPM-73300-0111X]

### Nets
!SHUTDOWN: CF16.2.7 CF16.2.8 ; also sheet 1,2,3,4,5,6,7,8,9,10,11,12,13,14,15,17,18,19,20
CAN_H: CF16.2.3 CF16.2.4 ; also sheet 1,2,3,4,5,6,7,8,9,10,11,12,13,14,15,17,18,19,20
CAN_L: CF16.2.1 CF16.2.2 ; also sheet 1,2,3,4,5,6,7,8,9,10,11,12,13,14,15,17,18,19,20
GND: CF16.1.LC1 CF16.1.LC2 CF16.2.5 CF16.2.6 CF16.2.9 CF16.2.10 CF16.2.11 CF16.2.12 CF16.2.LC1 CF16.2.LC2 CM16.1.P$1(SHIELD) CM16.1.P$2(SHIELD1) CM16.1.P$3(SHIELD2) CM16.1.P$4(SHIELD3) CM16.1.P$5(SHIELD5) CM16.1.P$6(SHIELD4) CM16.2.P$1(SHIELD) CM16.2.P$2(SHIELD1) CM16.2.P$3(SHIELD2) CM16.2.P$4(SHIELD3) CM16.2.P$5(SHIELD5) CM16.2.P$6(SHIELD4) CM16.3.P$1(SHIELD) CM16.3.P$2(SHIELD1) CM16.3.P$3(SHIELD2) CM16.3.P$4(SHIELD3) CM16.3.P$5(SHIELD5) CM16.3.P$6(SHIELD4) ; also sheet 1,2,3,4,5,6,7,8,9,10,11,12,13,14,15,17,18,19,20
VBUS: CF16.2.13 CF16.2.14 CF16.2.15 CF16.2.16 ; also sheet 1,2,3,4,5,6,7,8,9,10,11,12,13,14,15,17,18,19,20
Unconnected: CF16.1.1 CF16.1.2 CF16.1.3 CF16.1.4 CF16.1.5 CF16.1.6 CF16.1.7 CF16.1.8 CF16.1.9 CF16.1.10 CF16.1.11 CF16.1.12 CF16.1.13 CF16.1.14 CF16.1.15 CF16.1.16 CF16.1.17 CF16.1.18 CF16.1.19 CF16.1.20 CF16.2.17 CF16.2.18 CF16.2.19 CF16.2.20 CF16.2.21 CF16.2.22 CF16.2.23 CF16.2.24 CF16.2.25 CF16.2.26 CF16.2.27 CF16.2.28 CF16.2.29 CF16.2.30 CF16.2.31 CF16.2.32 CF16.2.33 CF16.2.34 CF16.2.35 CF16.2.36 CF16.2.37 CF16.2.38 CF16.2.39 CF16.2.40 CM16.1.RF-DOWN CM16.1.RF-UP CM16.2.RF-DOWN CM16.2.RF-UP CM16.3.RF-DOWN CM16.3.RF-UP

## Sheet 17 of 20: Slot 17
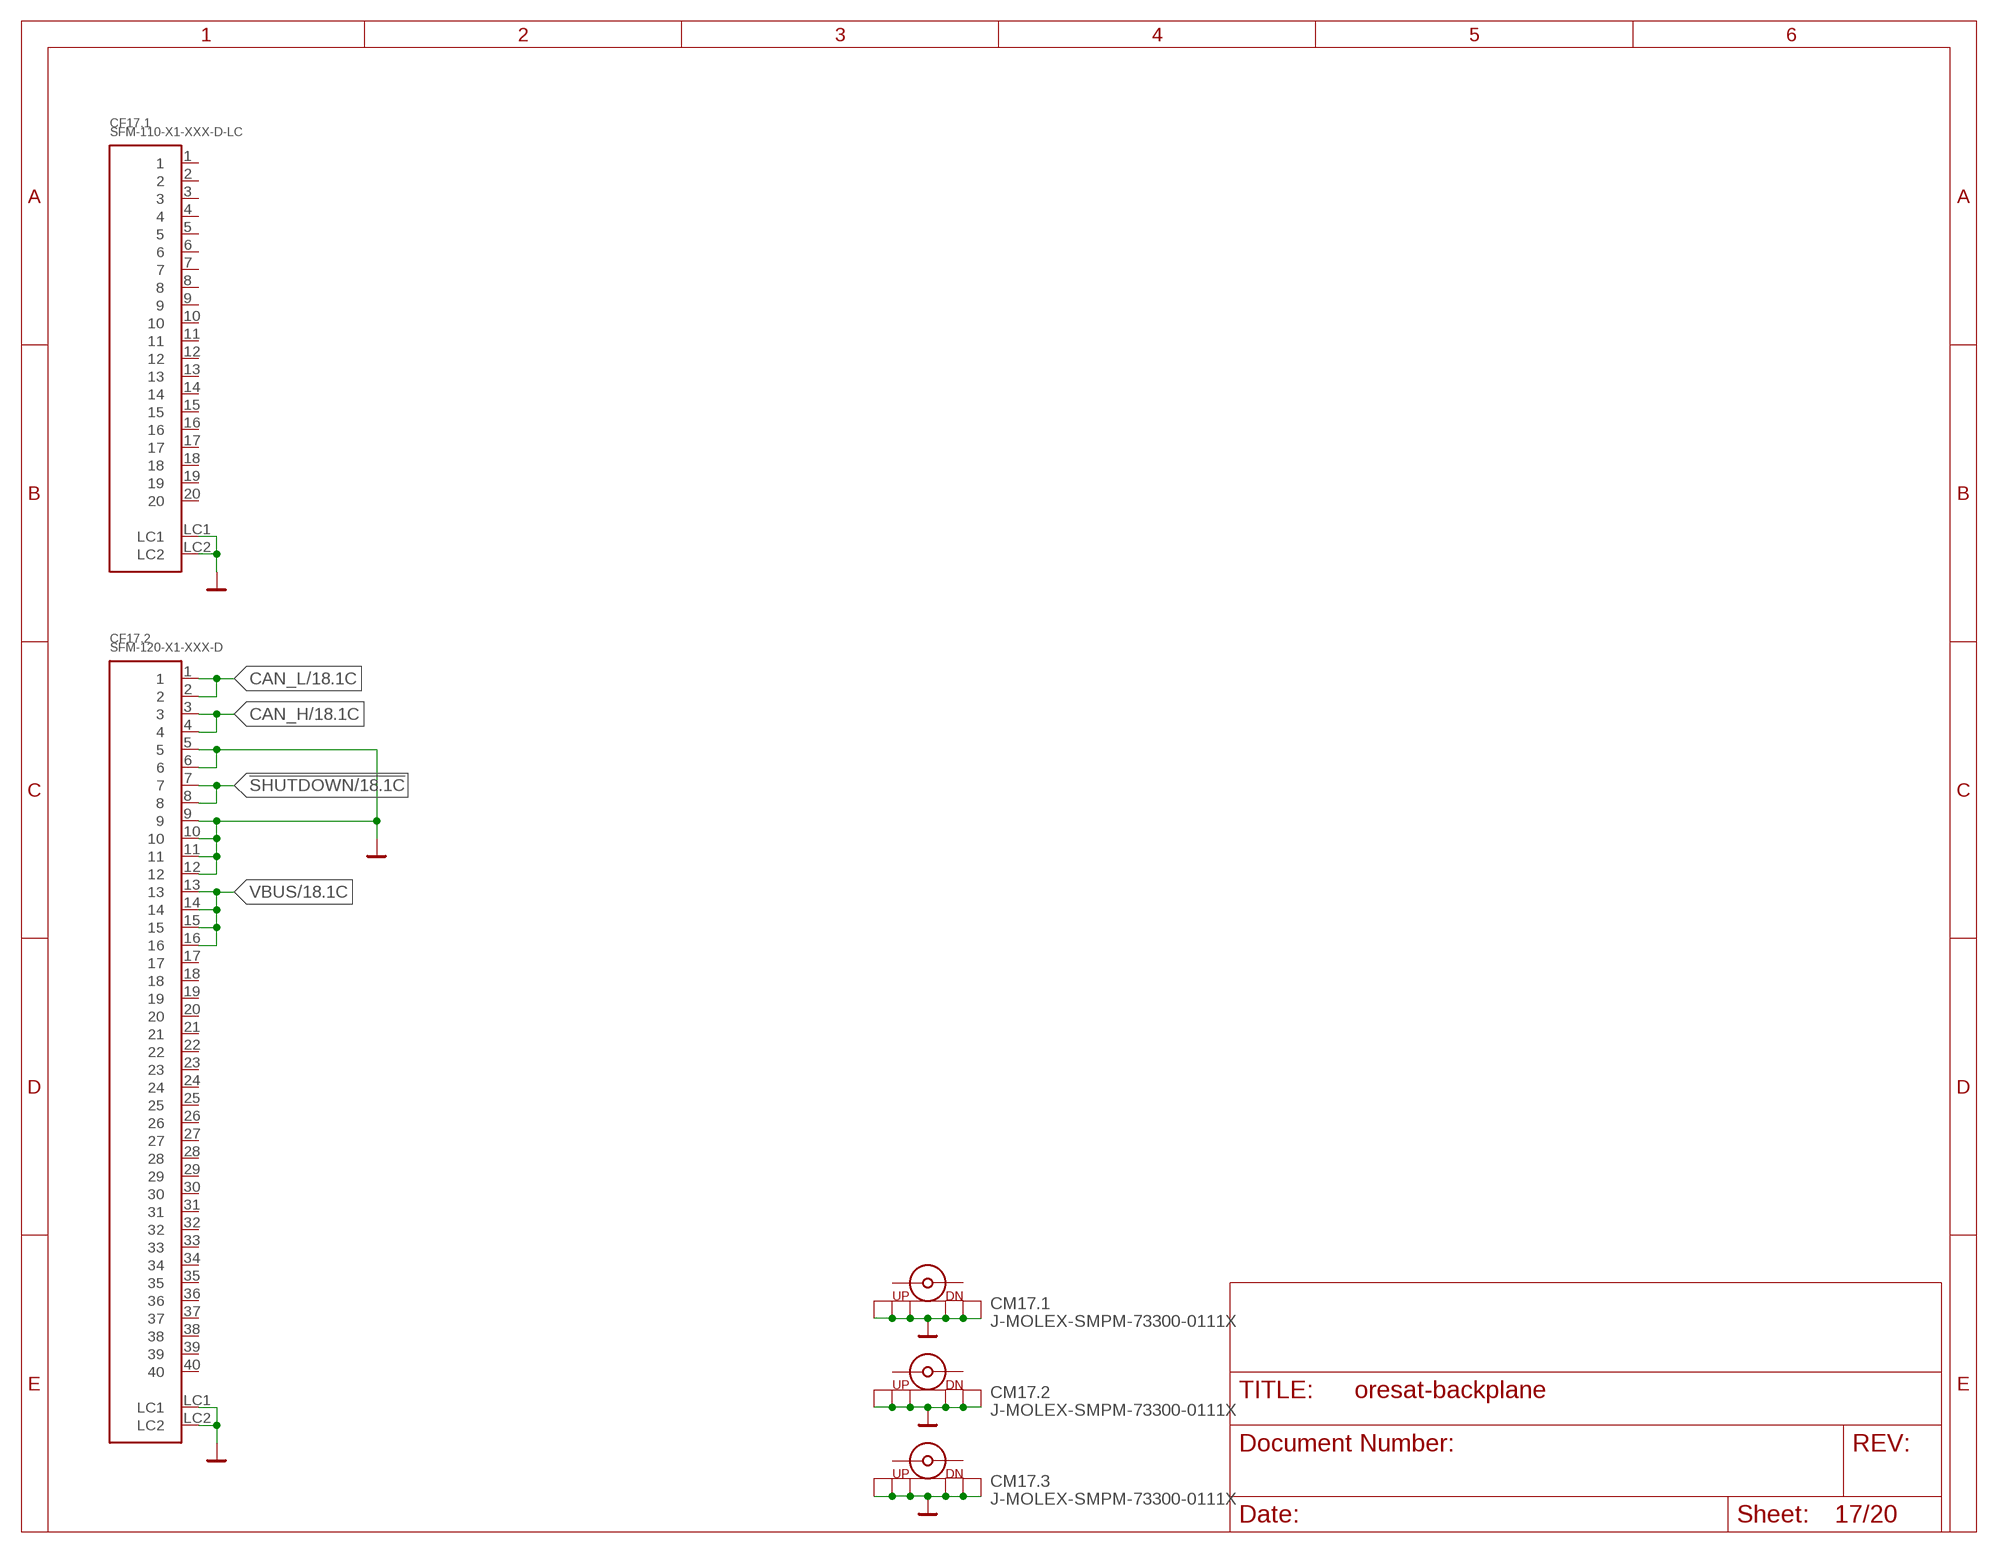
[diagram p16: schematic, sheet 17]

### Parts
CF17.1  SFM-110-X1-XXX-D-LC  [SFM-110-X1-XXX-D-LC]
CF17.2  SFM-120-X1-XXX-D  [SFM-120-X1-XXX-D]
CM17.1  J-MOLEX-SMPM-73300-0111X  [J-MOLEX-SMPM-73300-0111X]
CM17.2  J-MOLEX-SMPM-73300-0111X  [J-MOLEX-SMPM-73300-0111X]
CM17.3  J-MOLEX-SMPM-73300-0111X  [J-MOLEX-SMPM-73300-0111X]

### Nets
!SHUTDOWN: CF17.2.7 CF17.2.8 ; also sheet 1,2,3,4,5,6,7,8,9,10,11,12,13,14,15,16,18,19,20
CAN_H: CF17.2.3 CF17.2.4 ; also sheet 1,2,3,4,5,6,7,8,9,10,11,12,13,14,15,16,18,19,20
CAN_L: CF17.2.1 CF17.2.2 ; also sheet 1,2,3,4,5,6,7,8,9,10,11,12,13,14,15,16,18,19,20
GND: CF17.1.LC1 CF17.1.LC2 CF17.2.5 CF17.2.6 CF17.2.9 CF17.2.10 CF17.2.11 CF17.2.12 CF17.2.LC1 CF17.2.LC2 CM17.1.P$1(SHIELD) CM17.1.P$2(SHIELD1) CM17.1.P$3(SHIELD2) CM17.1.P$4(SHIELD3) CM17.1.P$5(SHIELD5) CM17.1.P$6(SHIELD4) CM17.2.P$1(SHIELD) CM17.2.P$2(SHIELD1) CM17.2.P$3(SHIELD2) CM17.2.P$4(SHIELD3) CM17.2.P$5(SHIELD5) CM17.2.P$6(SHIELD4) CM17.3.P$1(SHIELD) CM17.3.P$2(SHIELD1) CM17.3.P$3(SHIELD2) CM17.3.P$4(SHIELD3) CM17.3.P$5(SHIELD5) CM17.3.P$6(SHIELD4) ; also sheet 1,2,3,4,5,6,7,8,9,10,11,12,13,14,15,16,18,19,20
VBUS: CF17.2.13 CF17.2.14 CF17.2.15 CF17.2.16 ; also sheet 1,2,3,4,5,6,7,8,9,10,11,12,13,14,15,16,18,19,20
Unconnected: CF17.1.1 CF17.1.2 CF17.1.3 CF17.1.4 CF17.1.5 CF17.1.6 CF17.1.7 CF17.1.8 CF17.1.9 CF17.1.10 CF17.1.11 CF17.1.12 CF17.1.13 CF17.1.14 CF17.1.15 CF17.1.16 CF17.1.17 CF17.1.18 CF17.1.19 CF17.1.20 CF17.2.17 CF17.2.18 CF17.2.19 CF17.2.20 CF17.2.21 CF17.2.22 CF17.2.23 CF17.2.24 CF17.2.25 CF17.2.26 CF17.2.27 CF17.2.28 CF17.2.29 CF17.2.30 CF17.2.31 CF17.2.32 CF17.2.33 CF17.2.34 CF17.2.35 CF17.2.36 CF17.2.37 CF17.2.38 CF17.2.39 CF17.2.40 CM17.1.RF-DOWN CM17.1.RF-UP CM17.2.RF-DOWN CM17.2.RF-UP CM17.3.RF-DOWN CM17.3.RF-UP

## Sheet 18 of 20: Slot 18
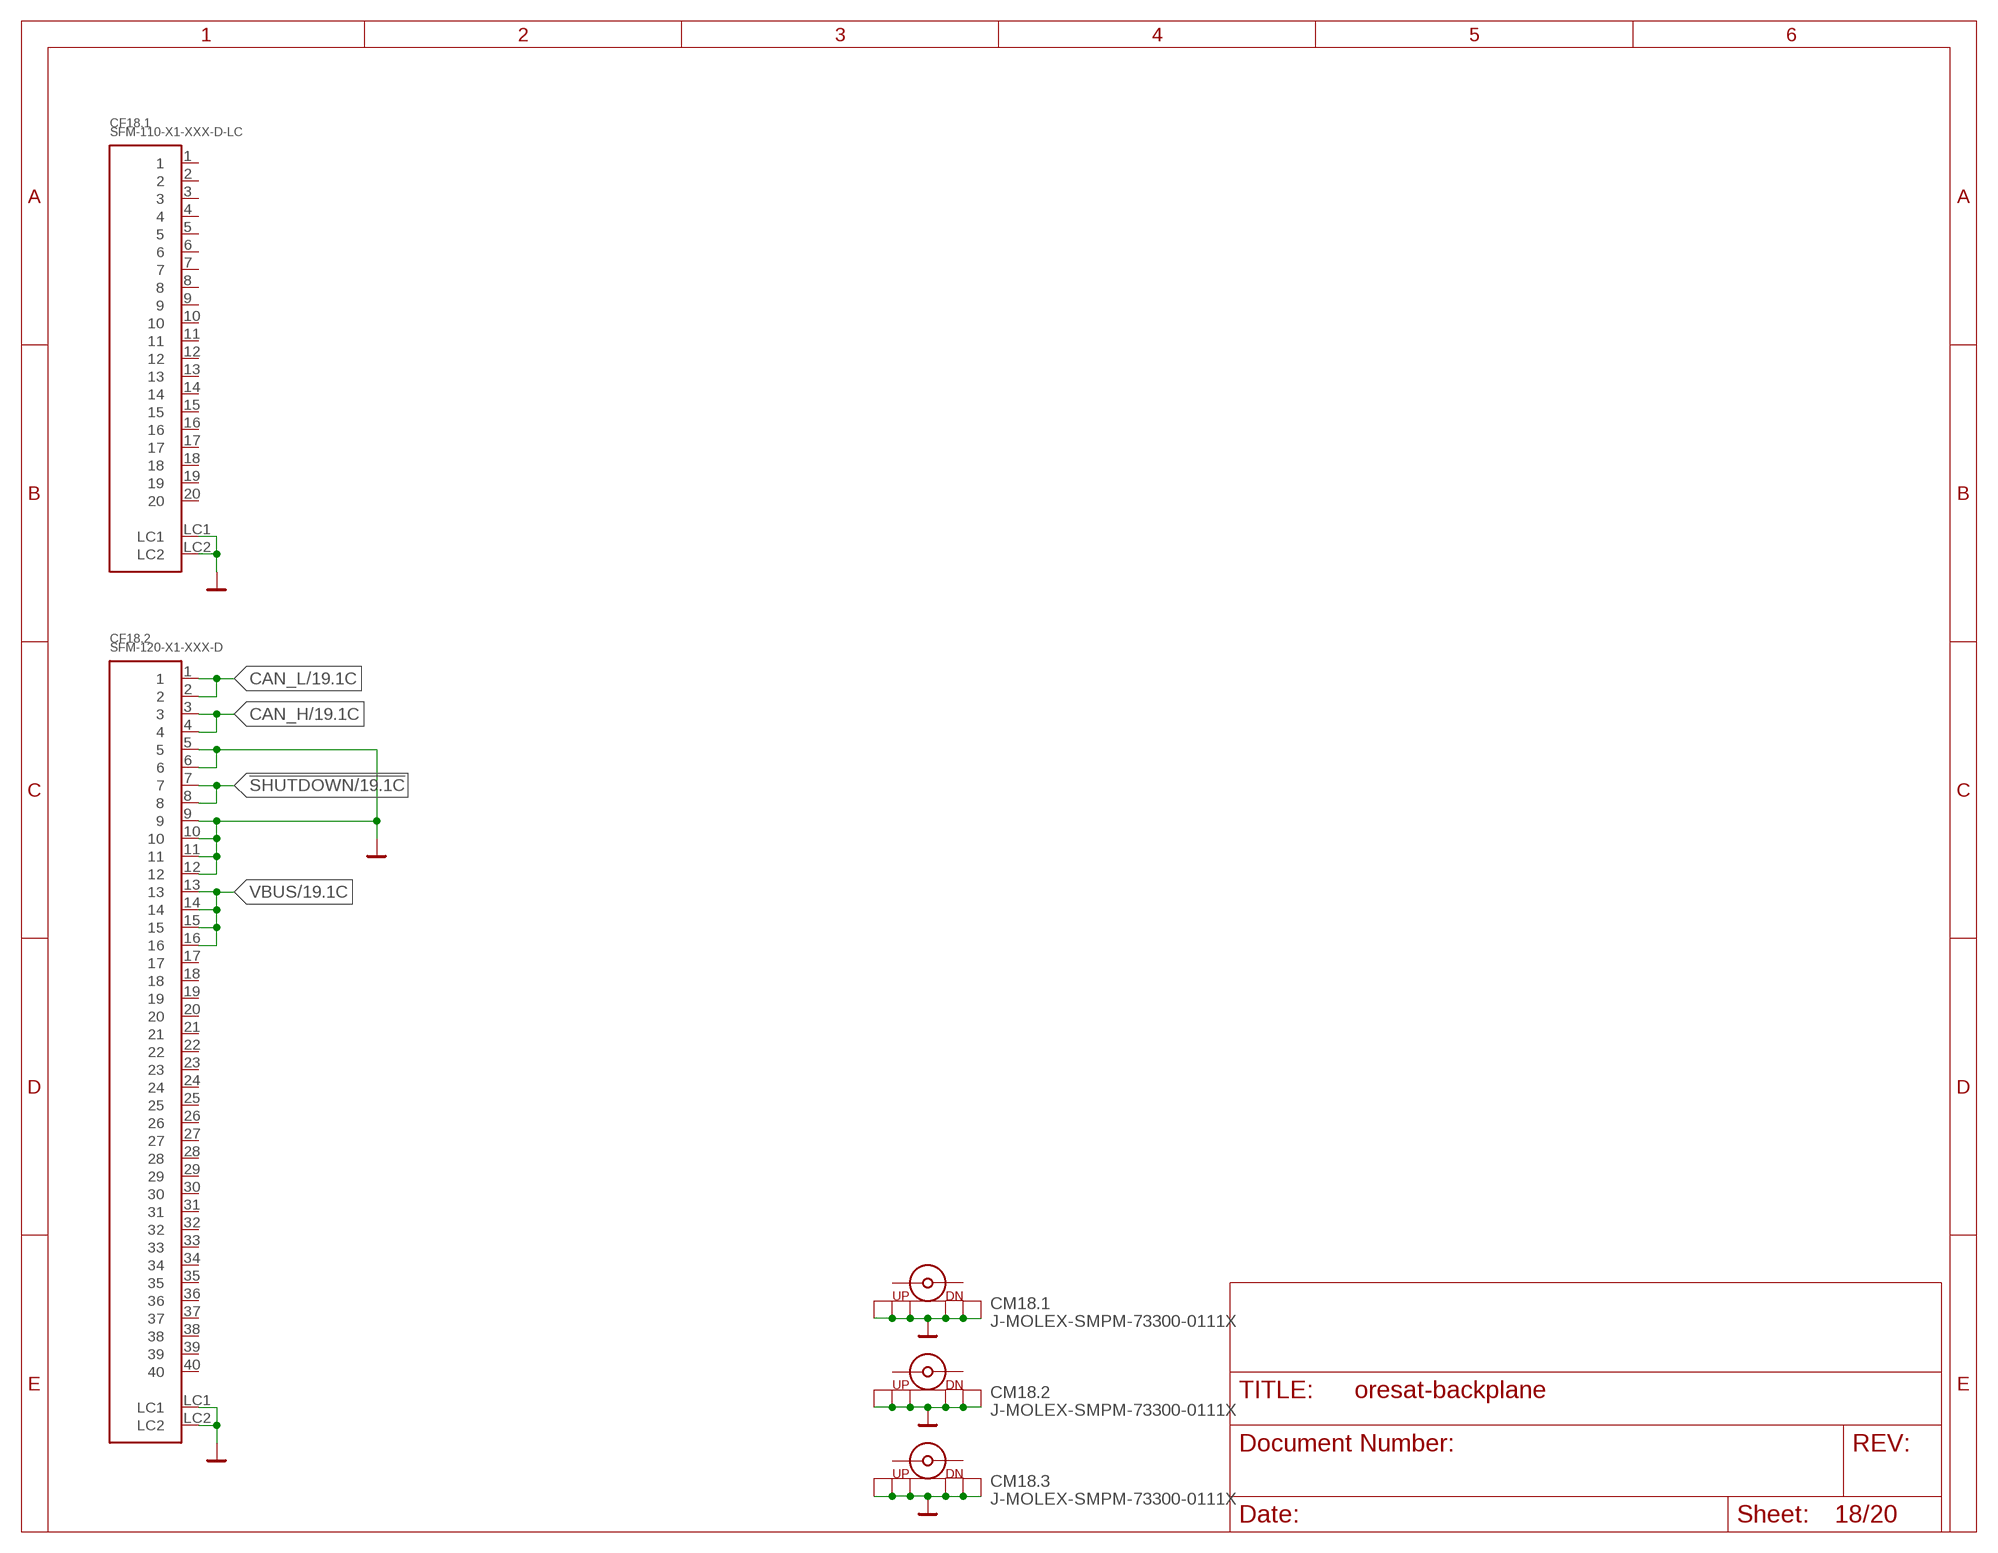
[diagram p17: schematic, sheet 18]

### Parts
CF18.1  SFM-110-X1-XXX-D-LC  [SFM-110-X1-XXX-D-LC]
CF18.2  SFM-120-X1-XXX-D  [SFM-120-X1-XXX-D]
CM18.1  J-MOLEX-SMPM-73300-0111X  [J-MOLEX-SMPM-73300-0111X]
CM18.2  J-MOLEX-SMPM-73300-0111X  [J-MOLEX-SMPM-73300-0111X]
CM18.3  J-MOLEX-SMPM-73300-0111X  [J-MOLEX-SMPM-73300-0111X]

### Nets
!SHUTDOWN: CF18.2.7 CF18.2.8 ; also sheet 1,2,3,4,5,6,7,8,9,10,11,12,13,14,15,16,17,19,20
CAN_H: CF18.2.3 CF18.2.4 ; also sheet 1,2,3,4,5,6,7,8,9,10,11,12,13,14,15,16,17,19,20
CAN_L: CF18.2.1 CF18.2.2 ; also sheet 1,2,3,4,5,6,7,8,9,10,11,12,13,14,15,16,17,19,20
GND: CF18.1.LC1 CF18.1.LC2 CF18.2.5 CF18.2.6 CF18.2.9 CF18.2.10 CF18.2.11 CF18.2.12 CF18.2.LC1 CF18.2.LC2 CM18.1.P$1(SHIELD) CM18.1.P$2(SHIELD1) CM18.1.P$3(SHIELD2) CM18.1.P$4(SHIELD3) CM18.1.P$5(SHIELD5) CM18.1.P$6(SHIELD4) CM18.2.P$1(SHIELD) CM18.2.P$2(SHIELD1) CM18.2.P$3(SHIELD2) CM18.2.P$4(SHIELD3) CM18.2.P$5(SHIELD5) CM18.2.P$6(SHIELD4) CM18.3.P$1(SHIELD) CM18.3.P$2(SHIELD1) CM18.3.P$3(SHIELD2) CM18.3.P$4(SHIELD3) CM18.3.P$5(SHIELD5) CM18.3.P$6(SHIELD4) ; also sheet 1,2,3,4,5,6,7,8,9,10,11,12,13,14,15,16,17,19,20
VBUS: CF18.2.13 CF18.2.14 CF18.2.15 CF18.2.16 ; also sheet 1,2,3,4,5,6,7,8,9,10,11,12,13,14,15,16,17,19,20
Unconnected: CF18.1.1 CF18.1.2 CF18.1.3 CF18.1.4 CF18.1.5 CF18.1.6 CF18.1.7 CF18.1.8 CF18.1.9 CF18.1.10 CF18.1.11 CF18.1.12 CF18.1.13 CF18.1.14 CF18.1.15 CF18.1.16 CF18.1.17 CF18.1.18 CF18.1.19 CF18.1.20 CF18.2.17 CF18.2.18 CF18.2.19 CF18.2.20 CF18.2.21 CF18.2.22 CF18.2.23 CF18.2.24 CF18.2.25 CF18.2.26 CF18.2.27 CF18.2.28 CF18.2.29 CF18.2.30 CF18.2.31 CF18.2.32 CF18.2.33 CF18.2.34 CF18.2.35 CF18.2.36 CF18.2.37 CF18.2.38 CF18.2.39 CF18.2.40 CM18.1.RF-DOWN CM18.1.RF-UP CM18.2.RF-DOWN CM18.2.RF-UP CM18.3.RF-DOWN CM18.3.RF-UP

## Sheet 19 of 20: Slot 19
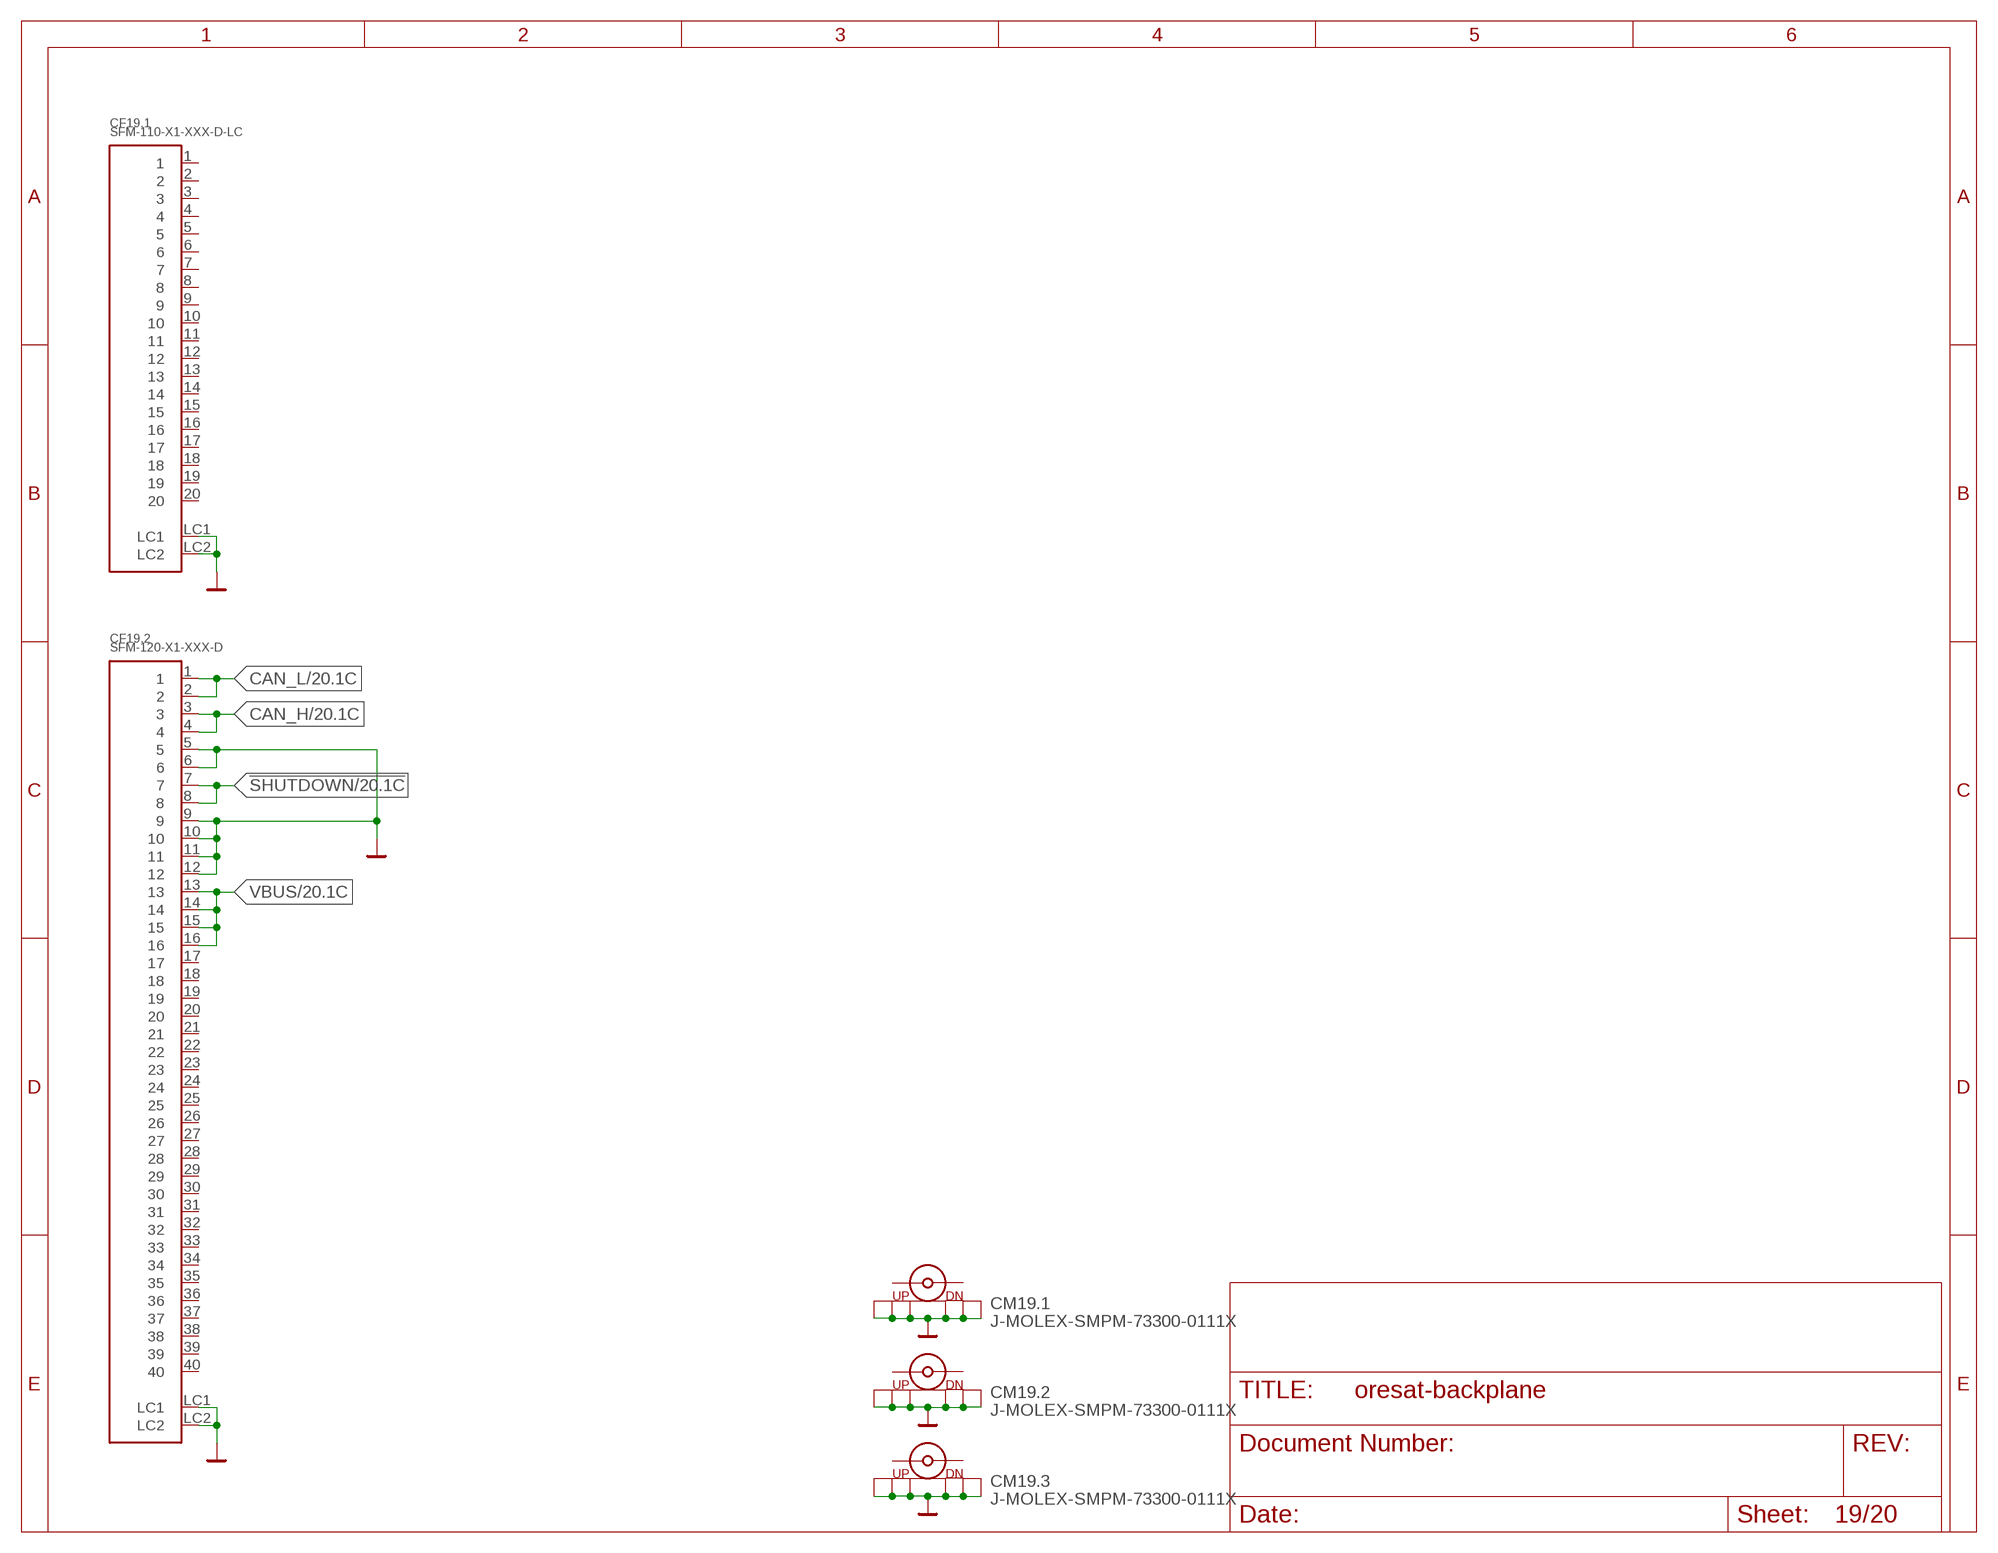
[diagram p18: schematic, sheet 19]

### Parts
CF19.1  SFM-110-X1-XXX-D-LC  [SFM-110-X1-XXX-D-LC]
CF19.2  SFM-120-X1-XXX-D  [SFM-120-X1-XXX-D]
CM19.1  J-MOLEX-SMPM-73300-0111X  [J-MOLEX-SMPM-73300-0111X]
CM19.2  J-MOLEX-SMPM-73300-0111X  [J-MOLEX-SMPM-73300-0111X]
CM19.3  J-MOLEX-SMPM-73300-0111X  [J-MOLEX-SMPM-73300-0111X]

### Nets
!SHUTDOWN: CF19.2.7 CF19.2.8 ; also sheet 1,2,3,4,5,6,7,8,9,10,11,12,13,14,15,16,17,18,20
CAN_H: CF19.2.3 CF19.2.4 ; also sheet 1,2,3,4,5,6,7,8,9,10,11,12,13,14,15,16,17,18,20
CAN_L: CF19.2.1 CF19.2.2 ; also sheet 1,2,3,4,5,6,7,8,9,10,11,12,13,14,15,16,17,18,20
GND: CF19.1.LC1 CF19.1.LC2 CF19.2.5 CF19.2.6 CF19.2.9 CF19.2.10 CF19.2.11 CF19.2.12 CF19.2.LC1 CF19.2.LC2 CM19.1.P$1(SHIELD) CM19.1.P$2(SHIELD1) CM19.1.P$3(SHIELD2) CM19.1.P$4(SHIELD3) CM19.1.P$5(SHIELD5) CM19.1.P$6(SHIELD4) CM19.2.P$1(SHIELD) CM19.2.P$2(SHIELD1) CM19.2.P$3(SHIELD2) CM19.2.P$4(SHIELD3) CM19.2.P$5(SHIELD5) CM19.2.P$6(SHIELD4) CM19.3.P$1(SHIELD) CM19.3.P$2(SHIELD1) CM19.3.P$3(SHIELD2) CM19.3.P$4(SHIELD3) CM19.3.P$5(SHIELD5) CM19.3.P$6(SHIELD4) ; also sheet 1,2,3,4,5,6,7,8,9,10,11,12,13,14,15,16,17,18,20
VBUS: CF19.2.13 CF19.2.14 CF19.2.15 CF19.2.16 ; also sheet 1,2,3,4,5,6,7,8,9,10,11,12,13,14,15,16,17,18,20
Unconnected: CF19.1.1 CF19.1.2 CF19.1.3 CF19.1.4 CF19.1.5 CF19.1.6 CF19.1.7 CF19.1.8 CF19.1.9 CF19.1.10 CF19.1.11 CF19.1.12 CF19.1.13 CF19.1.14 CF19.1.15 CF19.1.16 CF19.1.17 CF19.1.18 CF19.1.19 CF19.1.20 CF19.2.17 CF19.2.18 CF19.2.19 CF19.2.20 CF19.2.21 CF19.2.22 CF19.2.23 CF19.2.24 CF19.2.25 CF19.2.26 CF19.2.27 CF19.2.28 CF19.2.29 CF19.2.30 CF19.2.31 CF19.2.32 CF19.2.33 CF19.2.34 CF19.2.35 CF19.2.36 CF19.2.37 CF19.2.38 CF19.2.39 CF19.2.40 CM19.1.RF-DOWN CM19.1.RF-UP CM19.2.RF-DOWN CM19.2.RF-UP CM19.3.RF-DOWN CM19.3.RF-UP

## Sheet 20 of 20: Slot 20
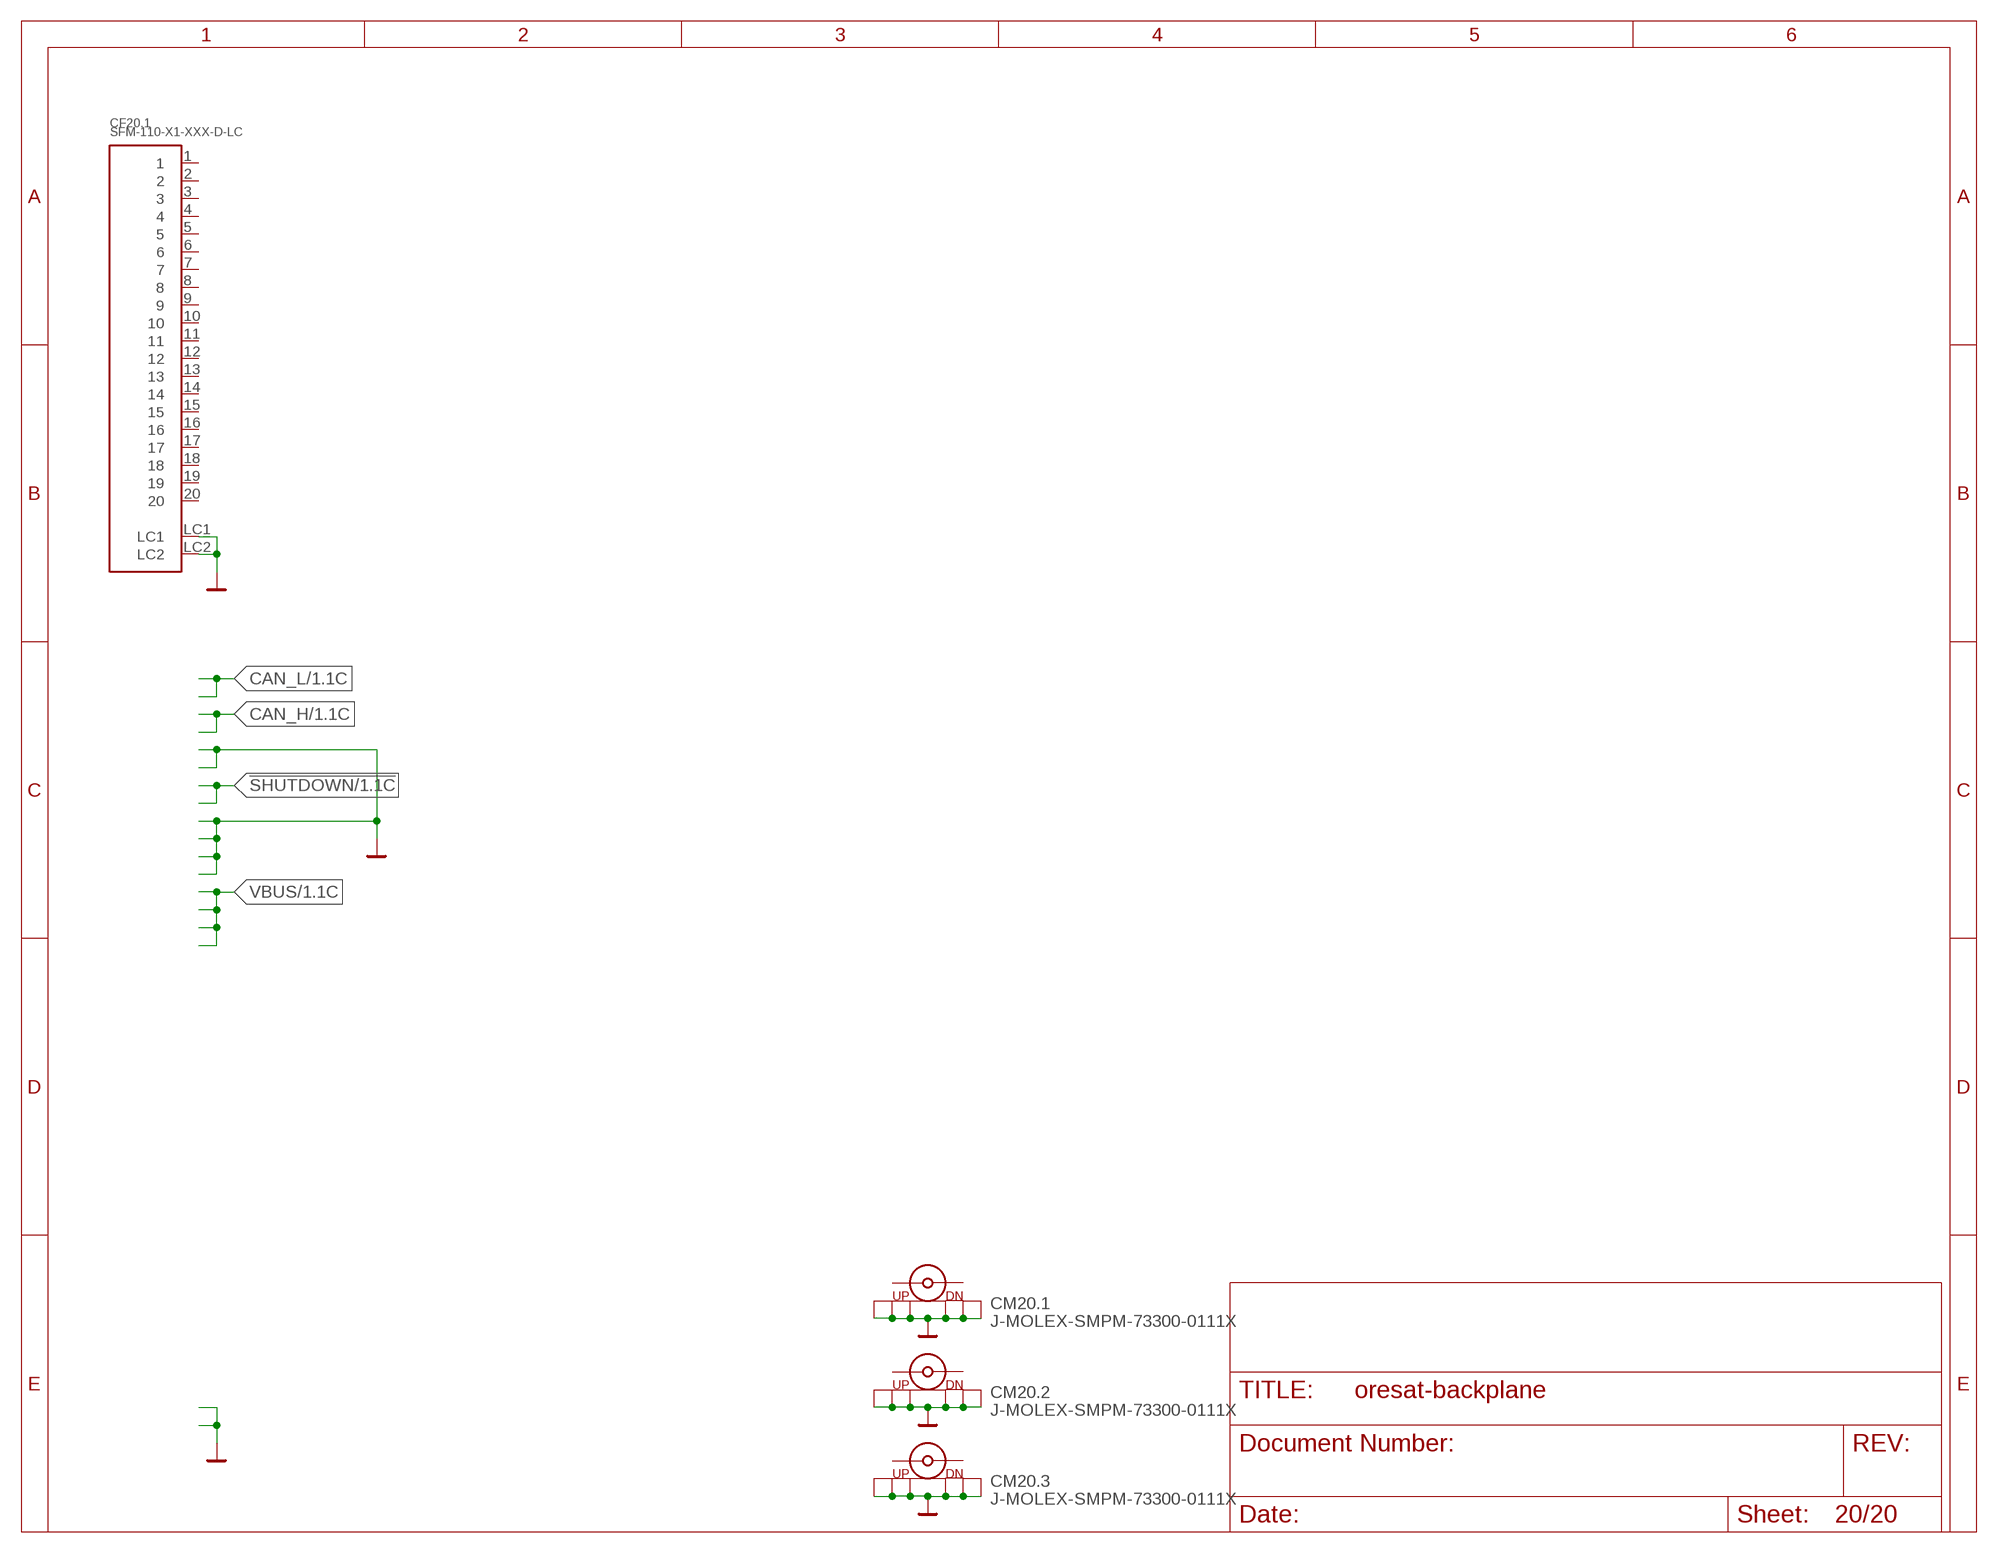
[diagram p19: schematic, sheet 20]

### Parts
CF20.1  SFM-110-X1-XXX-D-LC  [SFM-110-X1-XXX-D-LC]
CM20.1  J-MOLEX-SMPM-73300-0111X  [J-MOLEX-SMPM-73300-0111X]
CM20.2  J-MOLEX-SMPM-73300-0111X  [J-MOLEX-SMPM-73300-0111X]
CM20.3  J-MOLEX-SMPM-73300-0111X  [J-MOLEX-SMPM-73300-0111X]

### Nets
GND: CF20.1.LC1 CF20.1.LC2 CM20.1.P$1(SHIELD) CM20.1.P$2(SHIELD1) CM20.1.P$3(SHIELD2) CM20.1.P$4(SHIELD3) CM20.1.P$5(SHIELD5) CM20.1.P$6(SHIELD4) CM20.2.P$1(SHIELD) CM20.2.P$2(SHIELD1) CM20.2.P$3(SHIELD2) CM20.2.P$4(SHIELD3) CM20.2.P$5(SHIELD5) CM20.2.P$6(SHIELD4) CM20.3.P$1(SHIELD) CM20.3.P$2(SHIELD1) CM20.3.P$3(SHIELD2) CM20.3.P$4(SHIELD3) CM20.3.P$5(SHIELD5) CM20.3.P$6(SHIELD4) ; also sheet 1,2,3,4,5,6,7,8,9,10,11,12,13,14,15,16,17,18,19
Unconnected: CF20.1.1 CF20.1.2 CF20.1.3 CF20.1.4 CF20.1.5 CF20.1.6 CF20.1.7 CF20.1.8 CF20.1.9 CF20.1.10 CF20.1.11 CF20.1.12 CF20.1.13 CF20.1.14 CF20.1.15 CF20.1.16 CF20.1.17 CF20.1.18 CF20.1.19 CF20.1.20 CM20.1.RF-DOWN CM20.1.RF-UP CM20.2.RF-DOWN CM20.2.RF-UP CM20.3.RF-DOWN CM20.3.RF-UP

## Library data of the parts
CF1.1 CF2.1 CF3.1 CF4.1 CF5.1 CF6.1 CF7.1 CF8.1 CF9.1 CF10.1 CF11.1 CF12.1 CF13.1 CF14.1 CF15.1 CF16.1 CF17.1 CF18.1 CF19.1 CF20.1 = J-Samtec-SFM-110-X1-XXX-D-LC:SFM-110-X1-XXX-D-LC: 0.05"X0.05" SOCKET STRIP DOUBLE ROW ASSEMBLY. MANUFACTURER: SAMTEC.
CF2.2 CF3.2 CF4.2 CF5.2 CF6.2 CF7.2 CF8.2 CF9.2 CF10.2 CF11.2 CF12.2 CF13.2 CF14.2 CF15.2 CF16.2 CF17.2 CF18.2 CF19.2 = J-Samtec-SFM-120-X1-XXX-D:SFM-120-X1-XXX-D: 0.05"X0.05" SOCKET STRIP DOUBLE ROW ASSEMBLY. MANUFACTURER: SAMTEC.
CM1.1-CM1.3 CM2.1-CM2.3 CM3.1-CM3.3 CM4.1-CM4.3 CM5.1-CM5.3 CM6.1-CM6.3 CM7.1-CM7.3 CM8.1-CM8.3 CM9.1-CM9.3 CM10.1-CM10.3 CM11.1-CM11.3 CM12.1-CM12.3 CM13.1-CM13.3 CM14.1-CM14.3 CM15.1-CM15.3 CM16.1-CM16.3 CM17.1-CM17.3 CM18.1-CM18.3 CM19.1-CM19.3 CM20.1-CM20.3 = J-Molex-SMPM-73300-011x:J-MOLEX-SMPM-73300-0111X